# EAGLE schematic 8BIT_ADD_SUB (EAGLE 6.5.0), part 1 of 2

## Sheet 1 of 25
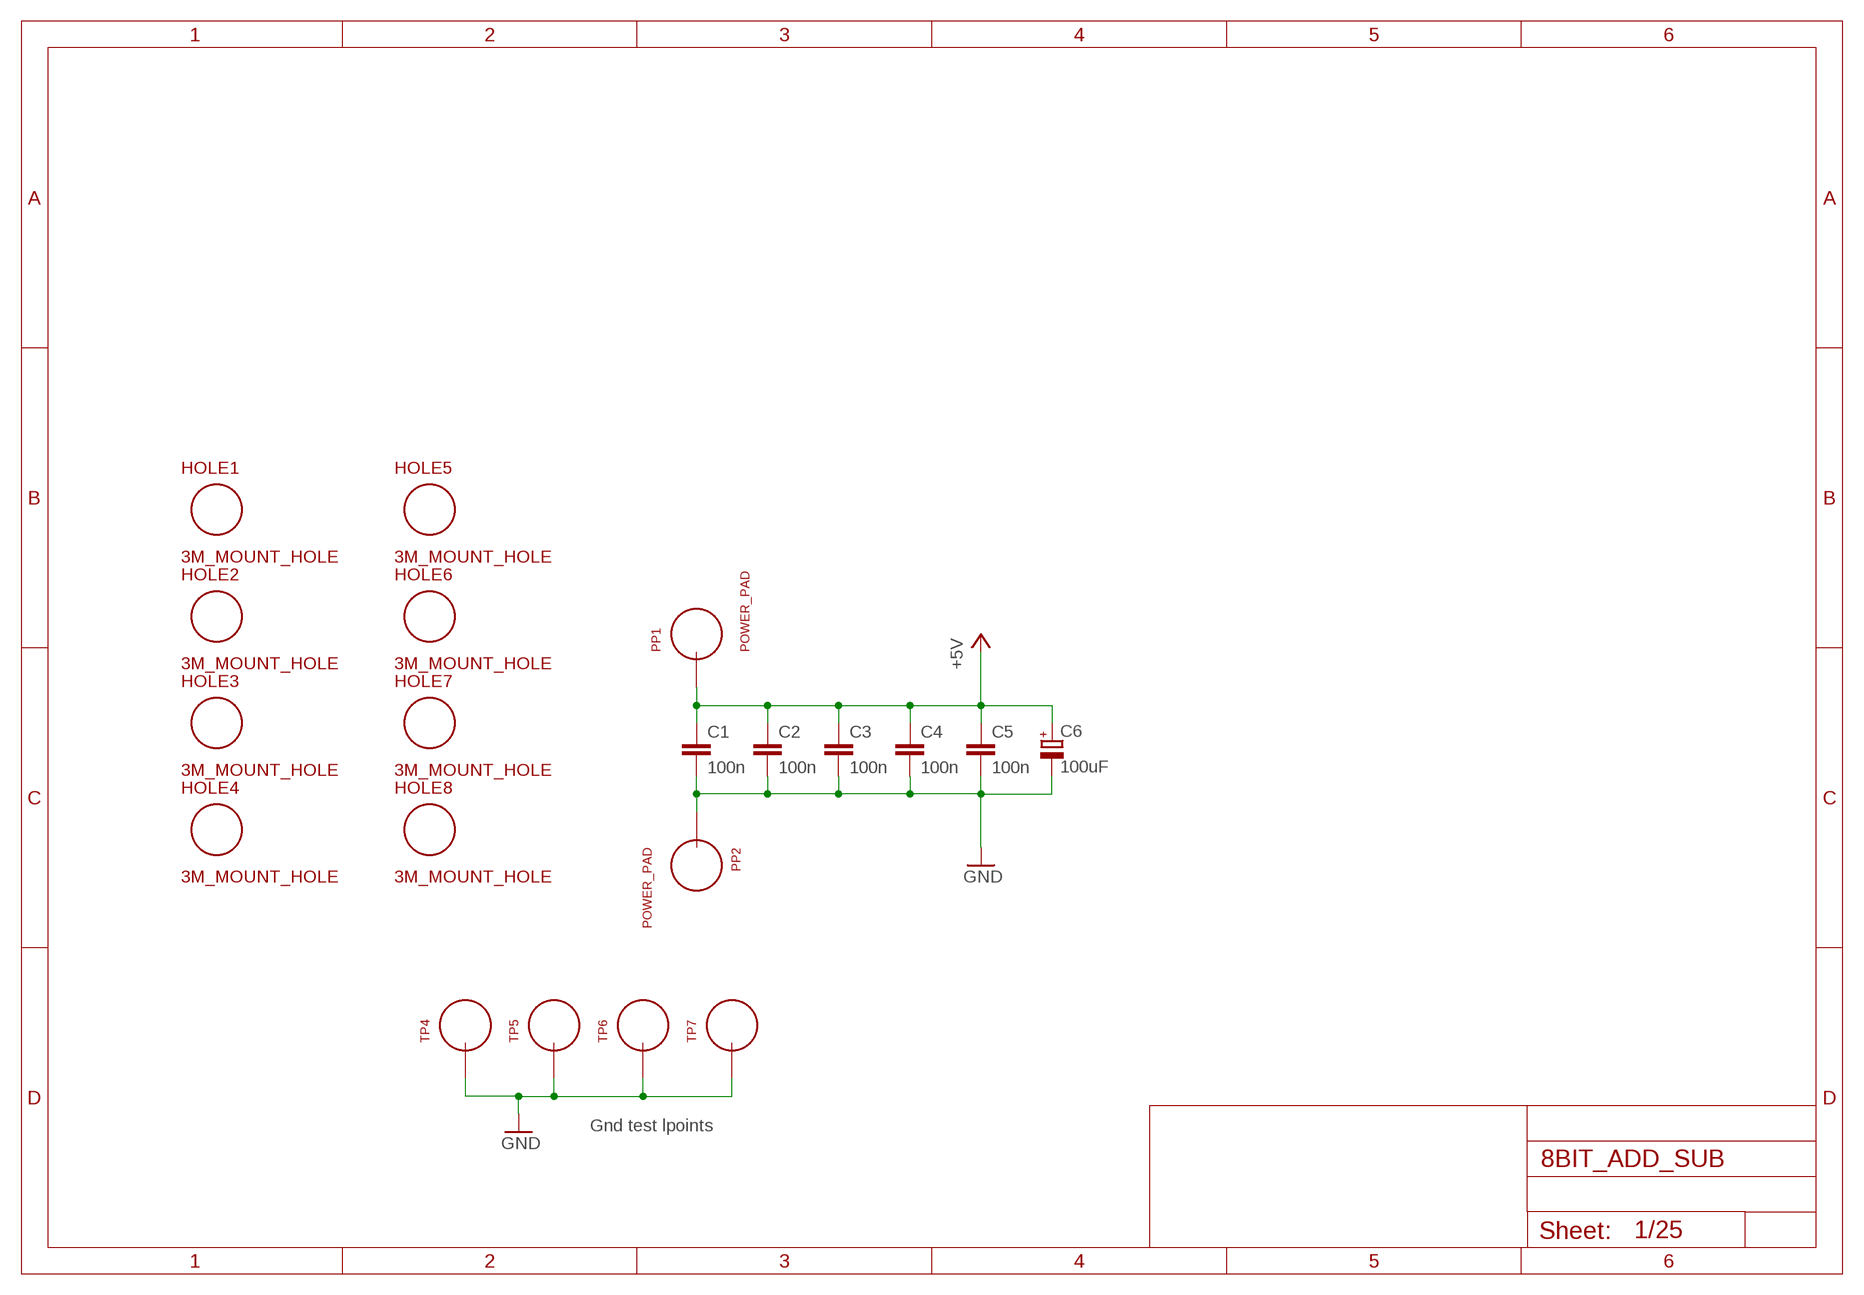
[diagram p0: schematic, sheet 1]

### Parts
C1  100n  C_P2INCH  [CAP_P2INCH]
C2  100n  C_P2INCH  [CAP_P2INCH]
C3  100n  C_P2INCH  [CAP_P2INCH]
C4  100n  C_P2INCH  [CAP_P2INCH]
C5  100n  C_P2INCH  [CAP_P2INCH]
C6  100uF  POLARISED_CAP_2P5  [POLARISED_CAP_2P5]
HOLE1  3M_MOUNT_HOLE  [3M_HOLE]
HOLE2  3M_MOUNT_HOLE  [3M_HOLE]
HOLE3  3M_MOUNT_HOLE  [3M_HOLE]
HOLE4  3M_MOUNT_HOLE  [3M_HOLE]
HOLE5  3M_MOUNT_HOLE  [3M_HOLE]
HOLE6  3M_MOUNT_HOLE  [3M_HOLE]
HOLE7  3M_MOUNT_HOLE  [3M_HOLE]
HOLE8  3M_MOUNT_HOLE  [3M_HOLE]
PP1  POWER_PAD  [POWER_PAD]
PP2  POWER_PAD  [POWER_PAD]
TP4  TEST_LOOP  [TEST_LOOP]
TP5  TEST_LOOP  [TEST_LOOP]
TP6  TEST_LOOP  [TEST_LOOP]
TP7  TEST_LOOP  [TEST_LOOP]

### Nets
+5V: C1.1 C2.1 C3.1 C4.1 C5.1 C6.A PP1.1 ; also sheet 3,4,5,6,7,8,9,10,11,12,13,14,15,16,17,18,19,20,21,22,23,24
GND: C1.2 C2.2 C3.2 C4.2 C5.2 C6.K PP2.1 TP4.P$1 TP5.P$1 TP6.P$1 TP7.P$1 ; also sheet 2,3,4,5,6,7,8,9,10,11,12,13,14,15,16,17,18,19,20,21,22,23,24,25

### Notes on the sheet
- Gnd test lpoints

## Sheet 2 of 25
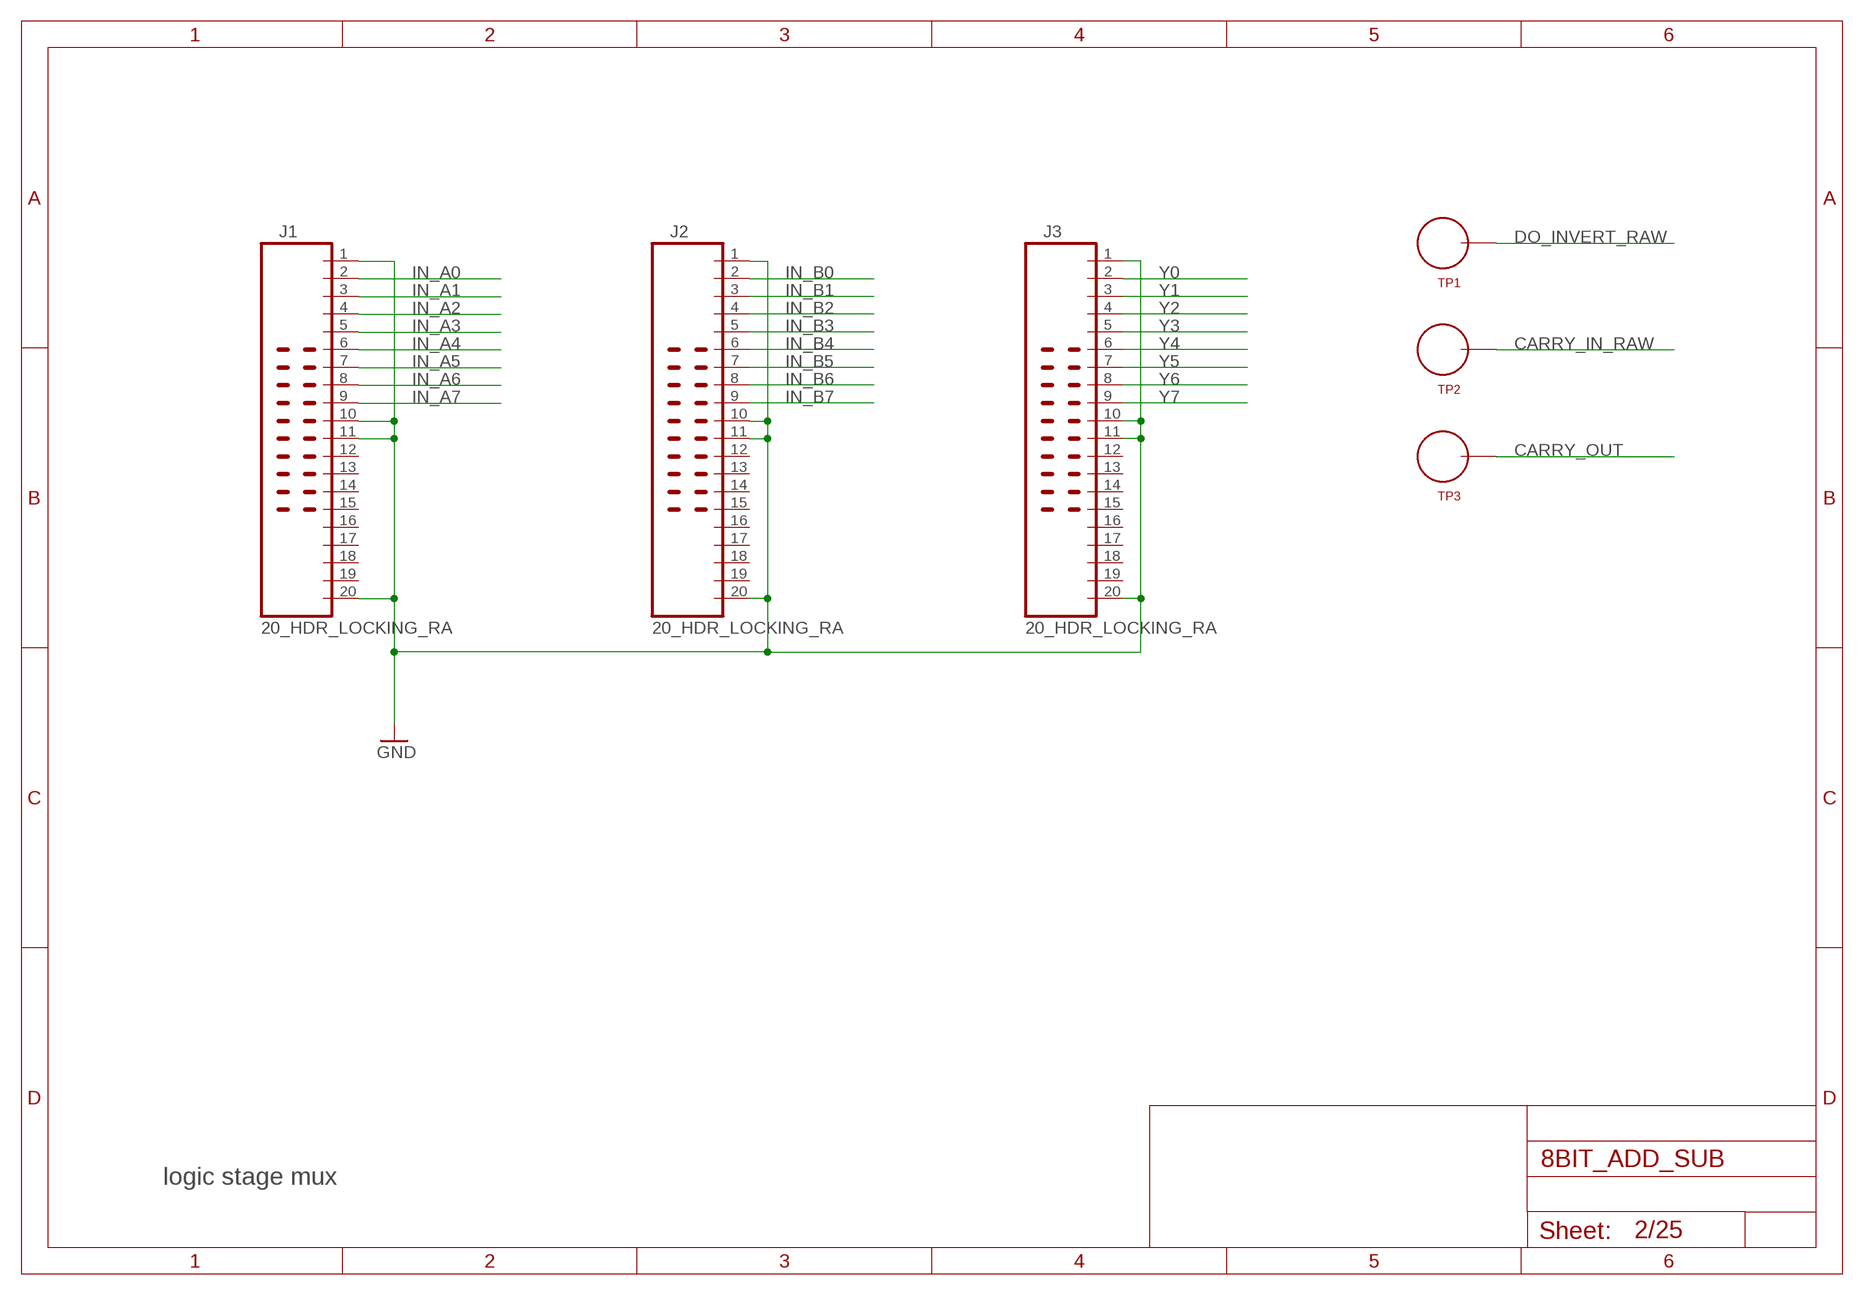
[diagram p1: schematic, sheet 2]

### Parts
J1  20_HDR_LOCKING_RA  [20_HDR_LOCKING_RA]
J2  20_HDR_LOCKING_RA  [20_HDR_LOCKING_RA]
J3  20_HDR_LOCKING_RA  [20_HDR_LOCKING_RA]
TP1  TEST_LOOP  [TEST_LOOP]
TP2  TEST_LOOP  [TEST_LOOP]
TP3  TEST_LOOP  [TEST_LOOP]

### Nets
CARRY_IN_RAW: TP2.P$1 ; also sheet 24
CARRY_OUT: TP3.P$1 ; also sheet 23,24
DO_INVERT_RAW: TP1.P$1 ; also sheet 24
GND: J1.1 J1.10 J1.11 J1.20 J2.1 J2.10 J2.11 J2.20 J3.1 J3.10 J3.11 J3.20 ; also sheet 1,3,4,5,6,7,8,9,10,11,12,13,14,15,16,17,18,19,20,21,22,23,24,25
IN_A0: J1.2 ; also sheet 3,8,9,25
IN_A1: J1.3 ; also sheet 3,10,11,25
IN_A2: J1.4 ; also sheet 3,12,13,25
IN_A3: J1.5 ; also sheet 3,14,15,25
IN_A4: J1.6 ; also sheet 3,16,17,25
IN_A5: J1.7 ; also sheet 3,18,19,25
IN_A6: J1.8 ; also sheet 3,20,21,25
IN_A7: J1.9 ; also sheet 3,22,23,25
IN_B0: J2.2 ; also sheet 3,4,25
IN_B1: J2.3 ; also sheet 3,4,25
IN_B2: J2.4 ; also sheet 3,5,25
IN_B3: J2.5 ; also sheet 3,5,25
IN_B4: J2.6 ; also sheet 3,6,25
IN_B5: J2.7 ; also sheet 3,6,25
IN_B6: J2.8 ; also sheet 3,7,25
IN_B7: J2.9 ; also sheet 3,7,25
Y0: J3.2 ; also sheet 8,25
Y1: J3.3 ; also sheet 10,25
Y2: J3.4 ; also sheet 12,25
Y3: J3.5 ; also sheet 14,25
Y4: J3.6 ; also sheet 16,25
Y5: J3.7 ; also sheet 18,25
Y6: J3.8 ; also sheet 20,25
Y7: J3.9 ; also sheet 22,25
Unconnected: J1.12 J1.13 J1.14 J1.15 J1.16 J1.17 J1.18 J1.19 J2.12 J2.13 J2.14 J2.15 J2.16 J2.17 J2.18 J2.19 J3.12 J3.13 J3.14 J3.15 J3.16 J3.17 J3.18 J3.19

### Notes on the sheet
- logic stage mux

## Sheet 3 of 25
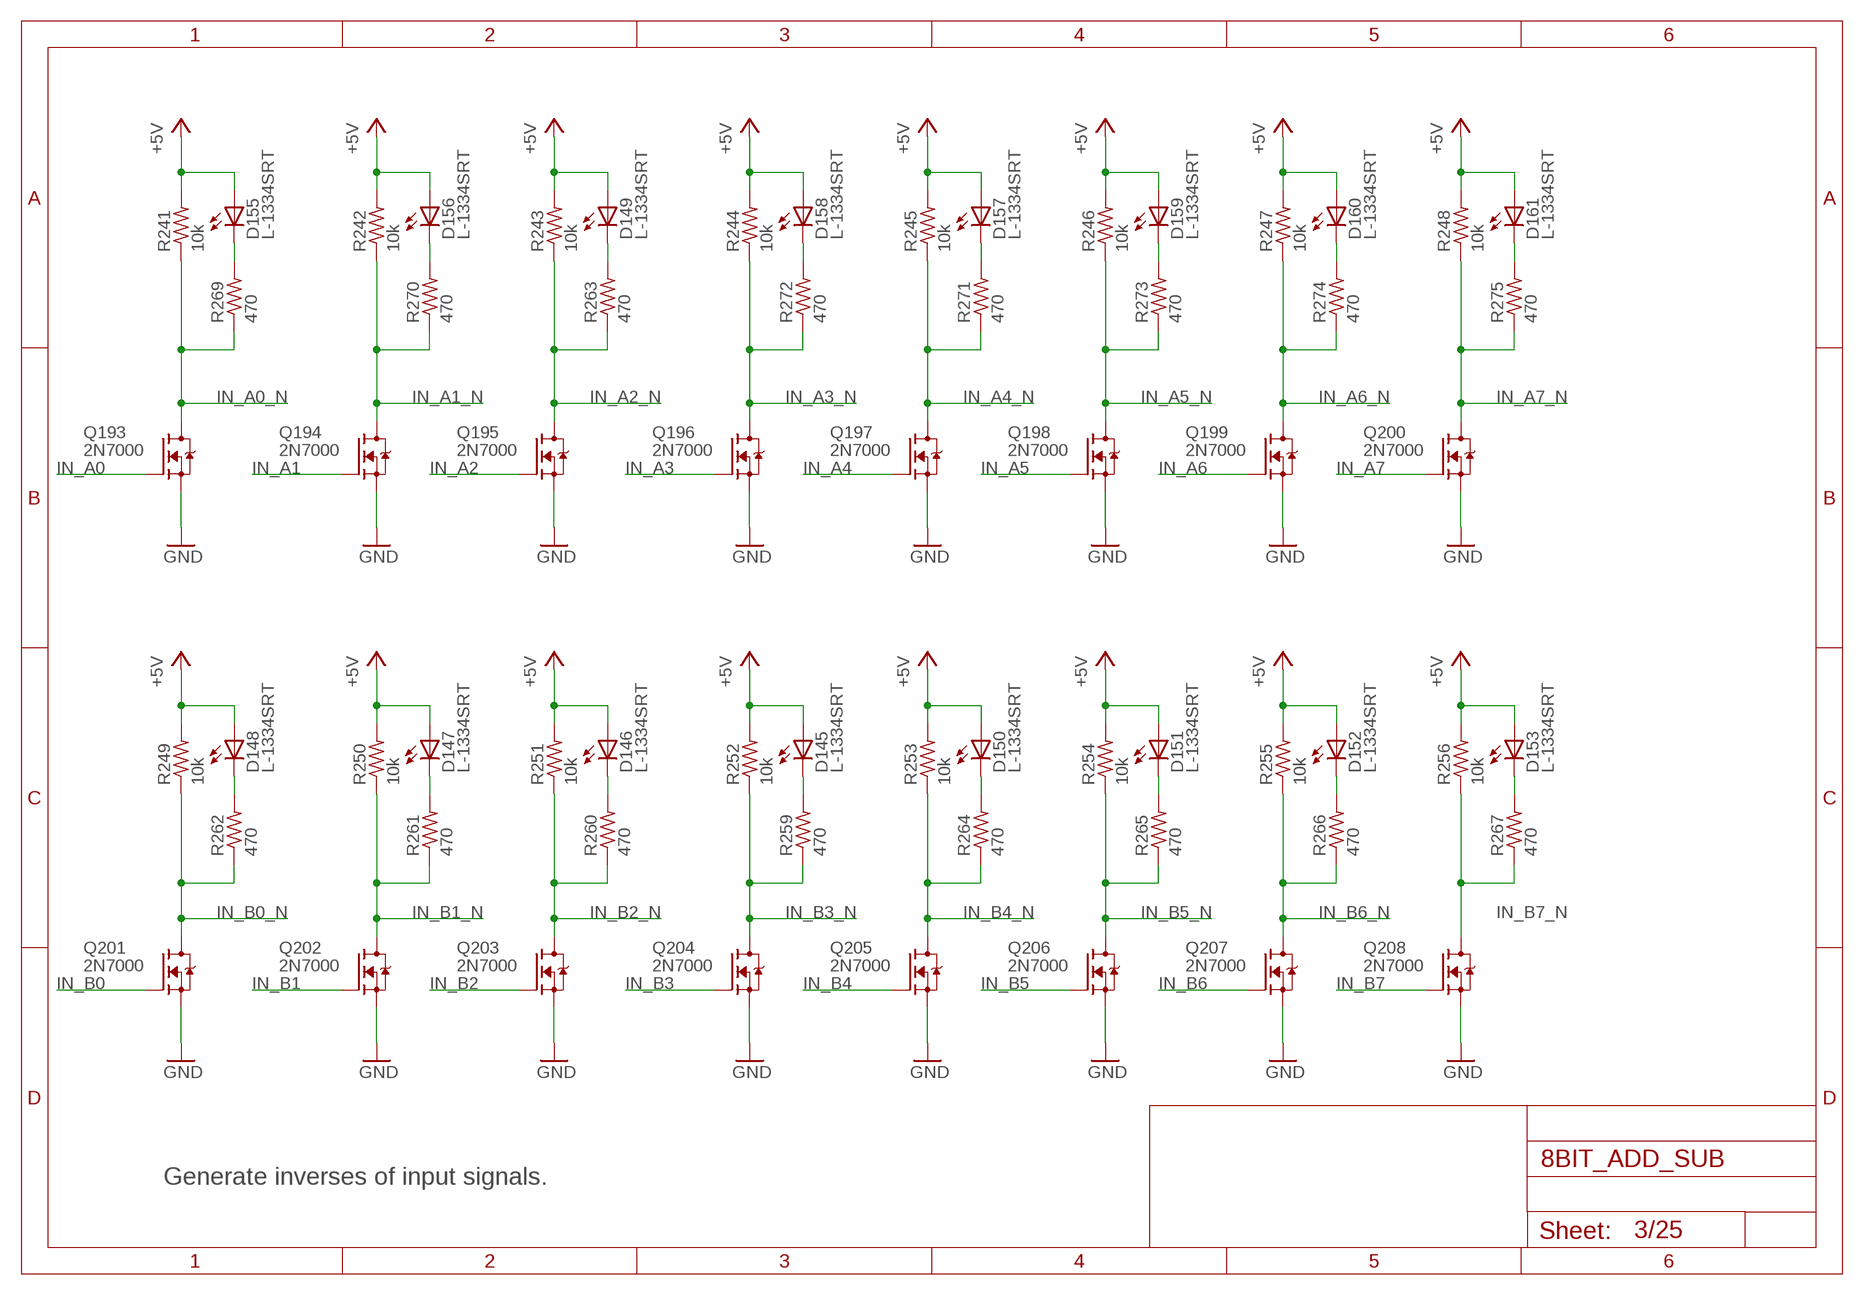
[diagram p2: schematic, sheet 3]

### Parts
D145  L-1334SRT  [LED3MM]
D146  L-1334SRT  [LED3MM]
D147  L-1334SRT  [LED3MM]
D148  L-1334SRT  [LED3MM]
D149  L-1334SRT  [LED3MM]
D150  L-1334SRT  [LED3MM]
D151  L-1334SRT  [LED3MM]
D152  L-1334SRT  [LED3MM]
D153  L-1334SRT  [LED3MM]
D155  L-1334SRT  [LED3MM]
D156  L-1334SRT  [LED3MM]
D157  L-1334SRT  [LED3MM]
D158  L-1334SRT  [LED3MM]
D159  L-1334SRT  [LED3MM]
D160  L-1334SRT  [LED3MM]
D161  L-1334SRT  [LED3MM]
Q193  2N7000  [TO92-DGS]
Q194  2N7000  [TO92-DGS]
Q195  2N7000  [TO92-DGS]
Q196  2N7000  [TO92-DGS]
Q197  2N7000  [TO92-DGS]
Q198  2N7000  [TO92-DGS]
Q199  2N7000  [TO92-DGS]
Q200  2N7000  [TO92-DGS]
Q201  2N7000  [TO92-DGS]
Q202  2N7000  [TO92-DGS]
Q203  2N7000  [TO92-DGS]
Q204  2N7000  [TO92-DGS]
Q205  2N7000  [TO92-DGS]
Q206  2N7000  [TO92-DGS]
Q207  2N7000  [TO92-DGS]
Q208  2N7000  [TO92-DGS]
R241  10k  R_P2INCH  [R_P2INCH]
R242  10k  R_P2INCH  [R_P2INCH]
R243  10k  R_P2INCH  [R_P2INCH]
R244  10k  R_P2INCH  [R_P2INCH]
R245  10k  R_P2INCH  [R_P2INCH]
R246  10k  R_P2INCH  [R_P2INCH]
R247  10k  R_P2INCH  [R_P2INCH]
R248  10k  R_P2INCH  [R_P2INCH]
R249  10k  R_P2INCH  [R_P2INCH]
R250  10k  R_P2INCH  [R_P2INCH]
R251  10k  R_P2INCH  [R_P2INCH]
R252  10k  R_P2INCH  [R_P2INCH]
R253  10k  R_P2INCH  [R_P2INCH]
R254  10k  R_P2INCH  [R_P2INCH]
R255  10k  R_P2INCH  [R_P2INCH]
R256  10k  R_P2INCH  [R_P2INCH]
R259  470  R_P2INCH  [R_P2INCH]
R260  470  R_P2INCH  [R_P2INCH]
R261  470  R_P2INCH  [R_P2INCH]
R262  470  R_P2INCH  [R_P2INCH]
R263  470  R_P2INCH  [R_P2INCH]
R264  470  R_P2INCH  [R_P2INCH]
R265  470  R_P2INCH  [R_P2INCH]
R266  470  R_P2INCH  [R_P2INCH]
R267  470  R_P2INCH  [R_P2INCH]
R269  470  R_P2INCH  [R_P2INCH]
R270  470  R_P2INCH  [R_P2INCH]
R271  470  R_P2INCH  [R_P2INCH]
R272  470  R_P2INCH  [R_P2INCH]
R273  470  R_P2INCH  [R_P2INCH]
R274  470  R_P2INCH  [R_P2INCH]
R275  470  R_P2INCH  [R_P2INCH]

### Nets
+5V: D145.A D146.A D147.A D148.A D149.A D150.A D151.A D152.A D153.A D155.A D156.A D157.A D158.A D159.A D160.A D161.A R241.2 R242.2 R243.2 R244.2 R245.2 R246.2 R247.2 R248.2 R249.2 R250.2 R251.2 R252.2 R253.2 R254.2 R255.2 R256.2 ; also sheet 1,4,5,6,7,8,9,10,11,12,13,14,15,16,17,18,19,20,21,22,23,24
GND: Q193.S Q194.S Q195.S Q196.S Q197.S Q198.S Q199.S Q200.S Q201.S Q202.S Q203.S Q204.S Q205.S Q206.S Q207.S Q208.S ; also sheet 1,2,4,5,6,7,8,9,10,11,12,13,14,15,16,17,18,19,20,21,22,23,24,25
IN_A0: Q193.G ; also sheet 2,8,9,25
IN_A0_N: Q193.D R241.1 R269.1 ; also sheet 8,9
IN_A1: Q194.G ; also sheet 2,10,11,25
IN_A1_N: Q194.D R242.1 R270.1 ; also sheet 10,11
IN_A2: Q195.G ; also sheet 2,12,13,25
IN_A2_N: Q195.D R243.1 R263.1 ; also sheet 12,13
IN_A3: Q196.G ; also sheet 2,14,15,25
IN_A3_N: Q196.D R244.1 R272.1 ; also sheet 14,15
IN_A4: Q197.G ; also sheet 2,16,17,25
IN_A4_N: Q197.D R245.1 R271.1 ; also sheet 16,17
IN_A5: Q198.G ; also sheet 2,18,19,25
IN_A5_N: Q198.D R246.1 R273.1 ; also sheet 18,19
IN_A6: Q199.G ; also sheet 2,20,21,25
IN_A6_N: Q199.D R247.1 R274.1 ; also sheet 20,21
IN_A7: Q200.G ; also sheet 2,22,23,25
IN_A7_N: Q200.D R248.1 R275.1 ; also sheet 22,23
IN_B0: Q201.G ; also sheet 2,4,25
IN_B0_N: Q201.D R249.1 R262.1 ; also sheet 4
IN_B1: Q202.G ; also sheet 2,4,25
IN_B1_N: Q202.D R250.1 R261.1 ; also sheet 4
IN_B2: Q203.G ; also sheet 2,5,25
IN_B2_N: Q203.D R251.1 R260.1 ; also sheet 5
IN_B3: Q204.G ; also sheet 2,5,25
IN_B3_N: Q204.D R252.1 R259.1 ; also sheet 5
IN_B4: Q205.G ; also sheet 2,6,25
IN_B4_N: Q205.D R253.1 R264.1 ; also sheet 6
IN_B5: Q206.G ; also sheet 2,6,25
IN_B5_N: Q206.D R254.1 R265.1 ; also sheet 6
IN_B6: Q207.G ; also sheet 2,7,25
IN_B6_N: Q207.D R255.1 R266.1 ; also sheet 7
IN_B7: Q208.G ; also sheet 2,7,25
IN_B7_N: Q208.D R256.1 R267.1 ; also sheet 7
N$240: D145.K(C) R259.2
N$241: D146.K(C) R260.2
N$242: D147.K(C) R261.2
N$243: D148.K(C) R262.2
N$244: D149.K(C) R263.2
N$245: D150.K(C) R264.2
N$246: D151.K(C) R265.2
N$247: D152.K(C) R266.2
N$248: D153.K(C) R267.2
N$250: D155.K(C) R269.2
N$251: D156.K(C) R270.2
N$252: D157.K(C) R271.2
N$253: D158.K(C) R272.2
N$254: D159.K(C) R273.2
N$255: D160.K(C) R274.2
N$256: D161.K(C) R275.2

### Notes on the sheet
- Generate inverses of input signals.

## Sheet 4 of 25
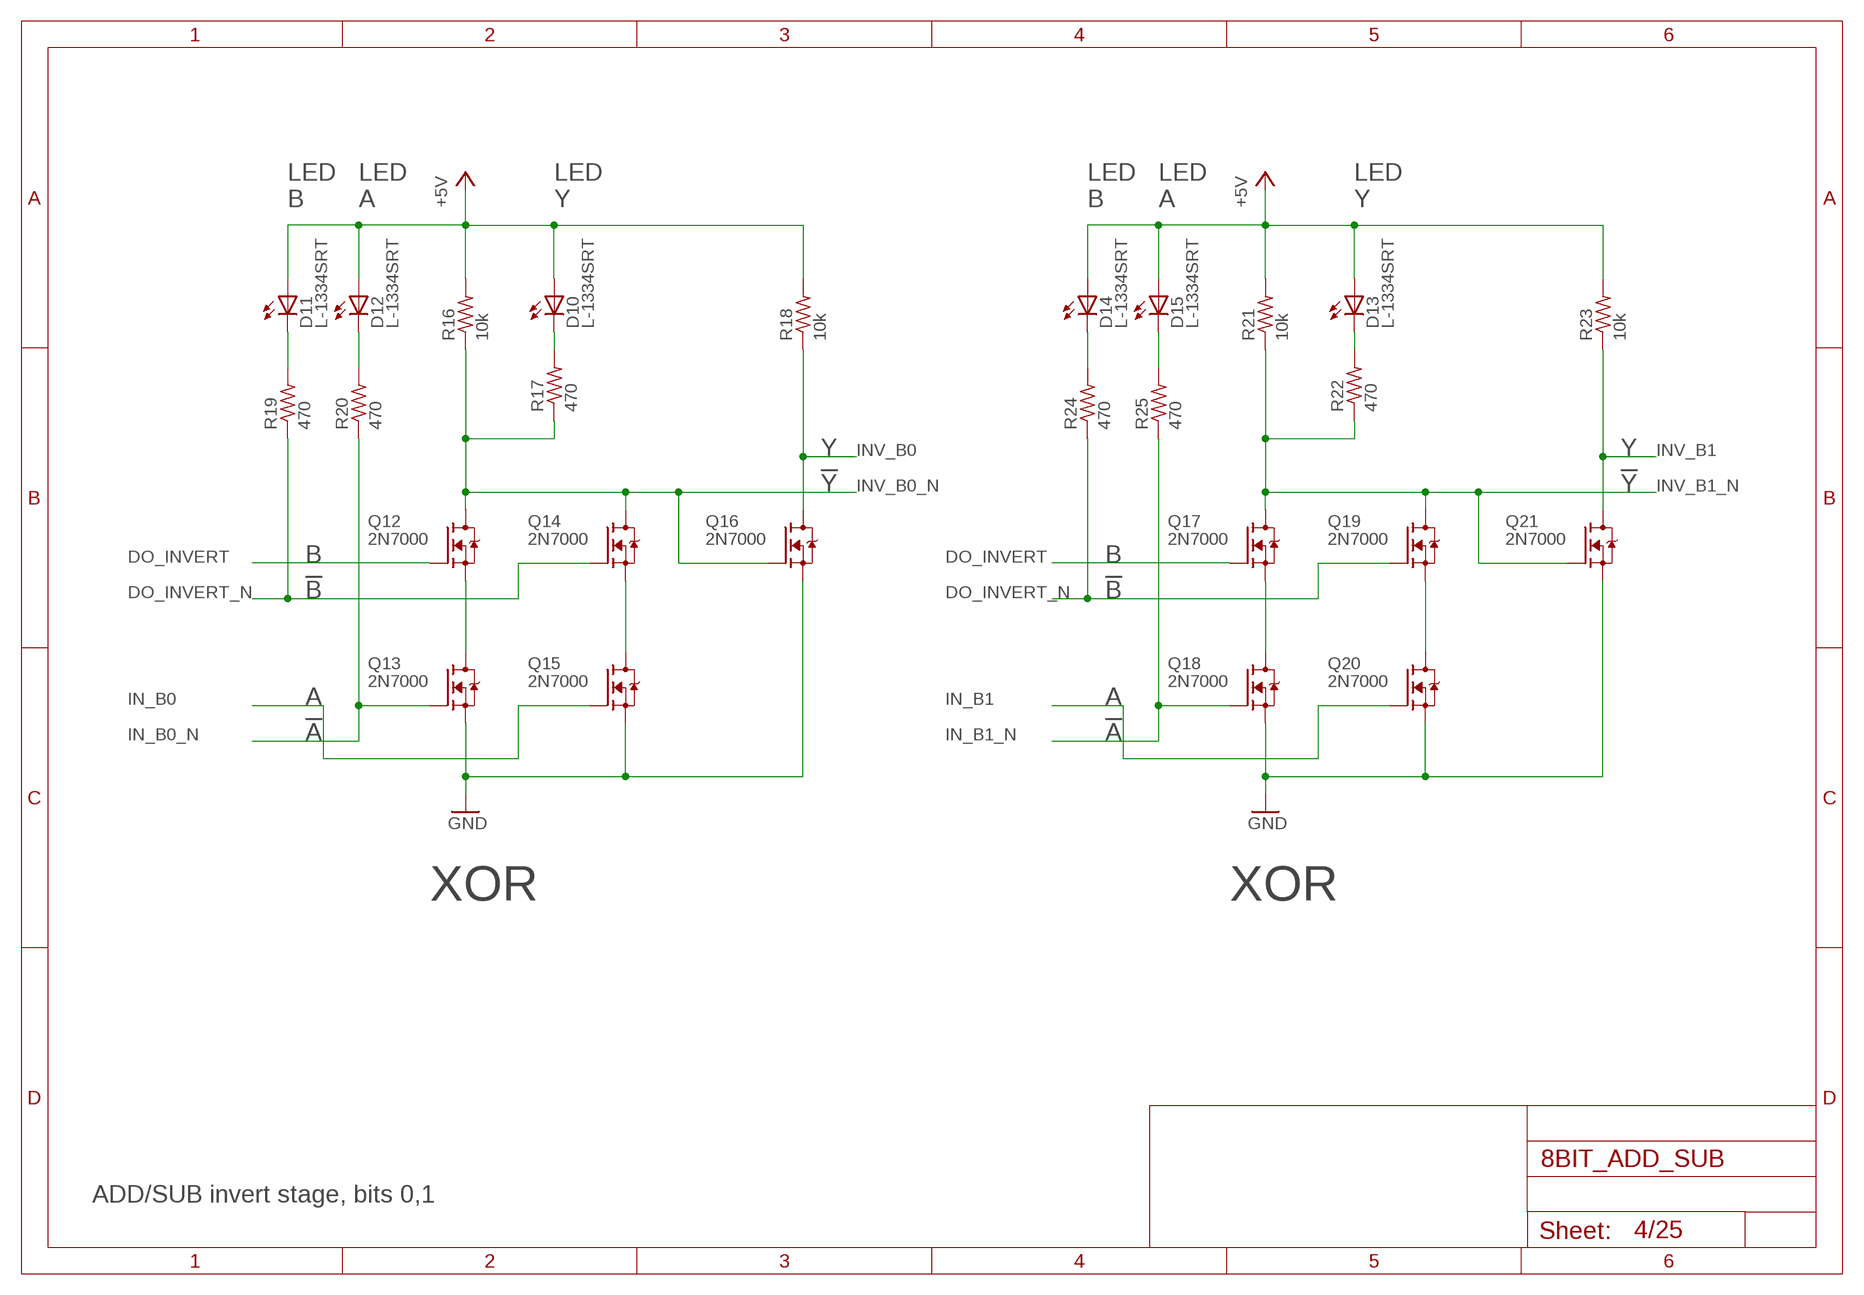
[diagram p3: schematic, sheet 4]

### Parts
D10  L-1334SRT  [LED3MM]
D11  L-1334SRT  [LED3MM]
D12  L-1334SRT  [LED3MM]
D13  L-1334SRT  [LED3MM]
D14  L-1334SRT  [LED3MM]
D15  L-1334SRT  [LED3MM]
Q12  2N7000  [TO92-DGS]
Q13  2N7000  [TO92-DGS]
Q14  2N7000  [TO92-DGS]
Q15  2N7000  [TO92-DGS]
Q16  2N7000  [TO92-DGS]
Q17  2N7000  [TO92-DGS]
Q18  2N7000  [TO92-DGS]
Q19  2N7000  [TO92-DGS]
Q20  2N7000  [TO92-DGS]
Q21  2N7000  [TO92-DGS]
R16  10k  R_P2INCH  [R_P2INCH]
R17  470  R_P2INCH  [R_P2INCH]
R18  10k  R_P2INCH  [R_P2INCH]
R19  470  R_P2INCH  [R_P2INCH]
R20  470  R_P2INCH  [R_P2INCH]
R21  10k  R_P2INCH  [R_P2INCH]
R22  470  R_P2INCH  [R_P2INCH]
R23  10k  R_P2INCH  [R_P2INCH]
R24  470  R_P2INCH  [R_P2INCH]
R25  470  R_P2INCH  [R_P2INCH]

### Nets
+5V: D10.A D11.A D12.A D13.A D14.A D15.A R16.2 R18.2 R21.2 R23.2 ; also sheet 1,3,5,6,7,8,9,10,11,12,13,14,15,16,17,18,19,20,21,22,23,24
DO_INVERT: Q12.G Q17.G ; also sheet 5,6,7,24
DO_INVERT_N: Q14.G Q19.G R19.1 R24.1 ; also sheet 5,6,7,24
GND: Q13.S Q15.S Q16.S Q18.S Q20.S Q21.S ; also sheet 1,2,3,5,6,7,8,9,10,11,12,13,14,15,16,17,18,19,20,21,22,23,24,25
IN_B0: Q15.G ; also sheet 2,3,25
IN_B0_N: Q13.G R20.1 ; also sheet 3
IN_B1: Q20.G ; also sheet 2,3,25
IN_B1_N: Q18.G R25.1 ; also sheet 3
INV_B0: Q16.D R18.1 ; also sheet 8,9
INV_B0_N: Q12.D Q14.D Q16.G R16.1 R17.1 ; also sheet 8,9
INV_B1: Q21.D R23.1 ; also sheet 10,11
INV_B1_N: Q17.D Q19.D Q21.G R21.1 R22.1 ; also sheet 10,11
N$16: Q12.S Q13.D
N$32: Q14.S Q15.D
N$36: D10.K(C) R17.2
N$39: D12.K(C) R20.2
N$40: D11.K(C) R19.2
N$42: Q17.S Q18.D
N$43: Q19.S Q20.D
N$47: D13.K(C) R22.2
N$50: D15.K(C) R25.2
N$51: D14.K(C) R24.2

### Notes on the sheet
- LED
  B
- LED
  A
- LED
  Y
- LED
  B
- LED
  A
- LED
  Y
- Y | Y
- !Y | !Y
- B | B
- !B | !B
- A | A
- !A | !A
- XOR | XOR
- ADD/SUB invert stage, bits 0,1

## Sheet 5 of 25
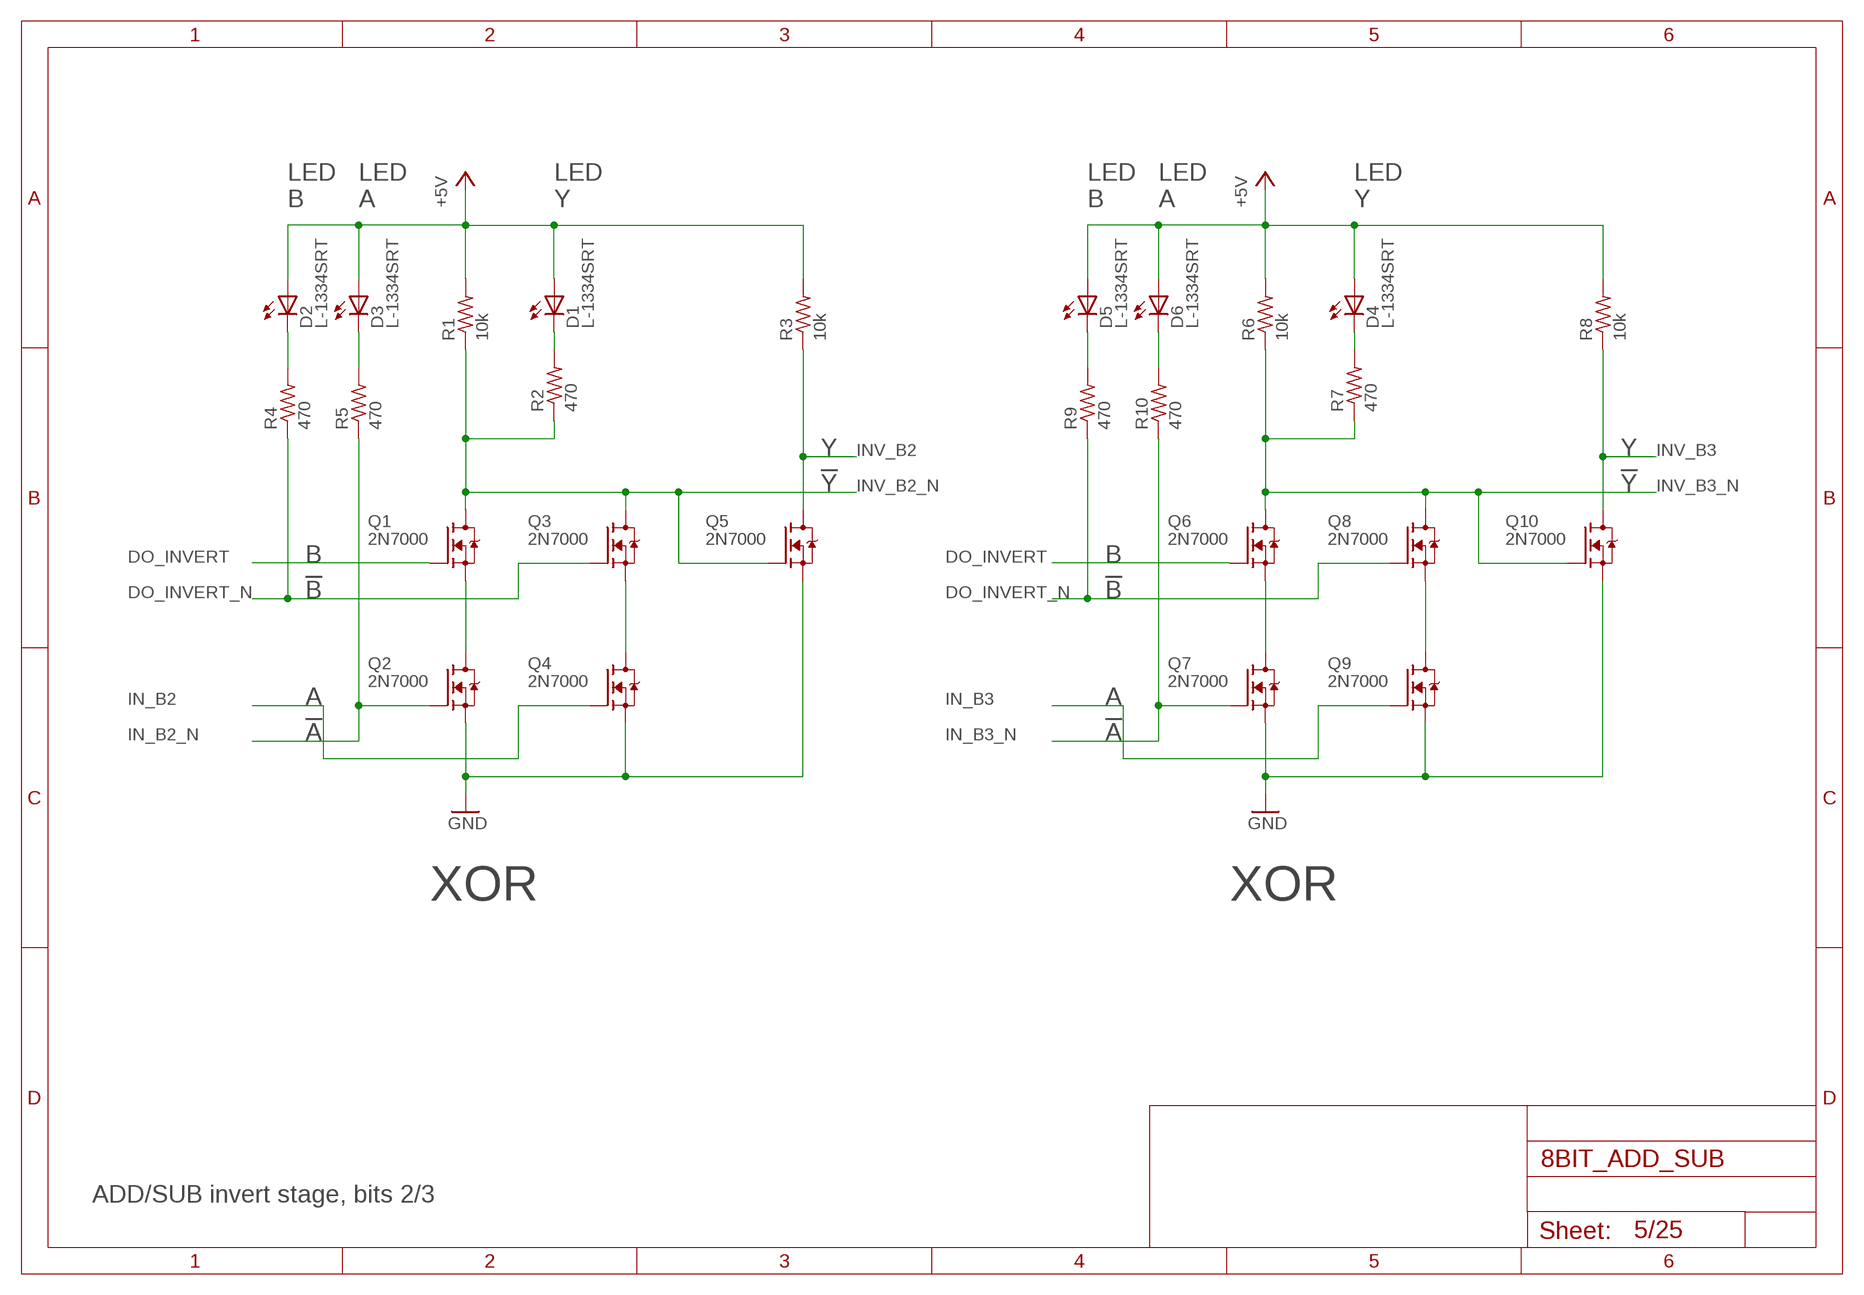
[diagram p4: schematic, sheet 5]

### Parts
D1  L-1334SRT  [LED3MM]
D2  L-1334SRT  [LED3MM]
D3  L-1334SRT  [LED3MM]
D4  L-1334SRT  [LED3MM]
D5  L-1334SRT  [LED3MM]
D6  L-1334SRT  [LED3MM]
Q1  2N7000  [TO92-DGS]
Q2  2N7000  [TO92-DGS]
Q3  2N7000  [TO92-DGS]
Q4  2N7000  [TO92-DGS]
Q5  2N7000  [TO92-DGS]
Q6  2N7000  [TO92-DGS]
Q7  2N7000  [TO92-DGS]
Q8  2N7000  [TO92-DGS]
Q9  2N7000  [TO92-DGS]
Q10  2N7000  [TO92-DGS]
R1  10k  R_P2INCH  [R_P2INCH]
R2  470  R_P2INCH  [R_P2INCH]
R3  10k  R_P2INCH  [R_P2INCH]
R4  470  R_P2INCH  [R_P2INCH]
R5  470  R_P2INCH  [R_P2INCH]
R6  10k  R_P2INCH  [R_P2INCH]
R7  470  R_P2INCH  [R_P2INCH]
R8  10k  R_P2INCH  [R_P2INCH]
R9  470  R_P2INCH  [R_P2INCH]
R10  470  R_P2INCH  [R_P2INCH]

### Nets
+5V: D1.A D2.A D3.A D4.A D5.A D6.A R1.2 R3.2 R6.2 R8.2 ; also sheet 1,3,4,6,7,8,9,10,11,12,13,14,15,16,17,18,19,20,21,22,23,24
DO_INVERT: Q1.G Q6.G ; also sheet 4,6,7,24
DO_INVERT_N: Q3.G Q8.G R4.1 R9.1 ; also sheet 4,6,7,24
GND: Q2.S Q4.S Q5.S Q7.S Q9.S Q10.S ; also sheet 1,2,3,4,6,7,8,9,10,11,12,13,14,15,16,17,18,19,20,21,22,23,24,25
IN_B2: Q4.G ; also sheet 2,3,25
IN_B2_N: Q2.G R5.1 ; also sheet 3
IN_B3: Q9.G ; also sheet 2,3,25
IN_B3_N: Q7.G R10.1 ; also sheet 3
INV_B2: Q5.D R3.1 ; also sheet 12,13
INV_B2_N: Q1.D Q3.D Q5.G R1.1 R2.1 ; also sheet 12,13
INV_B3: Q10.D R8.1 ; also sheet 14,15
INV_B3_N: Q6.D Q8.D Q10.G R6.1 R7.1 ; also sheet 14,15
N$1: Q1.S Q2.D
N$2: Q3.S Q4.D
N$3: D1.K(C) R2.2
N$4: D3.K(C) R5.2
N$5: D2.K(C) R4.2
N$6: Q6.S Q7.D
N$7: Q8.S Q9.D
N$8: D4.K(C) R7.2
N$9: D6.K(C) R10.2
N$10: D5.K(C) R9.2

### Notes on the sheet
- LED
  B
- LED
  A
- LED
  Y
- LED
  B
- LED
  A
- LED
  Y
- Y | Y
- !Y | !Y
- B | B
- !B | !B
- A | A
- !A | !A
- XOR | XOR
- ADD/SUB invert stage, bits 2/3

## Sheet 6 of 25
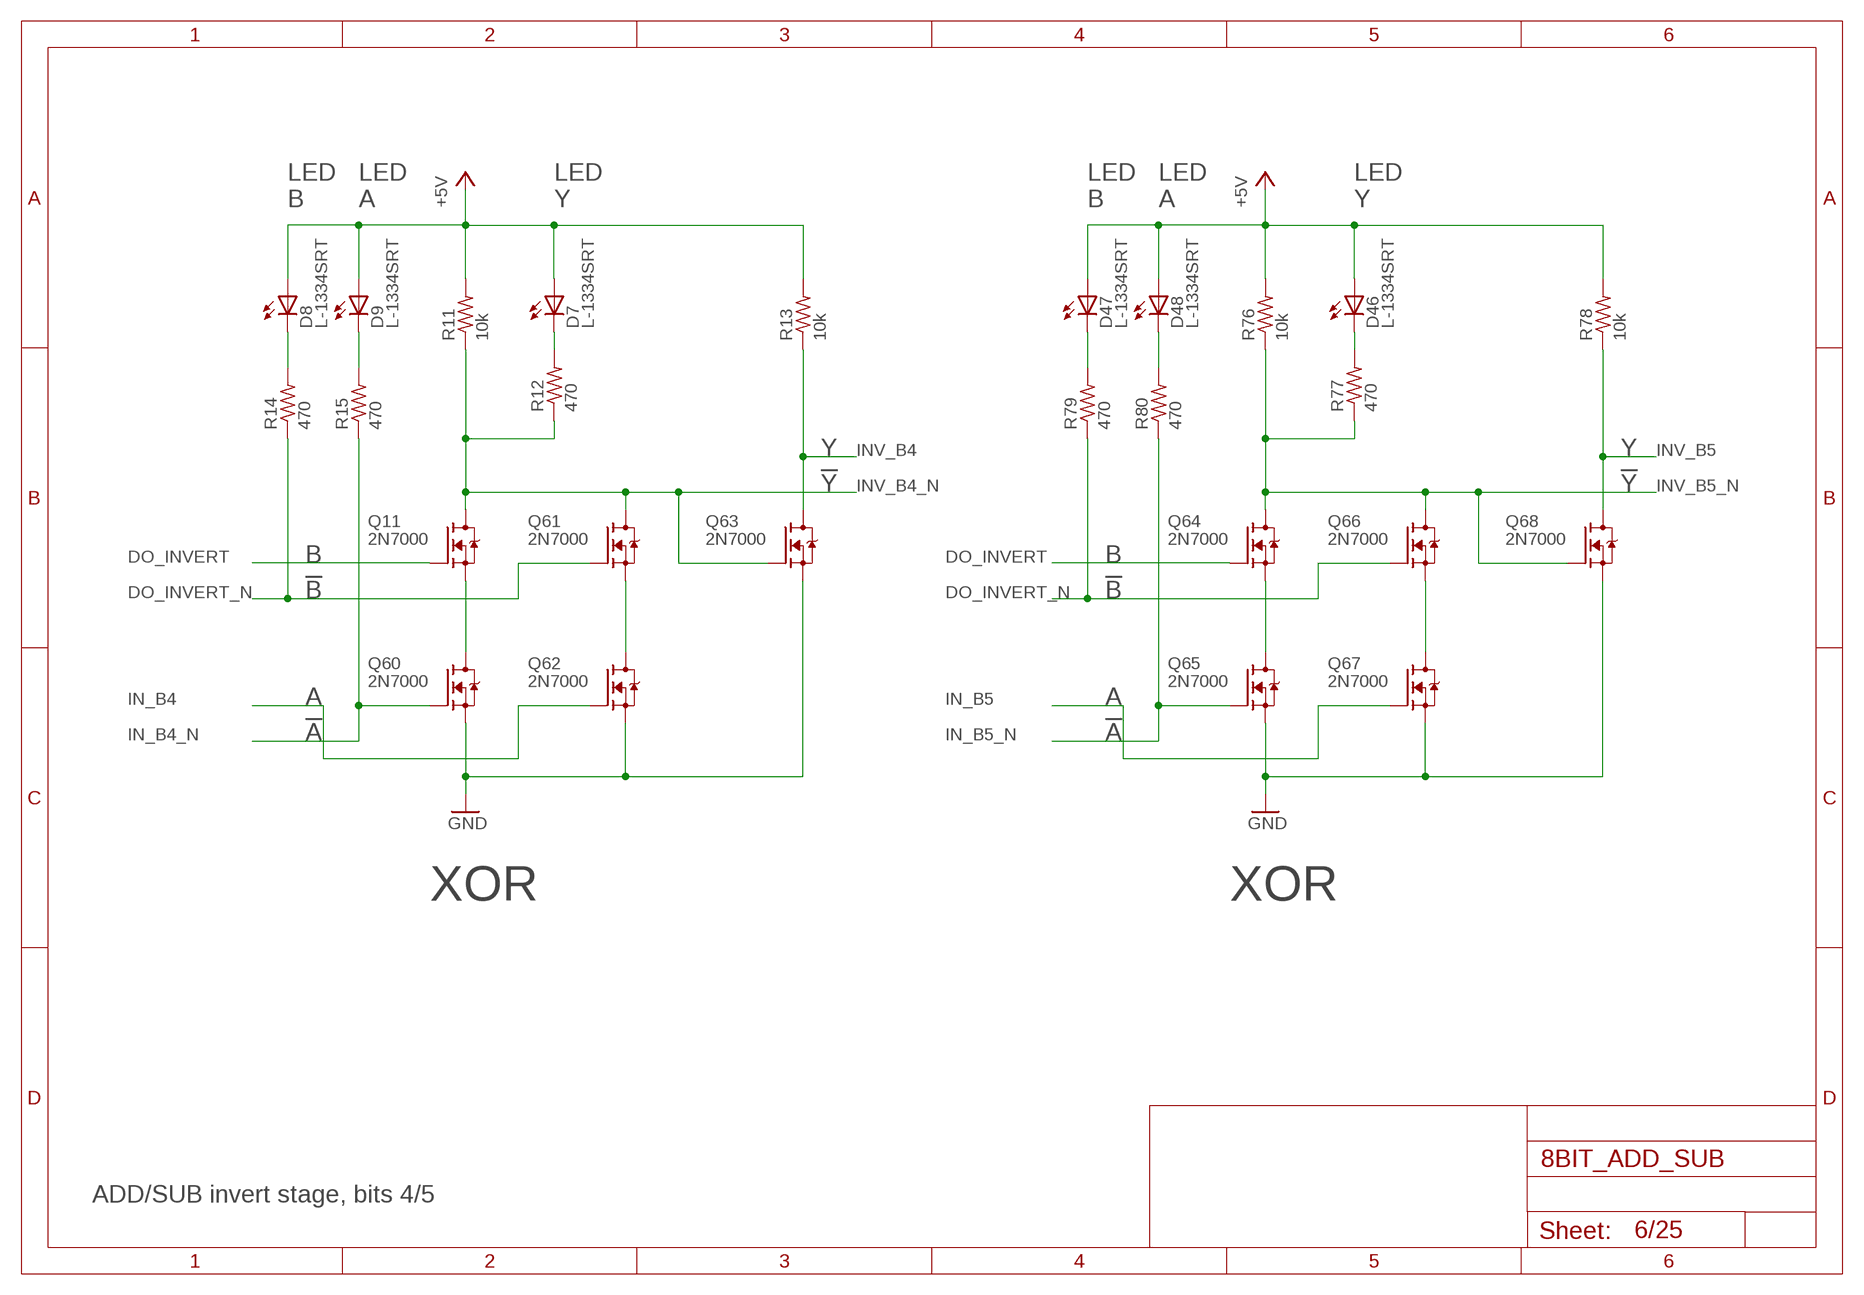
[diagram p5: schematic, sheet 6]

### Parts
D7  L-1334SRT  [LED3MM]
D8  L-1334SRT  [LED3MM]
D9  L-1334SRT  [LED3MM]
D46  L-1334SRT  [LED3MM]
D47  L-1334SRT  [LED3MM]
D48  L-1334SRT  [LED3MM]
Q11  2N7000  [TO92-DGS]
Q60  2N7000  [TO92-DGS]
Q61  2N7000  [TO92-DGS]
Q62  2N7000  [TO92-DGS]
Q63  2N7000  [TO92-DGS]
Q64  2N7000  [TO92-DGS]
Q65  2N7000  [TO92-DGS]
Q66  2N7000  [TO92-DGS]
Q67  2N7000  [TO92-DGS]
Q68  2N7000  [TO92-DGS]
R11  10k  R_P2INCH  [R_P2INCH]
R12  470  R_P2INCH  [R_P2INCH]
R13  10k  R_P2INCH  [R_P2INCH]
R14  470  R_P2INCH  [R_P2INCH]
R15  470  R_P2INCH  [R_P2INCH]
R76  10k  R_P2INCH  [R_P2INCH]
R77  470  R_P2INCH  [R_P2INCH]
R78  10k  R_P2INCH  [R_P2INCH]
R79  470  R_P2INCH  [R_P2INCH]
R80  470  R_P2INCH  [R_P2INCH]

### Nets
+5V: D7.A D8.A D9.A D46.A D47.A D48.A R11.2 R13.2 R76.2 R78.2 ; also sheet 1,3,4,5,7,8,9,10,11,12,13,14,15,16,17,18,19,20,21,22,23,24
DO_INVERT: Q11.G Q64.G ; also sheet 4,5,7,24
DO_INVERT_N: Q61.G Q66.G R14.1 R79.1 ; also sheet 4,5,7,24
GND: Q60.S Q62.S Q63.S Q65.S Q67.S Q68.S ; also sheet 1,2,3,4,5,7,8,9,10,11,12,13,14,15,16,17,18,19,20,21,22,23,24,25
IN_B4: Q62.G ; also sheet 2,3,25
IN_B4_N: Q60.G R15.1 ; also sheet 3
IN_B5: Q67.G ; also sheet 2,3,25
IN_B5_N: Q65.G R80.1 ; also sheet 3
INV_B4: Q63.D R13.1 ; also sheet 16,17
INV_B4_N: Q11.D Q61.D Q63.G R11.1 R12.1 ; also sheet 16,17
INV_B5: Q68.D R78.1 ; also sheet 18,19
INV_B5_N: Q64.D Q66.D Q68.G R76.1 R77.1 ; also sheet 18,19
N$11: Q11.S Q60.D
N$12: Q61.S Q62.D
N$13: D7.K(C) R12.2
N$14: D9.K(C) R15.2
N$15: D8.K(C) R14.2
N$17: Q64.S Q65.D
N$18: Q66.S Q67.D
N$19: D46.K(C) R77.2
N$20: D48.K(C) R80.2
N$21: D47.K(C) R79.2

### Notes on the sheet
- LED
  B
- LED
  A
- LED
  Y
- LED
  B
- LED
  A
- LED
  Y
- Y | Y
- !Y | !Y
- B | B
- !B | !B
- A | A
- !A | !A
- XOR | XOR
- ADD/SUB invert stage, bits 4/5

## Sheet 7 of 25
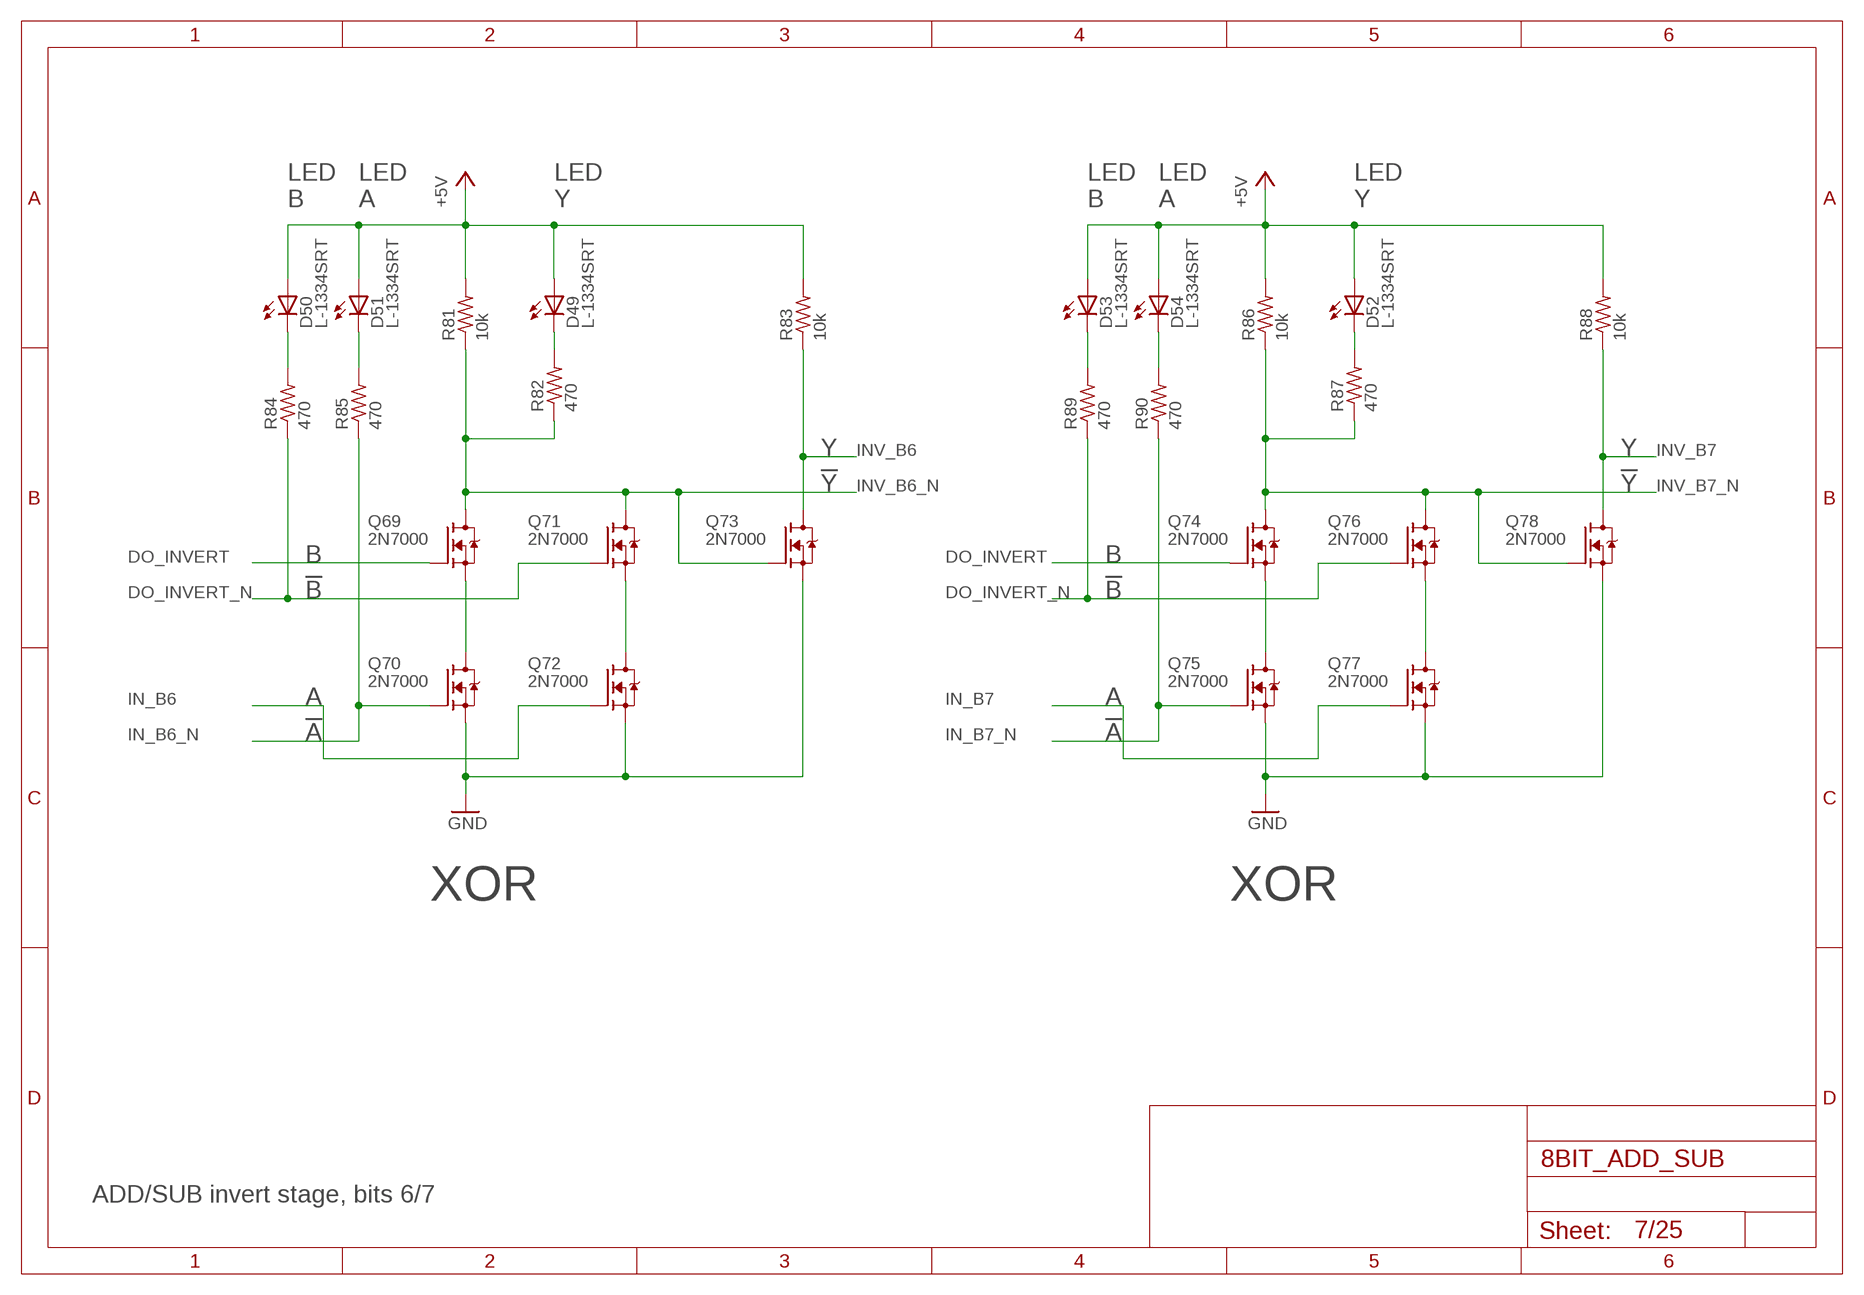
[diagram p6: schematic, sheet 7]

### Parts
D49  L-1334SRT  [LED3MM]
D50  L-1334SRT  [LED3MM]
D51  L-1334SRT  [LED3MM]
D52  L-1334SRT  [LED3MM]
D53  L-1334SRT  [LED3MM]
D54  L-1334SRT  [LED3MM]
Q69  2N7000  [TO92-DGS]
Q70  2N7000  [TO92-DGS]
Q71  2N7000  [TO92-DGS]
Q72  2N7000  [TO92-DGS]
Q73  2N7000  [TO92-DGS]
Q74  2N7000  [TO92-DGS]
Q75  2N7000  [TO92-DGS]
Q76  2N7000  [TO92-DGS]
Q77  2N7000  [TO92-DGS]
Q78  2N7000  [TO92-DGS]
R81  10k  R_P2INCH  [R_P2INCH]
R82  470  R_P2INCH  [R_P2INCH]
R83  10k  R_P2INCH  [R_P2INCH]
R84  470  R_P2INCH  [R_P2INCH]
R85  470  R_P2INCH  [R_P2INCH]
R86  10k  R_P2INCH  [R_P2INCH]
R87  470  R_P2INCH  [R_P2INCH]
R88  10k  R_P2INCH  [R_P2INCH]
R89  470  R_P2INCH  [R_P2INCH]
R90  470  R_P2INCH  [R_P2INCH]

### Nets
+5V: D49.A D50.A D51.A D52.A D53.A D54.A R81.2 R83.2 R86.2 R88.2 ; also sheet 1,3,4,5,6,8,9,10,11,12,13,14,15,16,17,18,19,20,21,22,23,24
DO_INVERT: Q69.G Q74.G ; also sheet 4,5,6,24
DO_INVERT_N: Q71.G Q76.G R84.1 R89.1 ; also sheet 4,5,6,24
GND: Q70.S Q72.S Q73.S Q75.S Q77.S Q78.S ; also sheet 1,2,3,4,5,6,8,9,10,11,12,13,14,15,16,17,18,19,20,21,22,23,24,25
IN_B6: Q72.G ; also sheet 2,3,25
IN_B6_N: Q70.G R85.1 ; also sheet 3
IN_B7: Q77.G ; also sheet 2,3,25
IN_B7_N: Q75.G R90.1 ; also sheet 3
INV_B6: Q73.D R83.1 ; also sheet 20,21
INV_B6_N: Q69.D Q71.D Q73.G R81.1 R82.1 ; also sheet 20,21
INV_B7: Q78.D R88.1 ; also sheet 22,23
INV_B7_N: Q74.D Q76.D Q78.G R86.1 R87.1 ; also sheet 22,23
N$22: Q69.S Q70.D
N$23: Q71.S Q72.D
N$24: D49.K(C) R82.2
N$25: D51.K(C) R85.2
N$26: D50.K(C) R84.2
N$27: Q74.S Q75.D
N$28: Q76.S Q77.D
N$29: D52.K(C) R87.2
N$30: D54.K(C) R90.2
N$31: D53.K(C) R89.2

### Notes on the sheet
- LED
  B
- LED
  A
- LED
  Y
- LED
  B
- LED
  A
- LED
  Y
- Y | Y
- !Y | !Y
- B | B
- !B | !B
- A | A
- !A | !A
- XOR | XOR
- ADD/SUB invert stage, bits 6/7

## Sheet 8 of 25
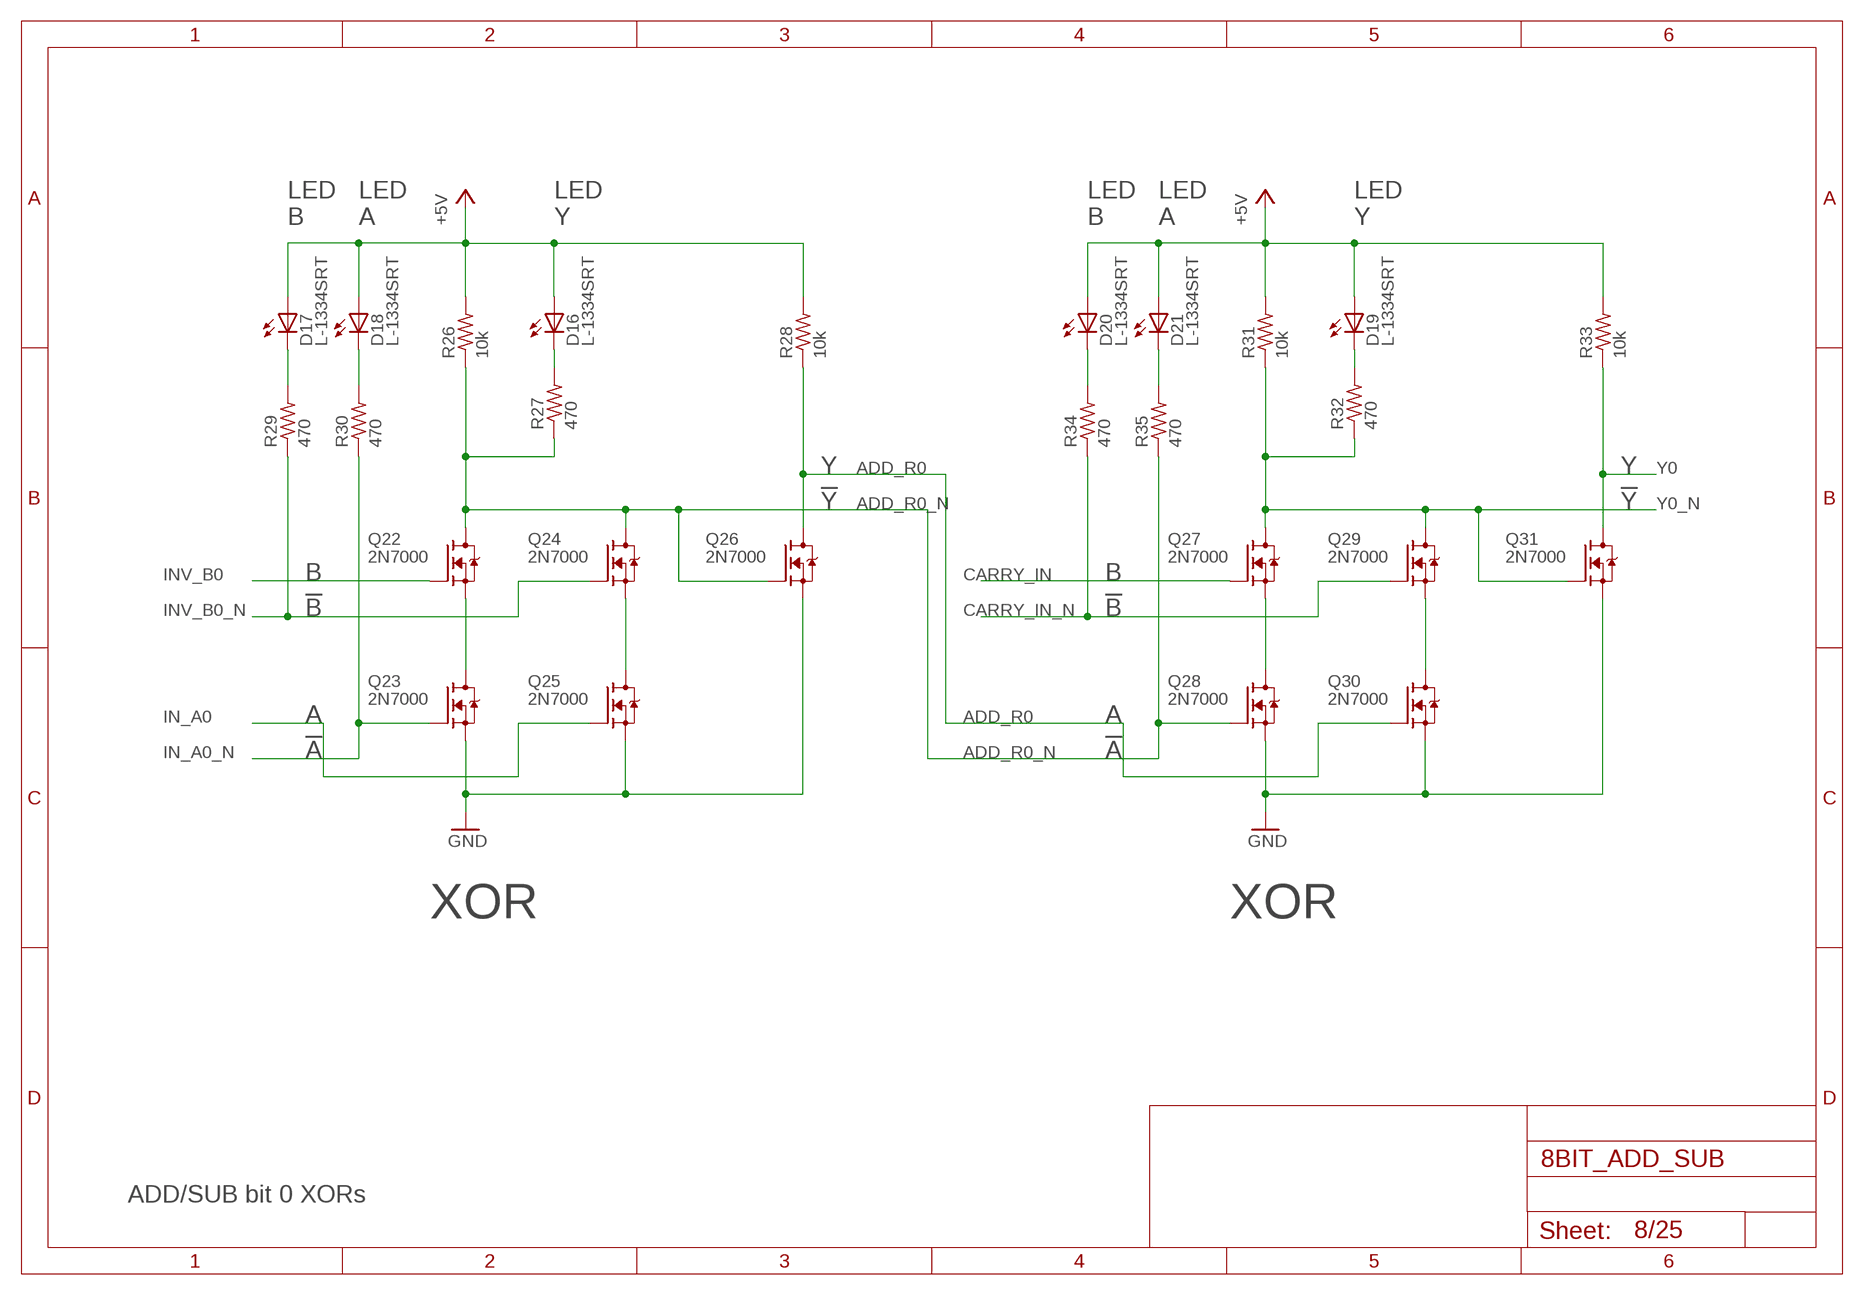
[diagram p7: schematic, sheet 8]

### Parts
D16  L-1334SRT  [LED3MM]
D17  L-1334SRT  [LED3MM]
D18  L-1334SRT  [LED3MM]
D19  L-1334SRT  [LED3MM]
D20  L-1334SRT  [LED3MM]
D21  L-1334SRT  [LED3MM]
Q22  2N7000  [TO92-DGS]
Q23  2N7000  [TO92-DGS]
Q24  2N7000  [TO92-DGS]
Q25  2N7000  [TO92-DGS]
Q26  2N7000  [TO92-DGS]
Q27  2N7000  [TO92-DGS]
Q28  2N7000  [TO92-DGS]
Q29  2N7000  [TO92-DGS]
Q30  2N7000  [TO92-DGS]
Q31  2N7000  [TO92-DGS]
R26  10k  R_P2INCH  [R_P2INCH]
R27  470  R_P2INCH  [R_P2INCH]
R28  10k  R_P2INCH  [R_P2INCH]
R29  470  R_P2INCH  [R_P2INCH]
R30  470  R_P2INCH  [R_P2INCH]
R31  10k  R_P2INCH  [R_P2INCH]
R32  470  R_P2INCH  [R_P2INCH]
R33  10k  R_P2INCH  [R_P2INCH]
R34  470  R_P2INCH  [R_P2INCH]
R35  470  R_P2INCH  [R_P2INCH]

### Nets
+5V: D16.A D17.A D18.A D19.A D20.A D21.A R26.2 R28.2 R31.2 R33.2 ; also sheet 1,3,4,5,6,7,9,10,11,12,13,14,15,16,17,18,19,20,21,22,23,24
ADD_R0: Q26.D Q30.G R28.1 ; also sheet 9
ADD_R0_N: Q22.D Q24.D Q26.G Q28.G R26.1 R27.1 R35.1 ; also sheet 9
CARRY_IN: Q27.G ; also sheet 9,24
CARRY_IN_N: Q29.G R34.1 ; also sheet 9,24
GND: Q23.S Q25.S Q26.S Q28.S Q30.S Q31.S ; also sheet 1,2,3,4,5,6,7,9,10,11,12,13,14,15,16,17,18,19,20,21,22,23,24,25
IN_A0: Q25.G ; also sheet 2,3,9,25
IN_A0_N: Q23.G R30.1 ; also sheet 3,9
INV_B0: Q22.G ; also sheet 4,9
INV_B0_N: Q24.G R29.1 ; also sheet 4,9
N$53: Q22.S Q23.D
N$54: Q24.S Q25.D
N$58: D16.K(C) R27.2
N$61: D18.K(C) R30.2
N$62: D17.K(C) R29.2
N$64: Q27.S Q28.D
N$65: Q29.S Q30.D
N$69: D19.K(C) R32.2
N$72: D21.K(C) R35.2
N$73: D20.K(C) R34.2
Y0: Q31.D R33.1 ; also sheet 2,25
Y0_N: Q27.D Q29.D Q31.G R31.1 R32.1 ; also sheet 24

### Notes on the sheet
- LED
  B
- LED
  A
- LED
  Y
- LED
  B
- LED
  A
- LED
  Y
- Y | Y
- !Y | !Y
- B | B
- !B | !B
- A | A
- !A | !A
- XOR | XOR
- ADD/SUB bit 0 XORs

## Sheet 9 of 25
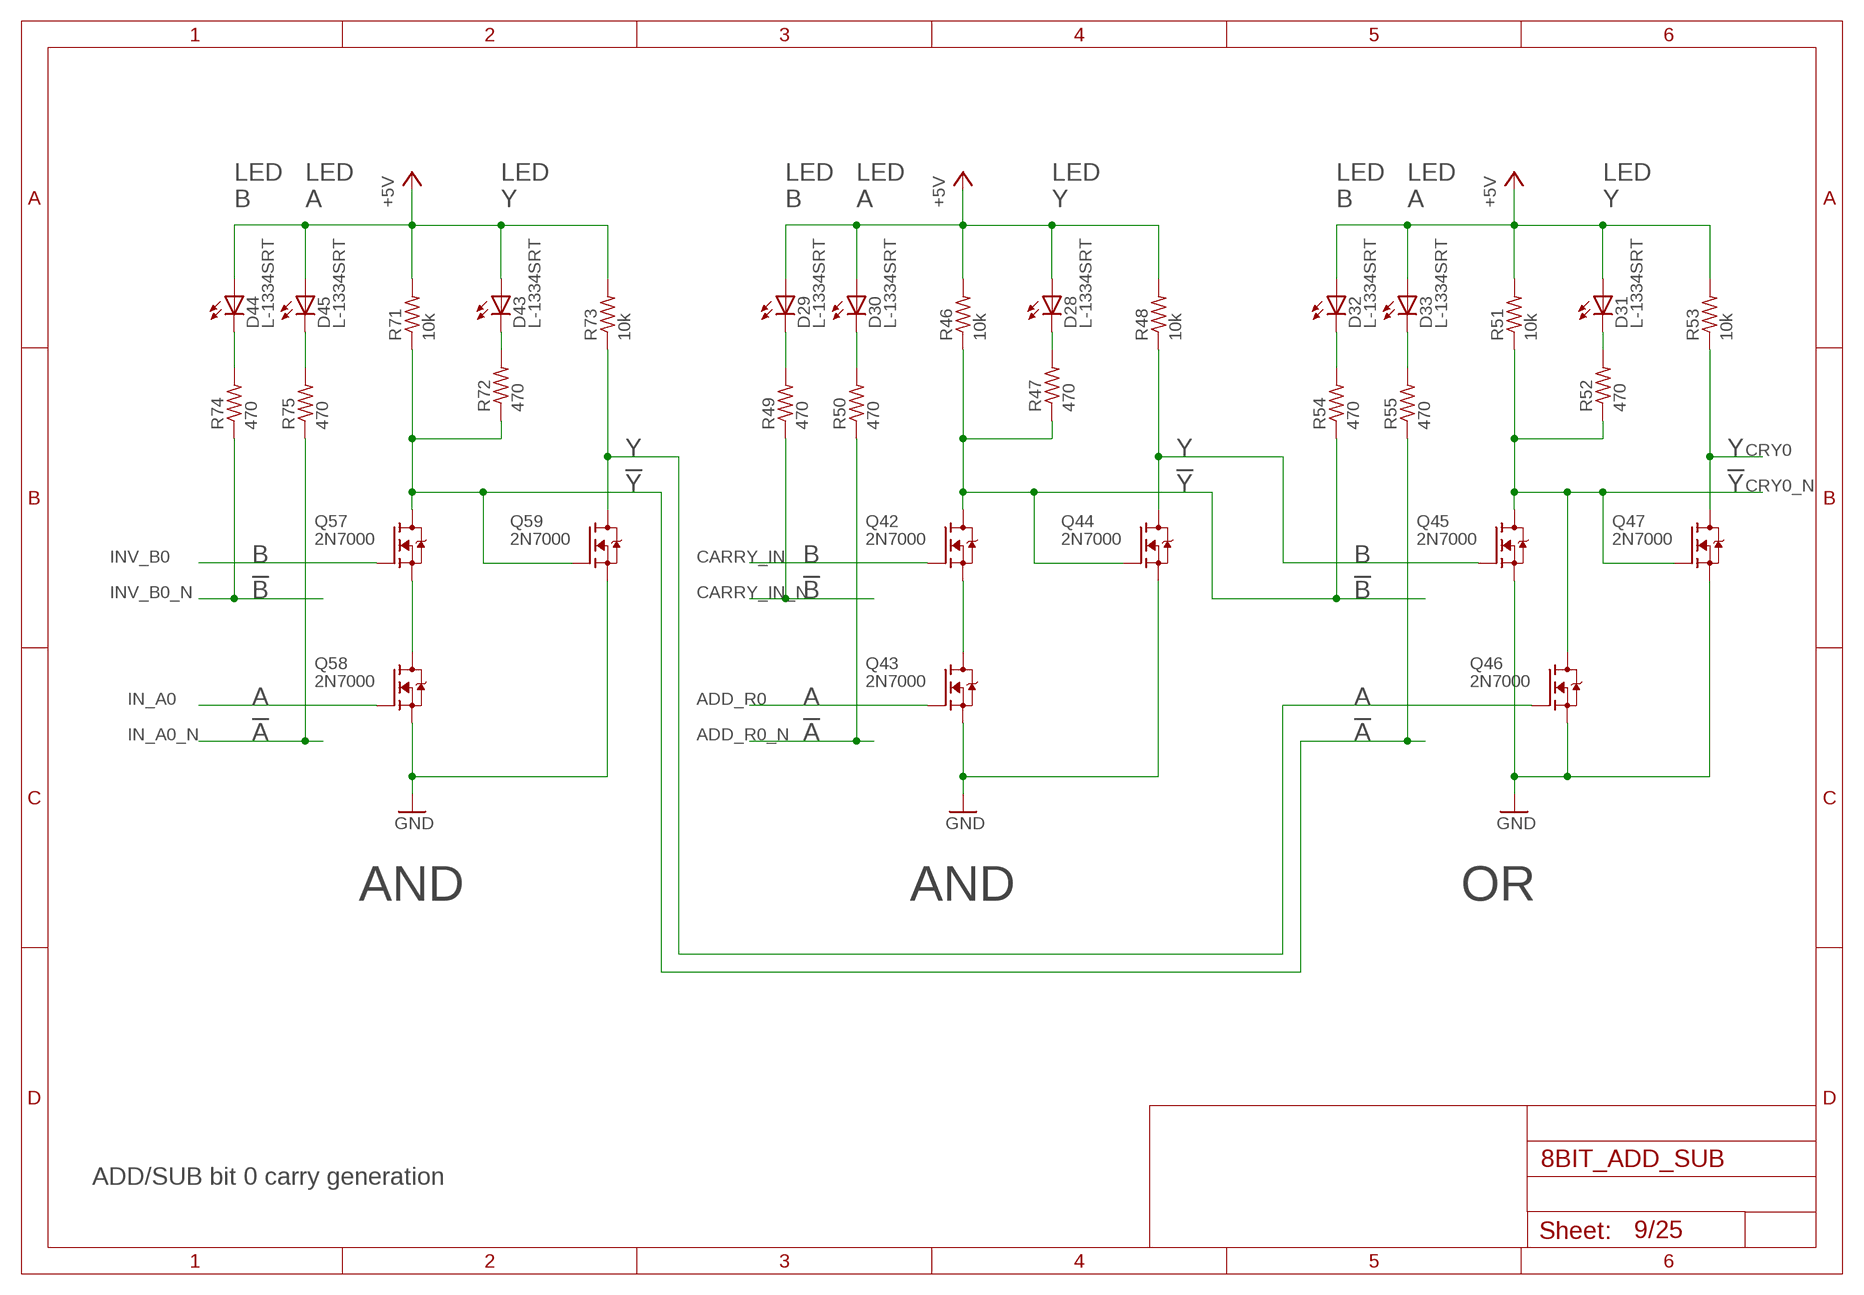
[diagram p8: schematic, sheet 9]

### Parts
D28  L-1334SRT  [LED3MM]
D29  L-1334SRT  [LED3MM]
D30  L-1334SRT  [LED3MM]
D31  L-1334SRT  [LED3MM]
D32  L-1334SRT  [LED3MM]
D33  L-1334SRT  [LED3MM]
D43  L-1334SRT  [LED3MM]
D44  L-1334SRT  [LED3MM]
D45  L-1334SRT  [LED3MM]
Q42  2N7000  [TO92-DGS]
Q43  2N7000  [TO92-DGS]
Q44  2N7000  [TO92-DGS]
Q45  2N7000  [TO92-DGS]
Q46  2N7000  [TO92-DGS]
Q47  2N7000  [TO92-DGS]
Q57  2N7000  [TO92-DGS]
Q58  2N7000  [TO92-DGS]
Q59  2N7000  [TO92-DGS]
R46  10k  R_P2INCH  [R_P2INCH]
R47  470  R_P2INCH  [R_P2INCH]
R48  10k  R_P2INCH  [R_P2INCH]
R49  470  R_P2INCH  [R_P2INCH]
R50  470  R_P2INCH  [R_P2INCH]
R51  10k  R_P2INCH  [R_P2INCH]
R52  470  R_P2INCH  [R_P2INCH]
R53  10k  R_P2INCH  [R_P2INCH]
R54  470  R_P2INCH  [R_P2INCH]
R55  470  R_P2INCH  [R_P2INCH]
R71  10k  R_P2INCH  [R_P2INCH]
R72  470  R_P2INCH  [R_P2INCH]
R73  10k  R_P2INCH  [R_P2INCH]
R74  470  R_P2INCH  [R_P2INCH]
R75  470  R_P2INCH  [R_P2INCH]

### Nets
+5V: D28.A D29.A D30.A D31.A D32.A D33.A D43.A D44.A D45.A R46.2 R48.2 R51.2 R53.2 R71.2 R73.2 ; also sheet 1,3,4,5,6,7,8,10,11,12,13,14,15,16,17,18,19,20,21,22,23,24
ADD_R0: Q43.G ; also sheet 8
ADD_R0_N: R50.1 ; also sheet 8
CARRY_IN: Q42.G ; also sheet 8,24
CARRY_IN_N: R49.1 ; also sheet 8,24
CGEN_S0: Q44.D Q45.G R48.1
CRY0: Q47.D R53.1 ; also sheet 10,11
CRY0_N: Q45.D Q46.D Q47.G R51.1 R52.1 ; also sheet 10,11
GND: Q43.S Q44.S Q45.S Q46.S Q47.S Q58.S Q59.S ; also sheet 1,2,3,4,5,6,7,8,10,11,12,13,14,15,16,17,18,19,20,21,22,23,24,25
IN_A0: Q58.G ; also sheet 2,3,8,25
IN_A0_N: R75.1 ; also sheet 3,8
INV_B0: Q57.G ; also sheet 4,8
INV_B0_N: R74.1 ; also sheet 4,8
N$97: Q42.S Q43.D
N$100: D28.K(C) R47.2
N$102: Q42.D Q44.G R46.1 R47.1 R54.1
N$105: D30.K(C) R50.2
N$106: D29.K(C) R49.2
N$109: D31.K(C) R52.2
N$114: D33.K(C) R55.2
N$115: D32.K(C) R54.2
N$145: Q57.S Q58.D
N$148: D43.K(C) R72.2
N$149: Q46.G Q59.D R73.1
N$150: Q57.D Q59.G R55.1 R71.1 R72.1
N$153: D45.K(C) R75.2
N$154: D44.K(C) R74.2

### Notes on the sheet
- LED
  B
- LED
  A
- LED
  Y
- LED
  B
- LED
  A
- LED
  Y
- LED
  B
- LED
  A
- LED
  Y
- Y | Y | Y
- !Y | !Y | !Y
- B | B | B
- !B | !B | !B
- A | A | A
- !A | !A | !A
- AND | AND | OR
- ADD/SUB bit 0 carry generation

## Sheet 10 of 25
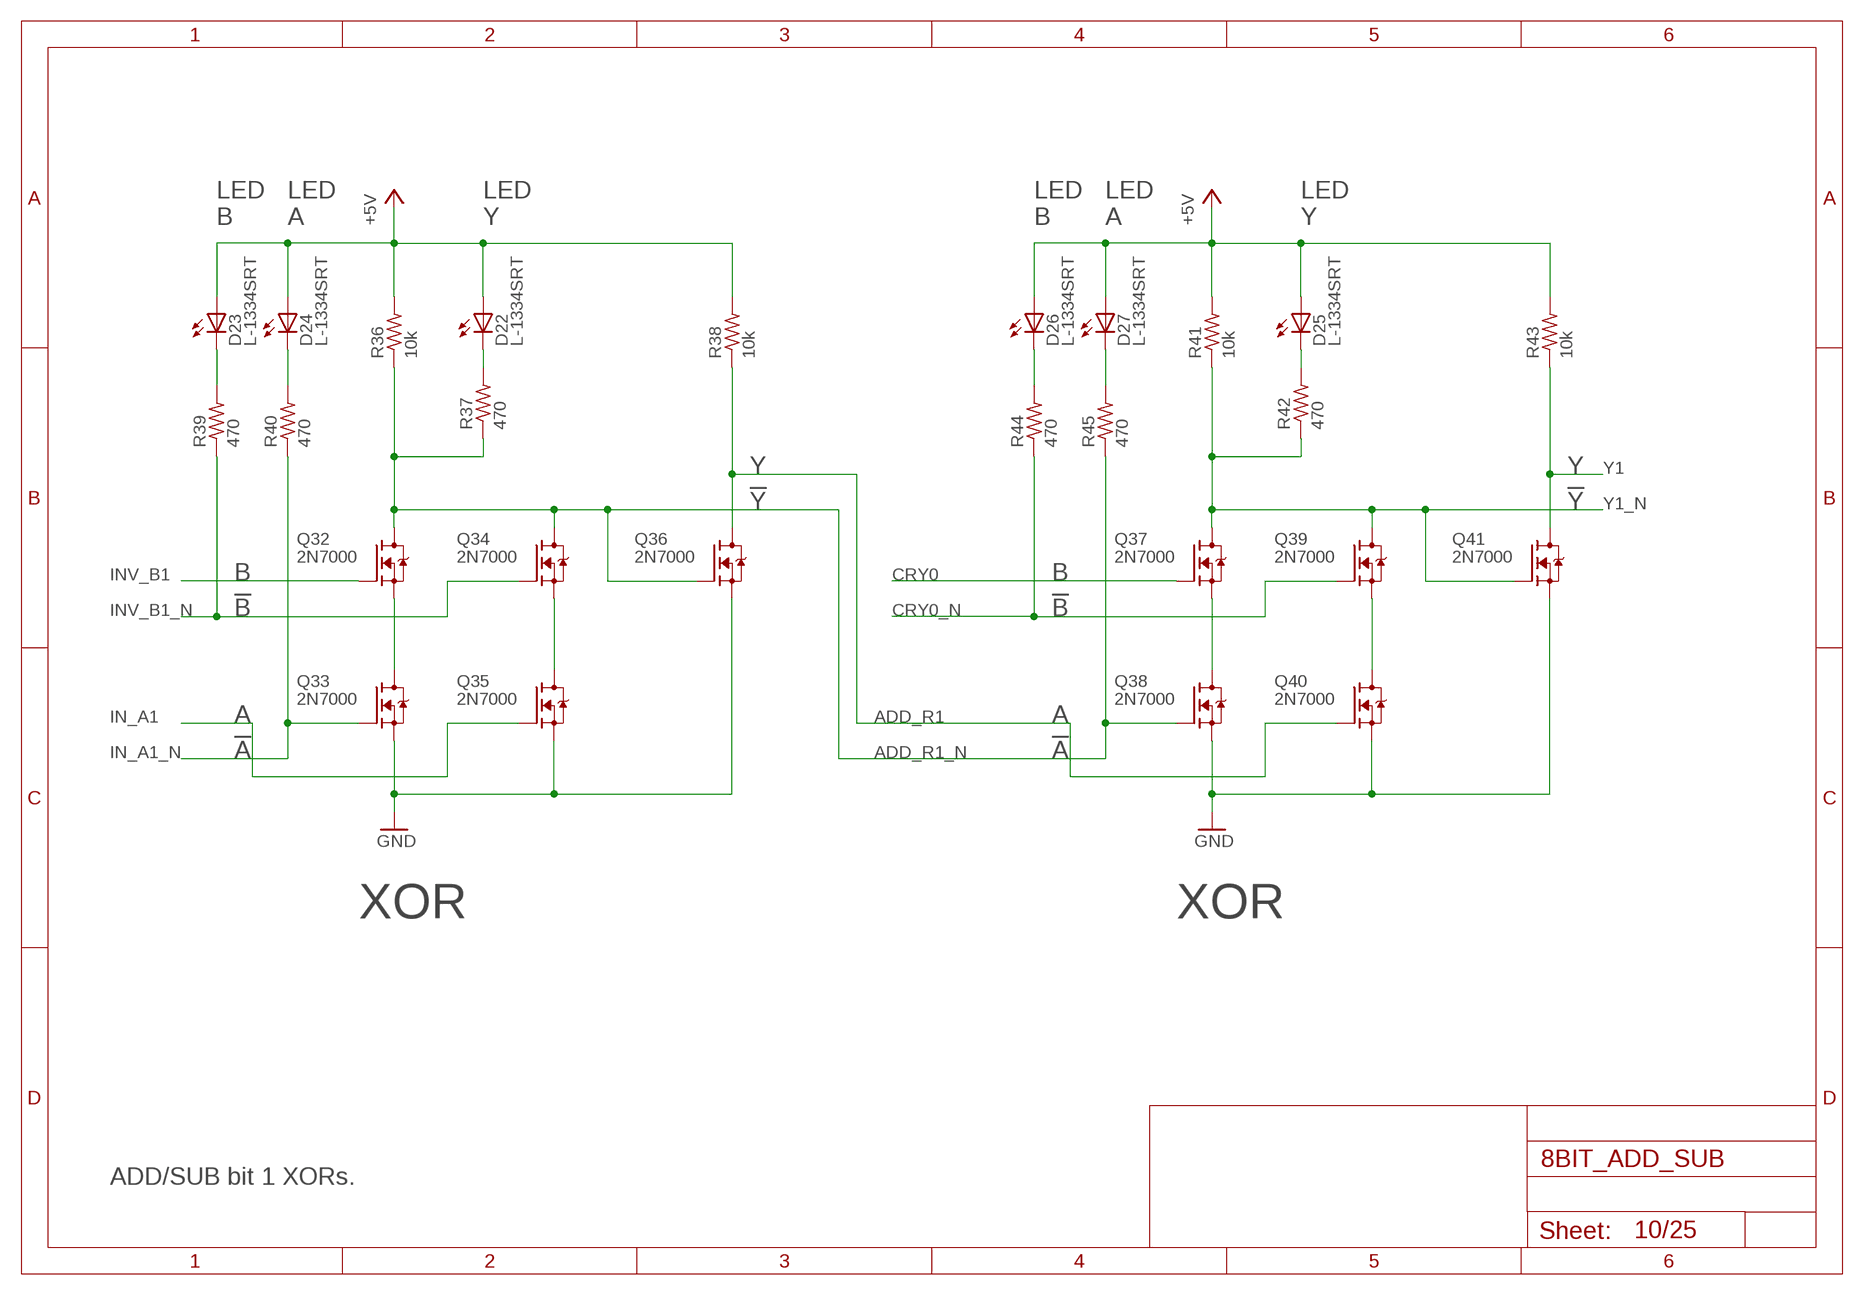
[diagram p9: schematic, sheet 10]

### Parts
D22  L-1334SRT  [LED3MM]
D23  L-1334SRT  [LED3MM]
D24  L-1334SRT  [LED3MM]
D25  L-1334SRT  [LED3MM]
D26  L-1334SRT  [LED3MM]
D27  L-1334SRT  [LED3MM]
Q32  2N7000  [TO92-DGS]
Q33  2N7000  [TO92-DGS]
Q34  2N7000  [TO92-DGS]
Q35  2N7000  [TO92-DGS]
Q36  2N7000  [TO92-DGS]
Q37  2N7000  [TO92-DGS]
Q38  2N7000  [TO92-DGS]
Q39  2N7000  [TO92-DGS]
Q40  2N7000  [TO92-DGS]
Q41  2N7000  [TO92-DGS]
R36  10k  R_P2INCH  [R_P2INCH]
R37  470  R_P2INCH  [R_P2INCH]
R38  10k  R_P2INCH  [R_P2INCH]
R39  470  R_P2INCH  [R_P2INCH]
R40  470  R_P2INCH  [R_P2INCH]
R41  10k  R_P2INCH  [R_P2INCH]
R42  470  R_P2INCH  [R_P2INCH]
R43  10k  R_P2INCH  [R_P2INCH]
R44  470  R_P2INCH  [R_P2INCH]
R45  470  R_P2INCH  [R_P2INCH]

### Nets
+5V: D22.A D23.A D24.A D25.A D26.A D27.A R36.2 R38.2 R41.2 R43.2 ; also sheet 1,3,4,5,6,7,8,9,11,12,13,14,15,16,17,18,19,20,21,22,23,24
ADD_R1: Q36.D Q40.G R38.1 ; also sheet 11
ADD_R1_N: Q32.D Q34.D Q36.G Q38.G R36.1 R37.1 R45.1 ; also sheet 11
CRY0: Q37.G ; also sheet 9,11
CRY0_N: Q39.G R44.1 ; also sheet 9,11
GND: Q33.S Q35.S Q36.S Q38.S Q40.S Q41.S ; also sheet 1,2,3,4,5,6,7,8,9,11,12,13,14,15,16,17,18,19,20,21,22,23,24,25
IN_A1: Q35.G ; also sheet 2,3,11,25
IN_A1_N: Q33.G R40.1 ; also sheet 3,11
INV_B1: Q32.G ; also sheet 4,11
INV_B1_N: Q34.G R39.1 ; also sheet 4,11
N$75: Q32.S Q33.D
N$76: Q34.S Q35.D
N$80: D22.K(C) R37.2
N$83: D24.K(C) R40.2
N$84: D23.K(C) R39.2
N$86: Q37.S Q38.D
N$87: Q39.S Q40.D
N$91: D25.K(C) R42.2
N$94: D27.K(C) R45.2
N$95: D26.K(C) R44.2
Y1: Q41.D R43.1 ; also sheet 2,25
Y1_N: Q37.D Q39.D Q41.G R41.1 R42.1 ; also sheet 24

### Notes on the sheet
- LED
  B
- LED
  A
- LED
  Y
- LED
  B
- LED
  A
- LED
  Y
- Y | Y
- !Y | !Y
- B | B
- !B | !B
- A | A
- !A | !A
- XOR | XOR
- ADD/SUB bit 1 XORs.

## Sheet 11 of 25
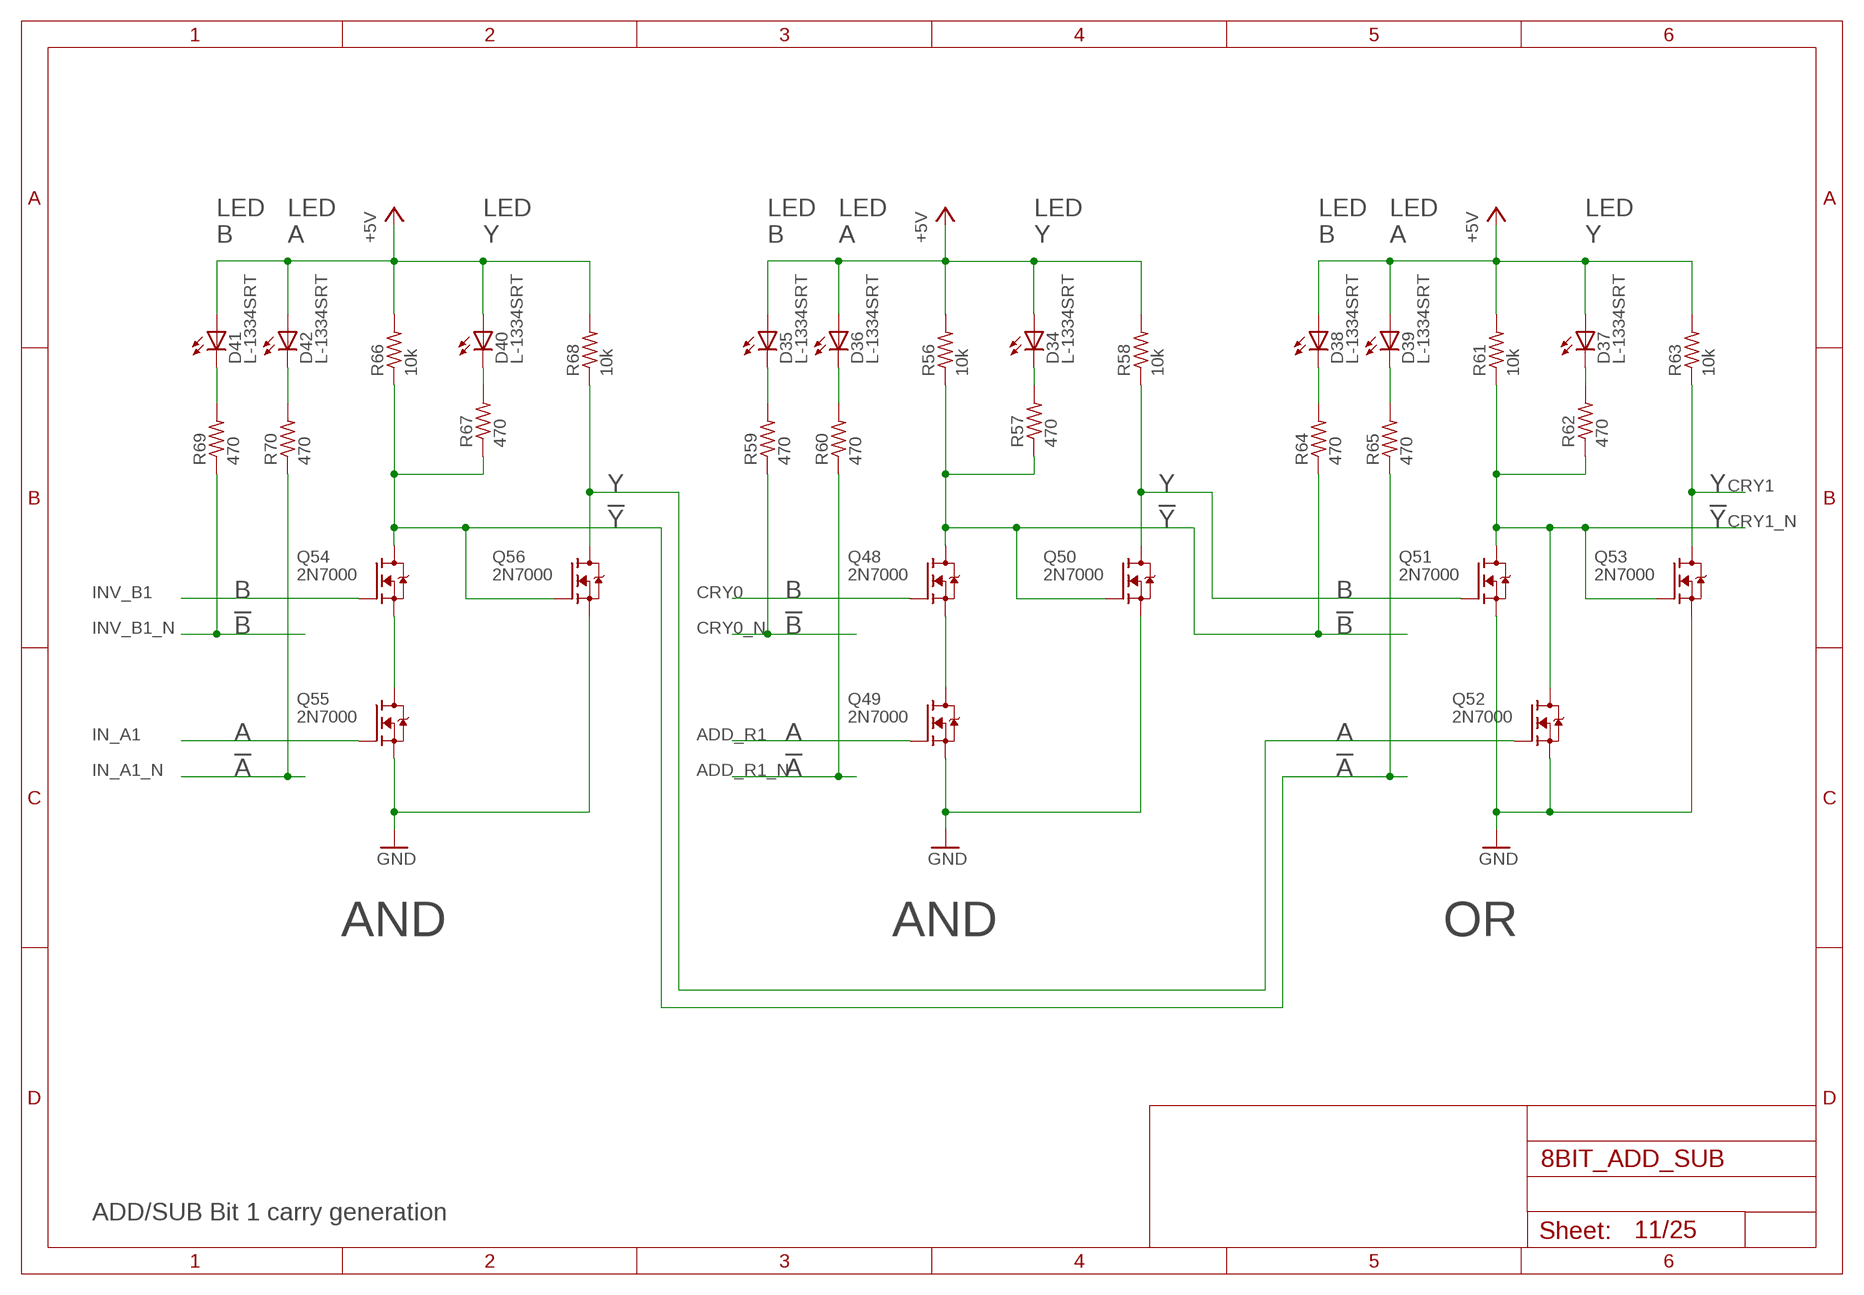
[diagram p10: schematic, sheet 11]

### Parts
D34  L-1334SRT  [LED3MM]
D35  L-1334SRT  [LED3MM]
D36  L-1334SRT  [LED3MM]
D37  L-1334SRT  [LED3MM]
D38  L-1334SRT  [LED3MM]
D39  L-1334SRT  [LED3MM]
D40  L-1334SRT  [LED3MM]
D41  L-1334SRT  [LED3MM]
D42  L-1334SRT  [LED3MM]
Q48  2N7000  [TO92-DGS]
Q49  2N7000  [TO92-DGS]
Q50  2N7000  [TO92-DGS]
Q51  2N7000  [TO92-DGS]
Q52  2N7000  [TO92-DGS]
Q53  2N7000  [TO92-DGS]
Q54  2N7000  [TO92-DGS]
Q55  2N7000  [TO92-DGS]
Q56  2N7000  [TO92-DGS]
R56  10k  R_P2INCH  [R_P2INCH]
R57  470  R_P2INCH  [R_P2INCH]
R58  10k  R_P2INCH  [R_P2INCH]
R59  470  R_P2INCH  [R_P2INCH]
R60  470  R_P2INCH  [R_P2INCH]
R61  10k  R_P2INCH  [R_P2INCH]
R62  470  R_P2INCH  [R_P2INCH]
R63  10k  R_P2INCH  [R_P2INCH]
R64  470  R_P2INCH  [R_P2INCH]
R65  470  R_P2INCH  [R_P2INCH]
R66  10k  R_P2INCH  [R_P2INCH]
R67  470  R_P2INCH  [R_P2INCH]
R68  10k  R_P2INCH  [R_P2INCH]
R69  470  R_P2INCH  [R_P2INCH]
R70  470  R_P2INCH  [R_P2INCH]

### Nets
+5V: D34.A D35.A D36.A D37.A D38.A D39.A D40.A D41.A D42.A R56.2 R58.2 R61.2 R63.2 R66.2 R68.2 ; also sheet 1,3,4,5,6,7,8,9,10,12,13,14,15,16,17,18,19,20,21,22,23,24
ADD_R1: Q49.G ; also sheet 10
ADD_R1_N: R60.1 ; also sheet 10
CRY0: Q48.G ; also sheet 9,10
CRY0_N: R59.1 ; also sheet 9,10
CRY1: Q53.D R63.1 ; also sheet 12,13
CRY1_N: Q51.D Q52.D Q53.G R61.1 R62.1 ; also sheet 12,13
GND: Q49.S Q50.S Q51.S Q52.S Q53.S Q55.S Q56.S ; also sheet 1,2,3,4,5,6,7,8,9,10,12,13,14,15,16,17,18,19,20,21,22,23,24,25
IN_A1: Q55.G ; also sheet 2,3,10,25
IN_A1_N: R70.1 ; also sheet 3,10
INV_B1: Q54.G ; also sheet 4,10
INV_B1_N: R69.1 ; also sheet 4,10
N$116: Q48.S Q49.D
N$119: D34.K(C) R57.2
N$120: Q50.D Q51.G R58.1
N$121: Q48.D Q50.G R56.1 R57.1 R64.1
N$124: D36.K(C) R60.2
N$125: D35.K(C) R59.2
N$128: D37.K(C) R62.2
N$133: D39.K(C) R65.2
N$134: D38.K(C) R64.2
N$135: Q54.S Q55.D
N$138: D40.K(C) R67.2
N$139: Q52.G Q56.D R68.1
N$140: Q54.D Q56.G R65.1 R66.1 R67.1
N$143: D42.K(C) R70.2
N$144: D41.K(C) R69.2

### Notes on the sheet
- LED
  B
- LED
  A
- LED
  Y
- LED
  B
- LED
  A
- LED
  Y
- LED
  B
- LED
  A
- LED
  Y
- Y | Y | Y
- !Y | !Y | !Y
- B | B | B
- !B | !B | !B
- A | A | A
- !A | !A | !A
- AND | AND | OR
- ADD/SUB Bit 1 carry generation

## Sheet 12 of 25
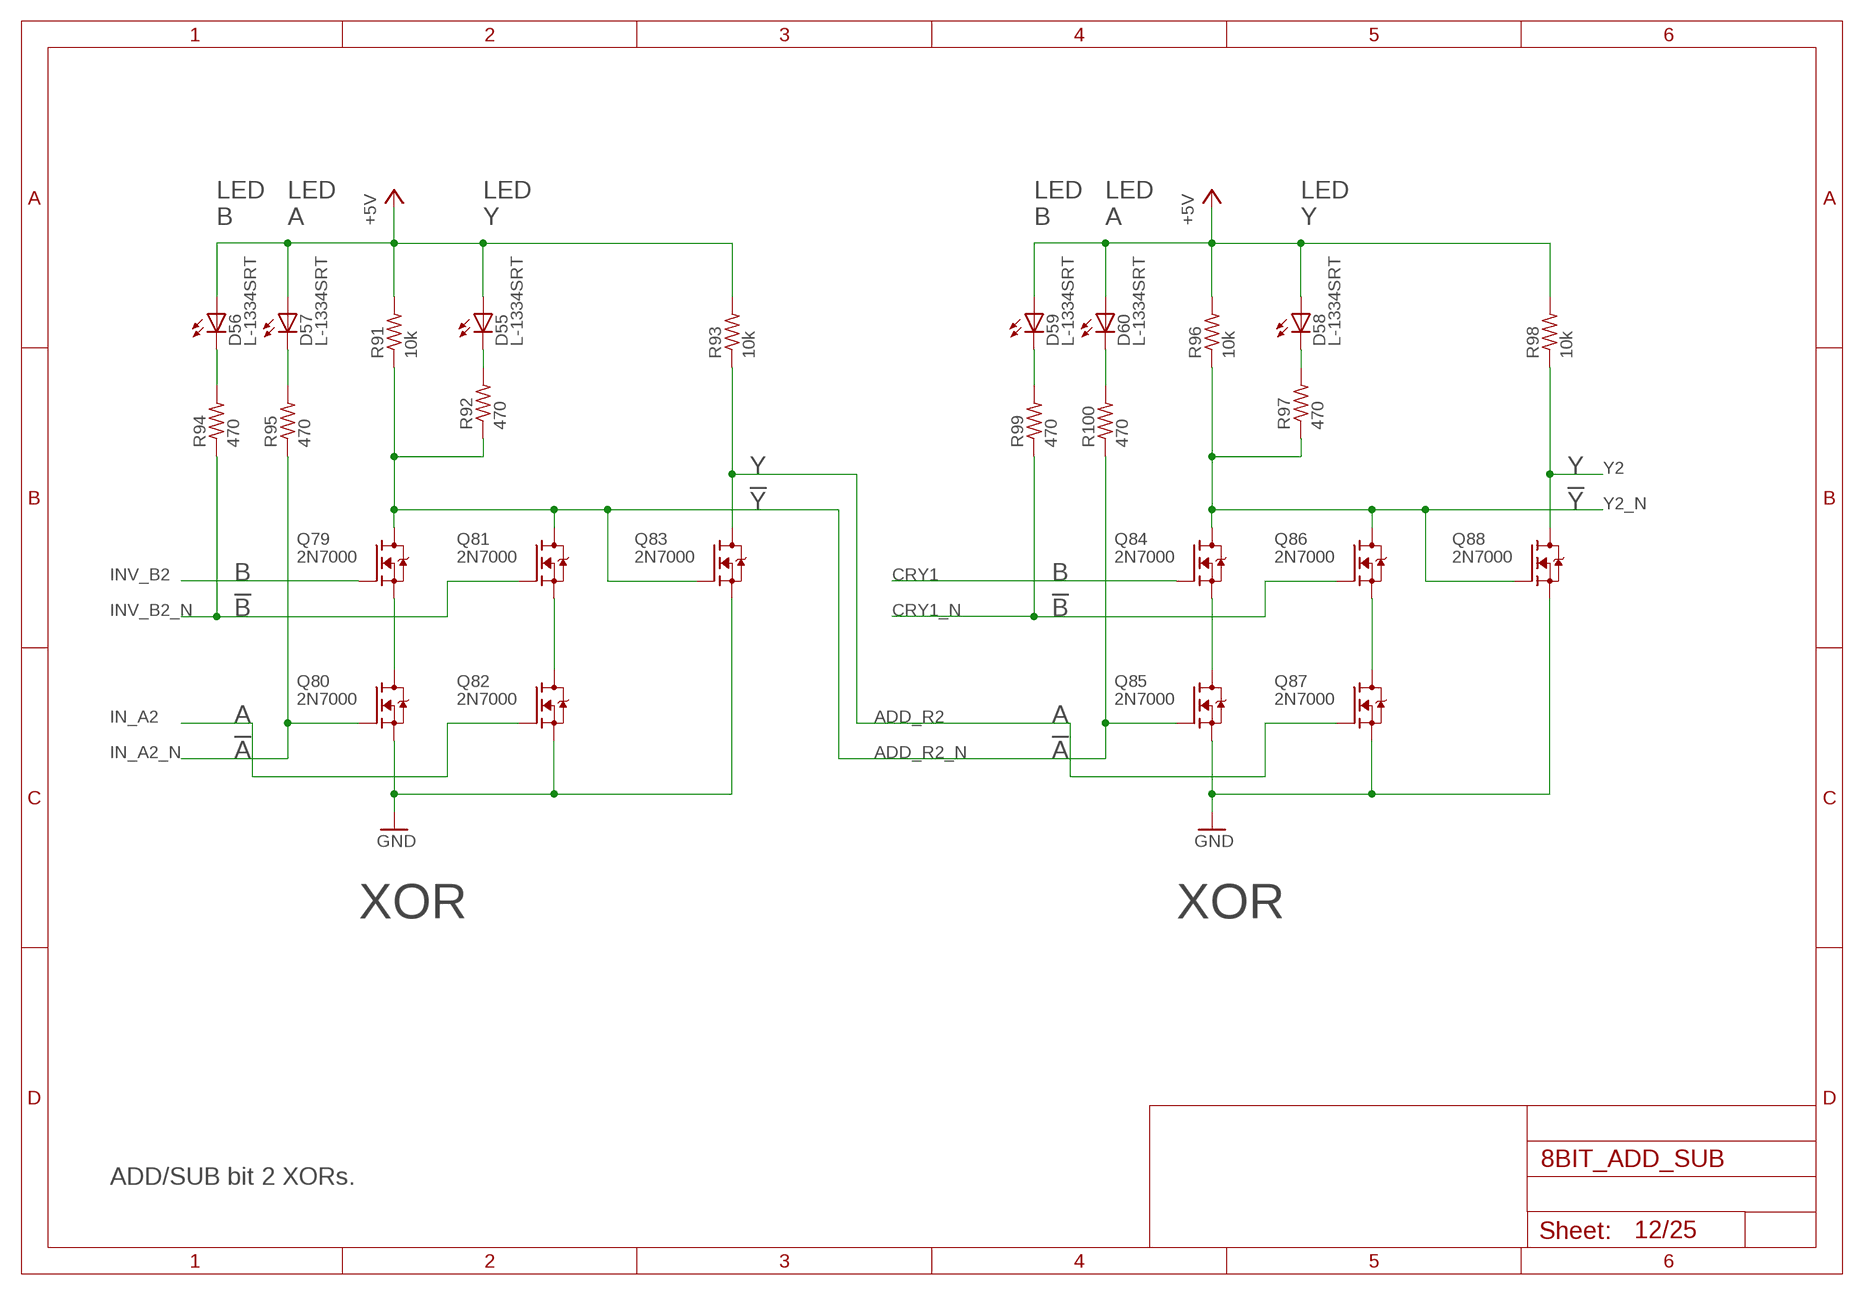
[diagram p11: schematic, sheet 12]

### Parts
D55  L-1334SRT  [LED3MM]
D56  L-1334SRT  [LED3MM]
D57  L-1334SRT  [LED3MM]
D58  L-1334SRT  [LED3MM]
D59  L-1334SRT  [LED3MM]
D60  L-1334SRT  [LED3MM]
Q79  2N7000  [TO92-DGS]
Q80  2N7000  [TO92-DGS]
Q81  2N7000  [TO92-DGS]
Q82  2N7000  [TO92-DGS]
Q83  2N7000  [TO92-DGS]
Q84  2N7000  [TO92-DGS]
Q85  2N7000  [TO92-DGS]
Q86  2N7000  [TO92-DGS]
Q87  2N7000  [TO92-DGS]
Q88  2N7000  [TO92-DGS]
R91  10k  R_P2INCH  [R_P2INCH]
R92  470  R_P2INCH  [R_P2INCH]
R93  10k  R_P2INCH  [R_P2INCH]
R94  470  R_P2INCH  [R_P2INCH]
R95  470  R_P2INCH  [R_P2INCH]
R96  10k  R_P2INCH  [R_P2INCH]
R97  470  R_P2INCH  [R_P2INCH]
R98  10k  R_P2INCH  [R_P2INCH]
R99  470  R_P2INCH  [R_P2INCH]
R100  470  R_P2INCH  [R_P2INCH]

### Nets
+5V: D55.A D56.A D57.A D58.A D59.A D60.A R91.2 R93.2 R96.2 R98.2 ; also sheet 1,3,4,5,6,7,8,9,10,11,13,14,15,16,17,18,19,20,21,22,23,24
ADD_R2: Q83.D Q87.G R93.1 ; also sheet 13
ADD_R2_N: Q79.D Q81.D Q83.G Q85.G R91.1 R92.1 R100.1 ; also sheet 13
CRY1: Q84.G ; also sheet 11,13
CRY1_N: Q86.G R99.1 ; also sheet 11,13
GND: Q80.S Q82.S Q83.S Q85.S Q87.S Q88.S ; also sheet 1,2,3,4,5,6,7,8,9,10,11,13,14,15,16,17,18,19,20,21,22,23,24,25
IN_A2: Q82.G ; also sheet 2,3,13,25
IN_A2_N: Q80.G R95.1 ; also sheet 3,13
INV_B2: Q79.G ; also sheet 5,13
INV_B2_N: Q81.G R94.1 ; also sheet 5,13
N$33: Q79.S Q80.D
N$34: Q81.S Q82.D
N$35: D55.K(C) R92.2
N$37: D57.K(C) R95.2
N$38: D56.K(C) R94.2
N$41: Q84.S Q85.D
N$44: Q86.S Q87.D
N$45: D58.K(C) R97.2
N$46: D60.K(C) R100.2
N$48: D59.K(C) R99.2
Y2: Q88.D R98.1 ; also sheet 2,25
Y2_N: Q84.D Q86.D Q88.G R96.1 R97.1 ; also sheet 24

### Notes on the sheet
- LED
  B
- LED
  A
- LED
  Y
- LED
  B
- LED
  A
- LED
  Y
- Y | Y
- !Y | !Y
- B | B
- !B | !B
- A | A
- !A | !A
- XOR | XOR
- ADD/SUB bit 2 XORs.

## Sheet 13 of 25
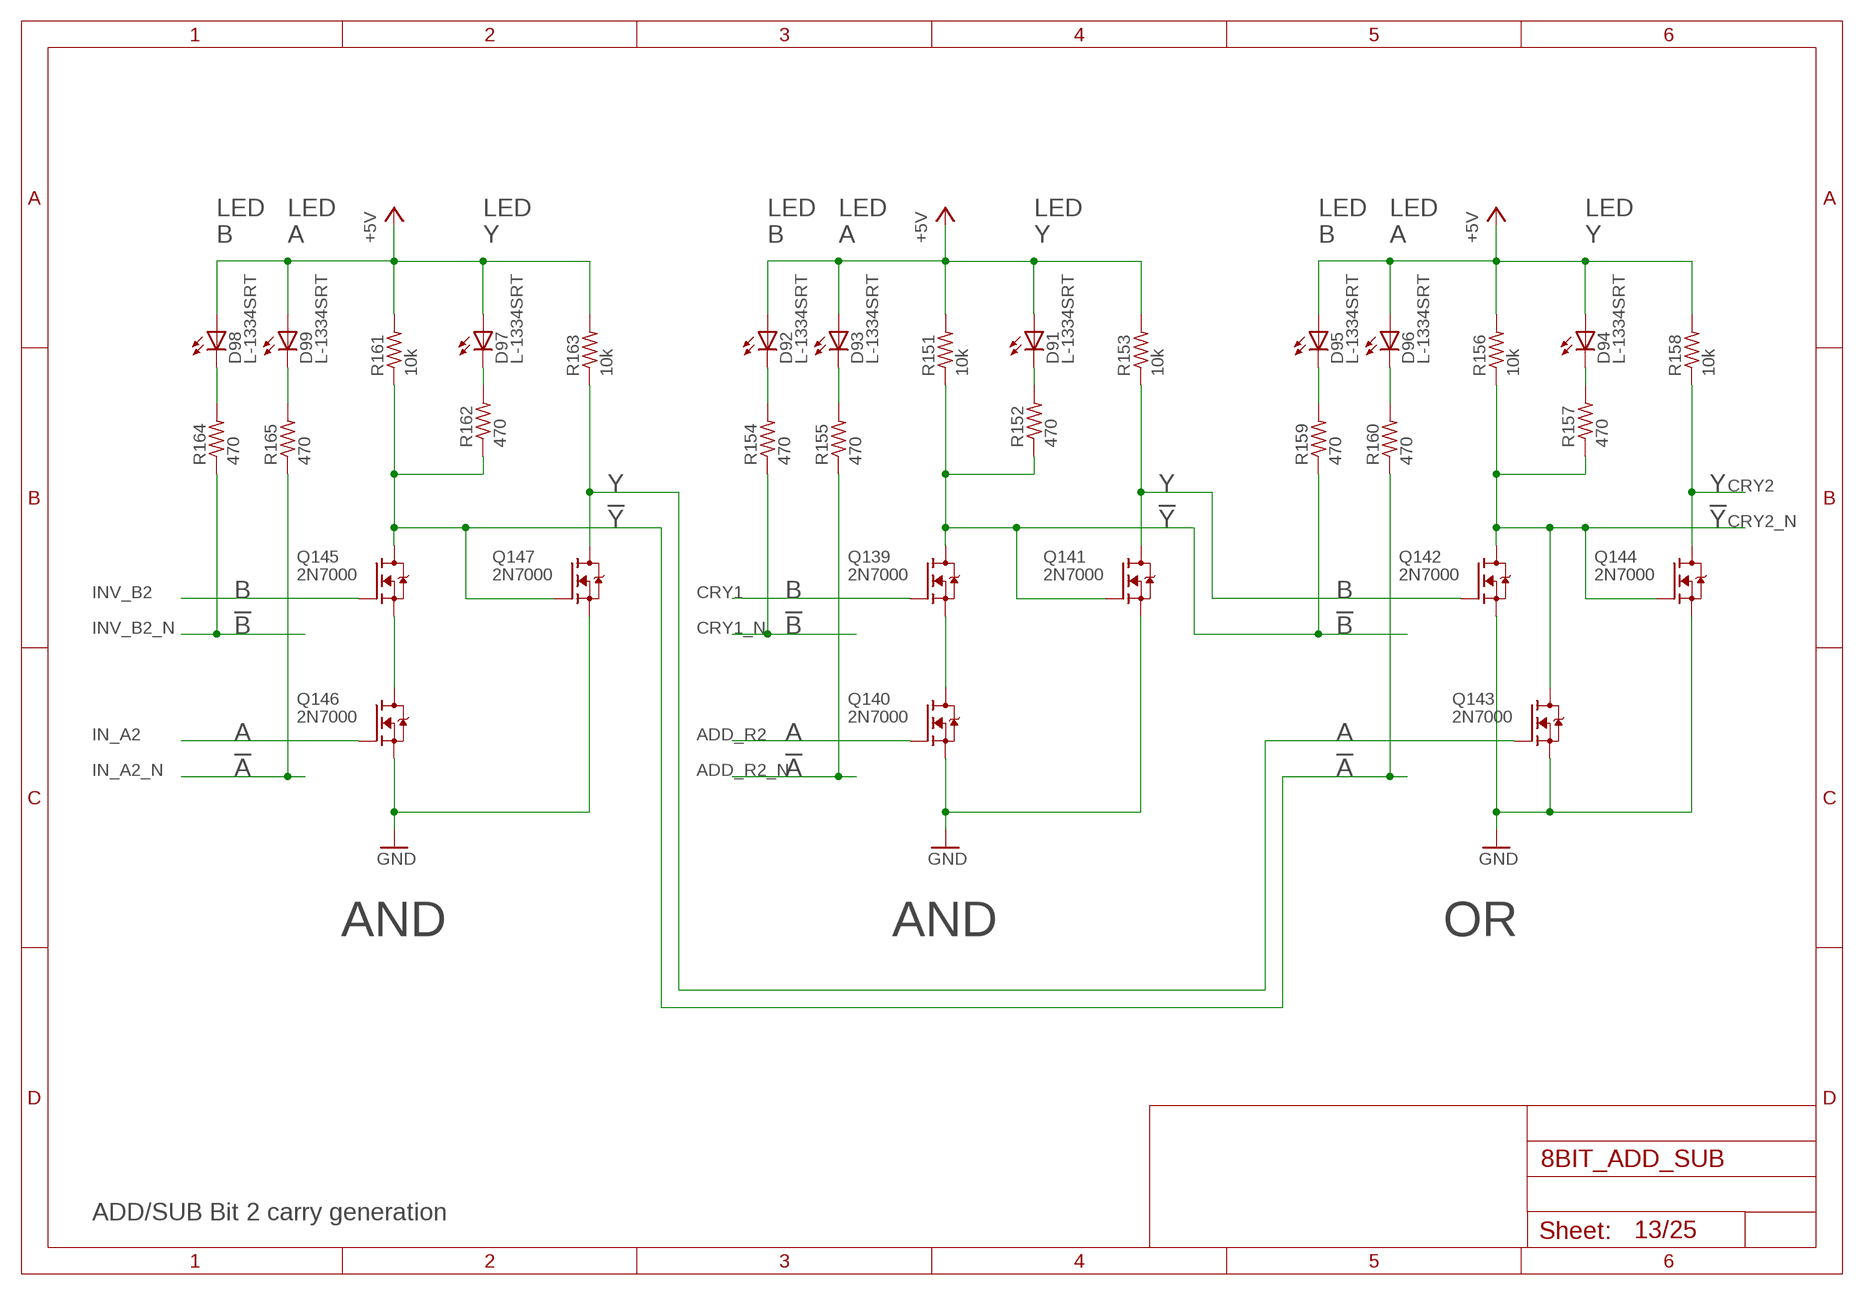
[diagram p12: schematic, sheet 13]

### Parts
D91  L-1334SRT  [LED3MM]
D92  L-1334SRT  [LED3MM]
D93  L-1334SRT  [LED3MM]
D94  L-1334SRT  [LED3MM]
D95  L-1334SRT  [LED3MM]
D96  L-1334SRT  [LED3MM]
D97  L-1334SRT  [LED3MM]
D98  L-1334SRT  [LED3MM]
D99  L-1334SRT  [LED3MM]
Q139  2N7000  [TO92-DGS]
Q140  2N7000  [TO92-DGS]
Q141  2N7000  [TO92-DGS]
Q142  2N7000  [TO92-DGS]
Q143  2N7000  [TO92-DGS]
Q144  2N7000  [TO92-DGS]
Q145  2N7000  [TO92-DGS]
Q146  2N7000  [TO92-DGS]
Q147  2N7000  [TO92-DGS]
R151  10k  R_P2INCH  [R_P2INCH]
R152  470  R_P2INCH  [R_P2INCH]
R153  10k  R_P2INCH  [R_P2INCH]
R154  470  R_P2INCH  [R_P2INCH]
R155  470  R_P2INCH  [R_P2INCH]
R156  10k  R_P2INCH  [R_P2INCH]
R157  470  R_P2INCH  [R_P2INCH]
R158  10k  R_P2INCH  [R_P2INCH]
R159  470  R_P2INCH  [R_P2INCH]
R160  470  R_P2INCH  [R_P2INCH]
R161  10k  R_P2INCH  [R_P2INCH]
R162  470  R_P2INCH  [R_P2INCH]
R163  10k  R_P2INCH  [R_P2INCH]
R164  470  R_P2INCH  [R_P2INCH]
R165  470  R_P2INCH  [R_P2INCH]

### Nets
+5V: D91.A D92.A D93.A D94.A D95.A D96.A D97.A D98.A D99.A R151.2 R153.2 R156.2 R158.2 R161.2 R163.2 ; also sheet 1,3,4,5,6,7,8,9,10,11,12,14,15,16,17,18,19,20,21,22,23,24
ADD_R2: Q140.G ; also sheet 12
ADD_R2_N: R155.1 ; also sheet 12
CRY1: Q139.G ; also sheet 11,12
CRY1_N: R154.1 ; also sheet 11,12
CRY2: Q144.D R158.1 ; also sheet 14,15
CRY2_N: Q142.D Q143.D Q144.G R156.1 R157.1 ; also sheet 14,15
GND: Q140.S Q141.S Q142.S Q143.S Q144.S Q146.S Q147.S ; also sheet 1,2,3,4,5,6,7,8,9,10,11,12,14,15,16,17,18,19,20,21,22,23,24,25
IN_A2: Q146.G ; also sheet 2,3,12,25
IN_A2_N: R165.1 ; also sheet 3,12
INV_B2: Q145.G ; also sheet 5,12
INV_B2_N: R164.1 ; also sheet 5,12
N$142: Q139.S Q140.D
N$146: D91.K(C) R152.2
N$147: Q141.D Q142.G R153.1
N$151: Q139.D Q141.G R151.1 R152.1 R159.1
N$152: D93.K(C) R155.2
N$155: D92.K(C) R154.2
N$156: D94.K(C) R157.2
N$157: D96.K(C) R160.2
N$158: D95.K(C) R159.2
N$159: Q145.S Q146.D
N$160: D97.K(C) R162.2
N$161: Q143.G Q147.D R163.1
N$162: Q145.D Q147.G R160.1 R161.1 R162.1
N$163: D99.K(C) R165.2
N$164: D98.K(C) R164.2

### Notes on the sheet
- LED
  B
- LED
  A
- LED
  Y
- LED
  B
- LED
  A
- LED
  Y
- LED
  B
- LED
  A
- LED
  Y
- Y | Y | Y
- !Y | !Y | !Y
- B | B | B
- !B | !B | !B
- A | A | A
- !A | !A | !A
- AND | AND | OR
- ADD/SUB Bit 2 carry generation

## Sheet 14 of 25
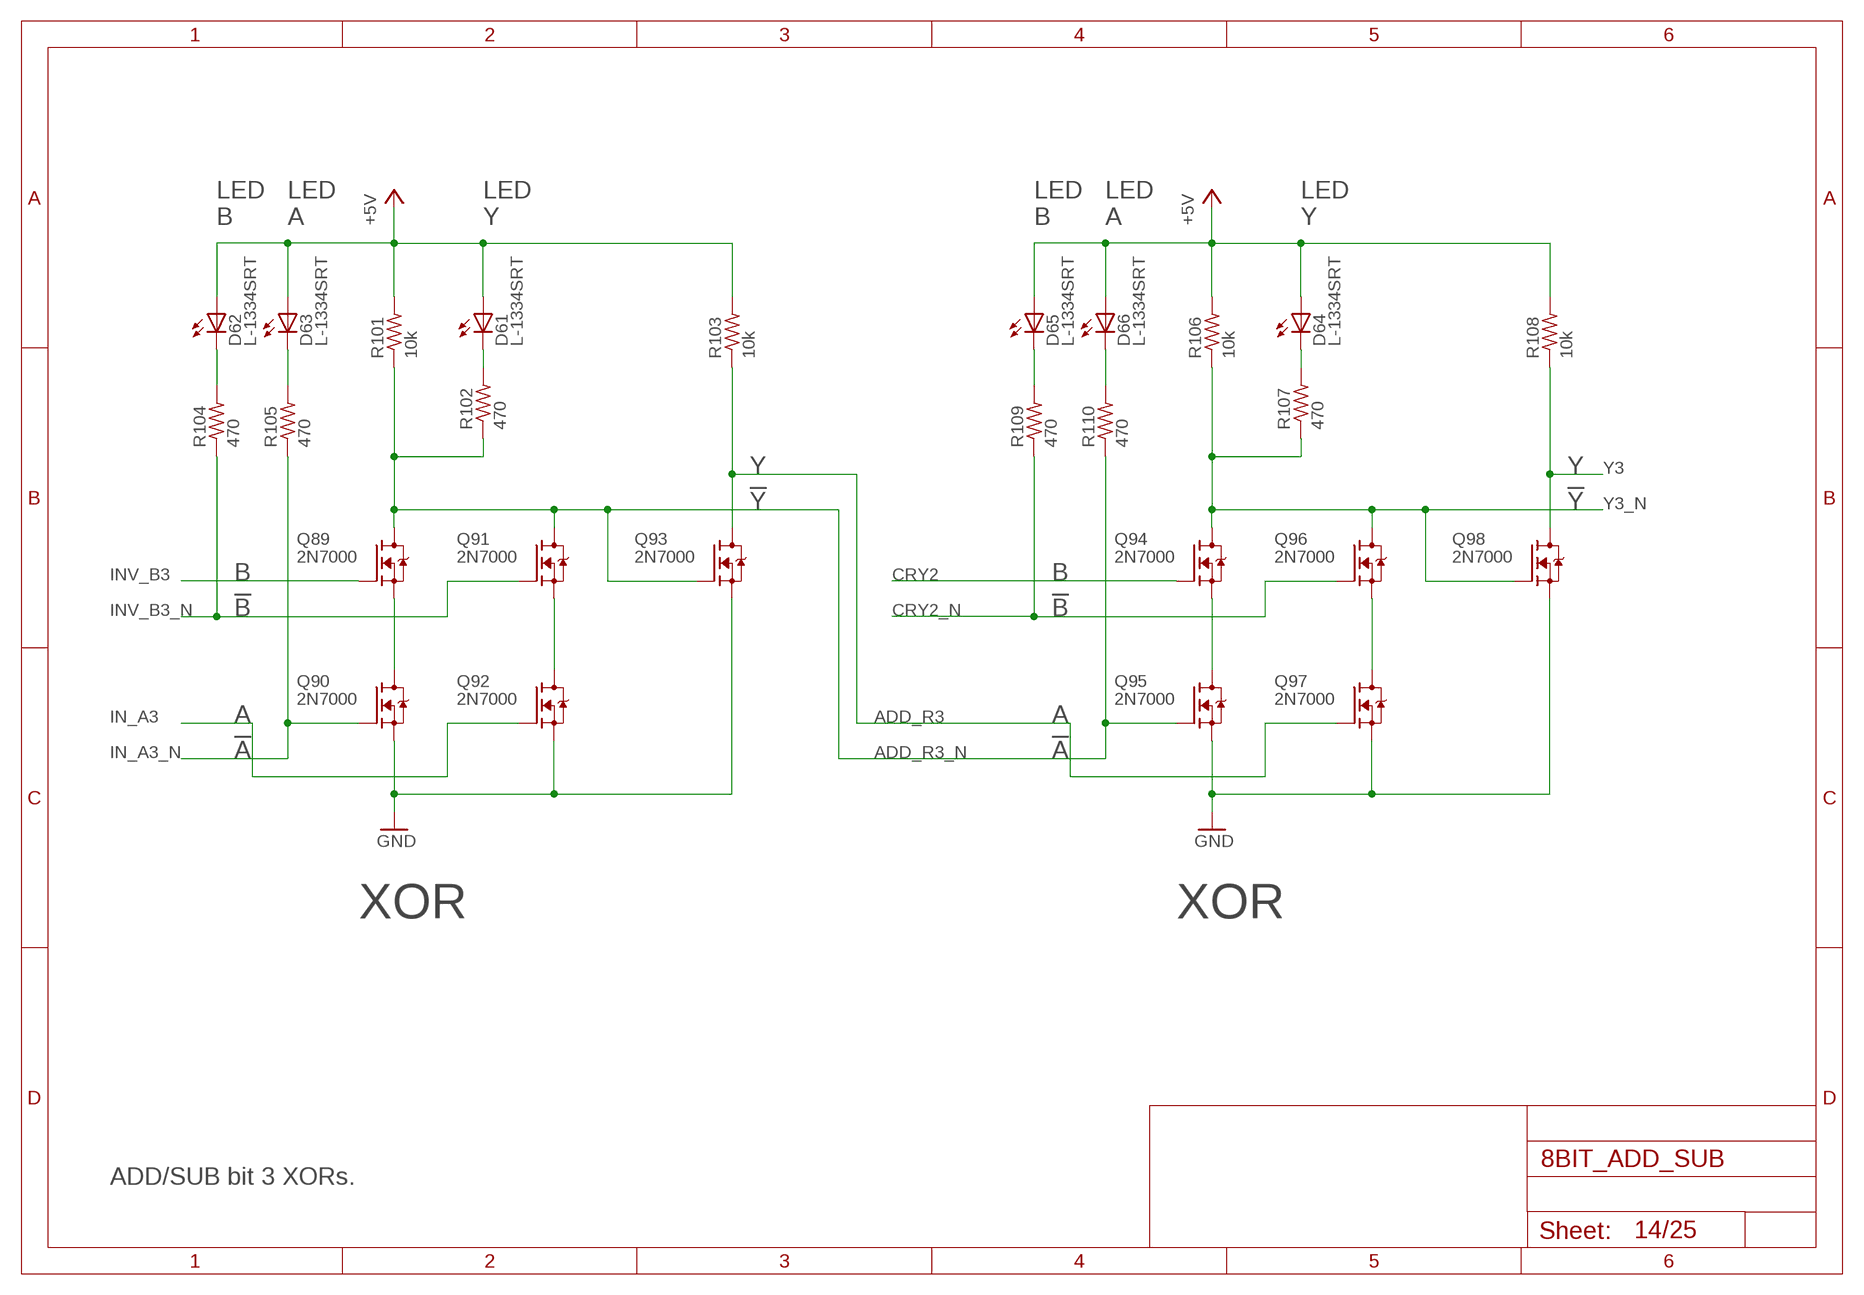
[diagram p13: schematic, sheet 14]

### Parts
D61  L-1334SRT  [LED3MM]
D62  L-1334SRT  [LED3MM]
D63  L-1334SRT  [LED3MM]
D64  L-1334SRT  [LED3MM]
D65  L-1334SRT  [LED3MM]
D66  L-1334SRT  [LED3MM]
Q89  2N7000  [TO92-DGS]
Q90  2N7000  [TO92-DGS]
Q91  2N7000  [TO92-DGS]
Q92  2N7000  [TO92-DGS]
Q93  2N7000  [TO92-DGS]
Q94  2N7000  [TO92-DGS]
Q95  2N7000  [TO92-DGS]
Q96  2N7000  [TO92-DGS]
Q97  2N7000  [TO92-DGS]
Q98  2N7000  [TO92-DGS]
R101  10k  R_P2INCH  [R_P2INCH]
R102  470  R_P2INCH  [R_P2INCH]
R103  10k  R_P2INCH  [R_P2INCH]
R104  470  R_P2INCH  [R_P2INCH]
R105  470  R_P2INCH  [R_P2INCH]
R106  10k  R_P2INCH  [R_P2INCH]
R107  470  R_P2INCH  [R_P2INCH]
R108  10k  R_P2INCH  [R_P2INCH]
R109  470  R_P2INCH  [R_P2INCH]
R110  470  R_P2INCH  [R_P2INCH]

### Nets
+5V: D61.A D62.A D63.A D64.A D65.A D66.A R101.2 R103.2 R106.2 R108.2 ; also sheet 1,3,4,5,6,7,8,9,10,11,12,13,15,16,17,18,19,20,21,22,23,24
ADD_R3: Q93.D Q97.G R103.1 ; also sheet 15
ADD_R3_N: Q89.D Q91.D Q93.G Q95.G R101.1 R102.1 R110.1 ; also sheet 15
CRY2: Q94.G ; also sheet 13,15
CRY2_N: Q96.G R109.1 ; also sheet 13,15
GND: Q90.S Q92.S Q93.S Q95.S Q97.S Q98.S ; also sheet 1,2,3,4,5,6,7,8,9,10,11,12,13,15,16,17,18,19,20,21,22,23,24,25
IN_A3: Q92.G ; also sheet 2,3,15,25
IN_A3_N: Q90.G R105.1 ; also sheet 3,15
INV_B3: Q89.G ; also sheet 5,15
INV_B3_N: Q91.G R104.1 ; also sheet 5,15
N$49: Q89.S Q90.D
N$52: Q91.S Q92.D
N$55: D61.K(C) R102.2
N$56: D63.K(C) R105.2
N$57: D62.K(C) R104.2
N$59: Q94.S Q95.D
N$60: Q96.S Q97.D
N$63: D64.K(C) R107.2
N$66: D66.K(C) R110.2
N$67: D65.K(C) R109.2
Y3: Q98.D R108.1 ; also sheet 2,25
Y3_N: Q94.D Q96.D Q98.G R106.1 R107.1 ; also sheet 24

### Notes on the sheet
- LED
  B
- LED
  A
- LED
  Y
- LED
  B
- LED
  A
- LED
  Y
- Y | Y
- !Y | !Y
- B | B
- !B | !B
- A | A
- !A | !A
- XOR | XOR
- ADD/SUB bit 3 XORs.

## Sheet 15 of 25
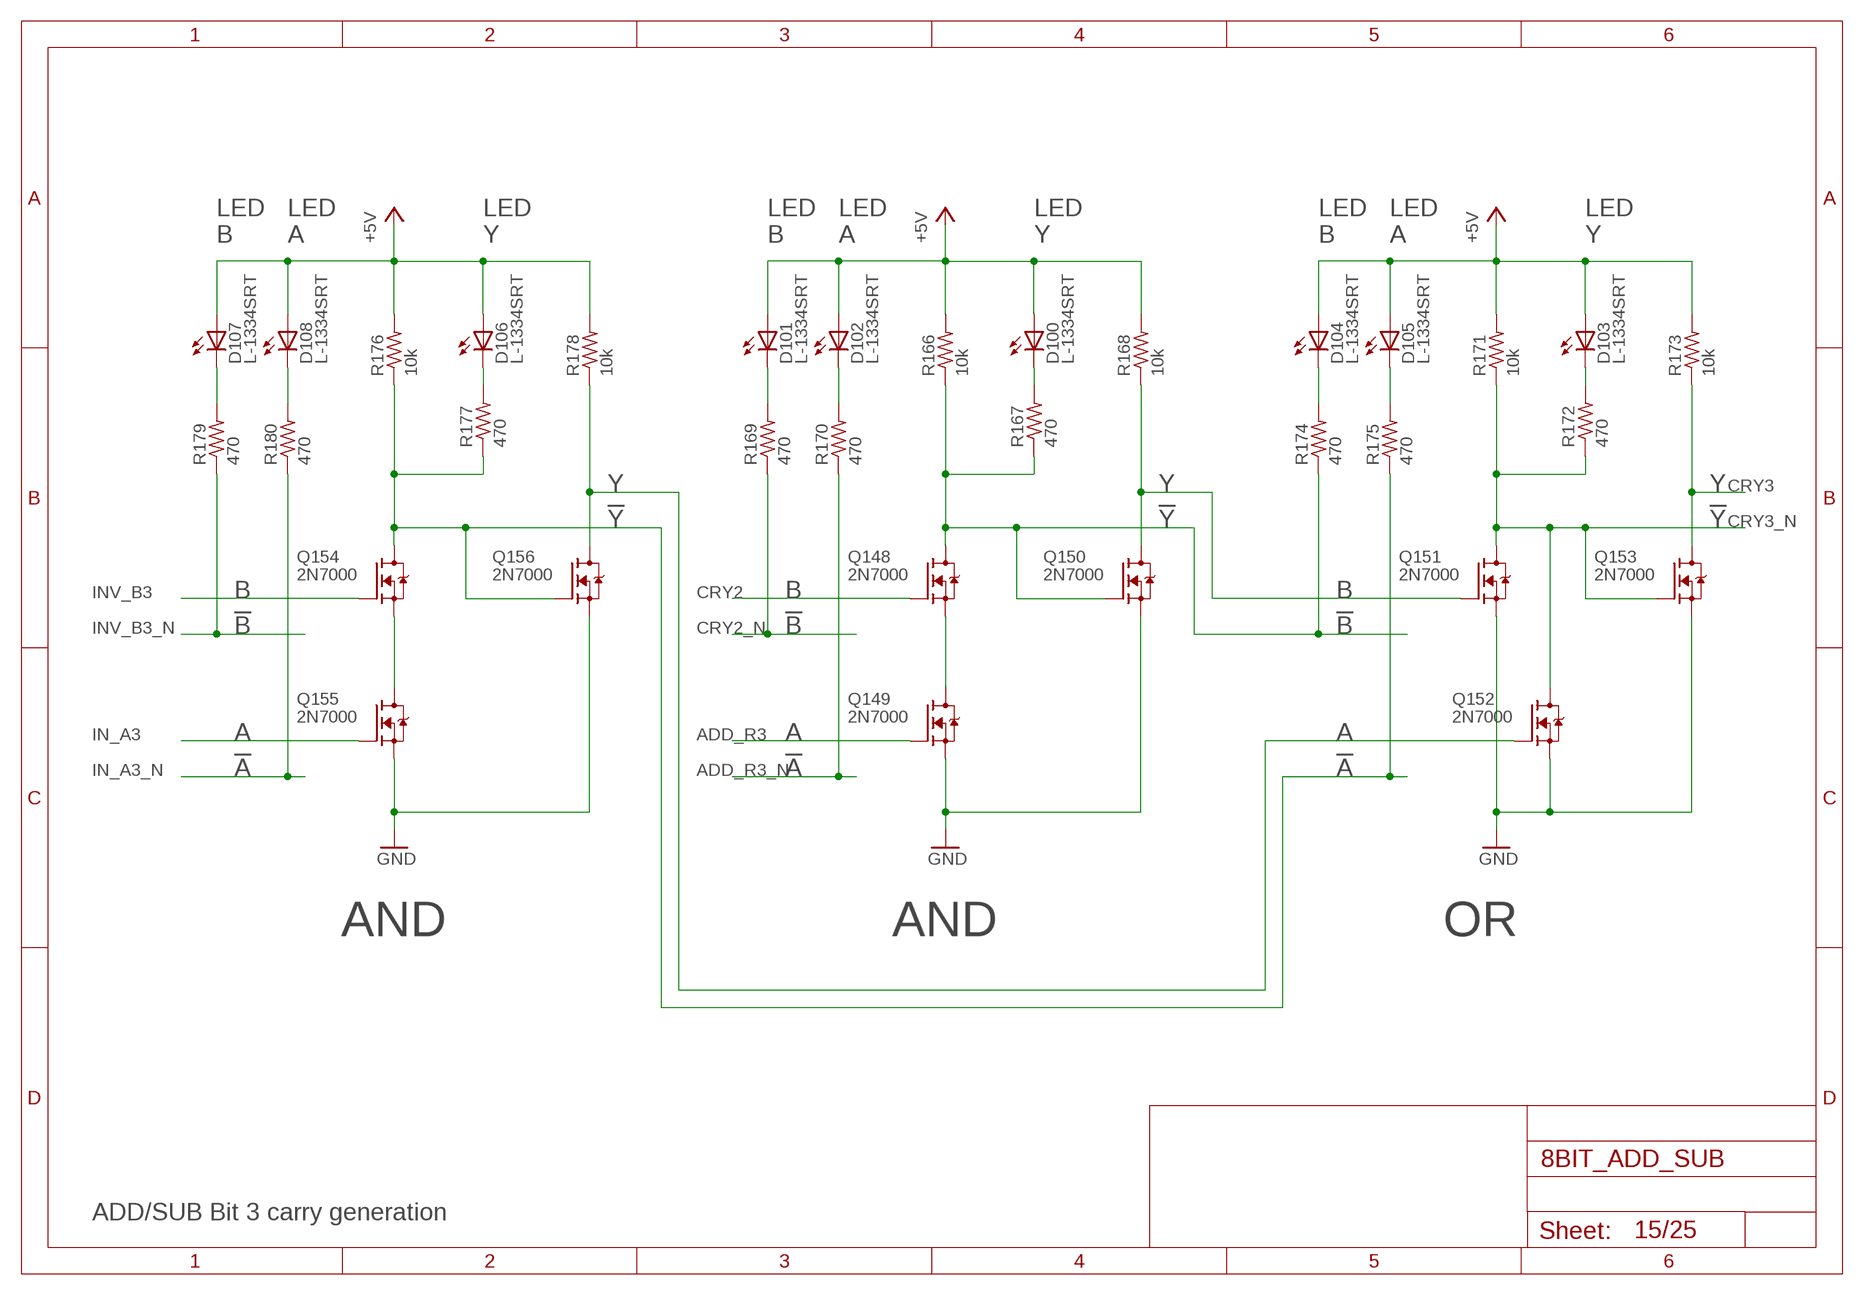
[diagram p14: schematic, sheet 15]

### Parts
D100  L-1334SRT  [LED3MM]
D101  L-1334SRT  [LED3MM]
D102  L-1334SRT  [LED3MM]
D103  L-1334SRT  [LED3MM]
D104  L-1334SRT  [LED3MM]
D105  L-1334SRT  [LED3MM]
D106  L-1334SRT  [LED3MM]
D107  L-1334SRT  [LED3MM]
D108  L-1334SRT  [LED3MM]
Q148  2N7000  [TO92-DGS]
Q149  2N7000  [TO92-DGS]
Q150  2N7000  [TO92-DGS]
Q151  2N7000  [TO92-DGS]
Q152  2N7000  [TO92-DGS]
Q153  2N7000  [TO92-DGS]
Q154  2N7000  [TO92-DGS]
Q155  2N7000  [TO92-DGS]
Q156  2N7000  [TO92-DGS]
R166  10k  R_P2INCH  [R_P2INCH]
R167  470  R_P2INCH  [R_P2INCH]
R168  10k  R_P2INCH  [R_P2INCH]
R169  470  R_P2INCH  [R_P2INCH]
R170  470  R_P2INCH  [R_P2INCH]
R171  10k  R_P2INCH  [R_P2INCH]
R172  470  R_P2INCH  [R_P2INCH]
R173  10k  R_P2INCH  [R_P2INCH]
R174  470  R_P2INCH  [R_P2INCH]
R175  470  R_P2INCH  [R_P2INCH]
R176  10k  R_P2INCH  [R_P2INCH]
R177  470  R_P2INCH  [R_P2INCH]
R178  10k  R_P2INCH  [R_P2INCH]
R179  470  R_P2INCH  [R_P2INCH]
R180  470  R_P2INCH  [R_P2INCH]

### Nets
+5V: D100.A D101.A D102.A D103.A D104.A D105.A D106.A D107.A D108.A R166.2 R168.2 R171.2 R173.2 R176.2 R178.2 ; also sheet 1,3,4,5,6,7,8,9,10,11,12,13,14,16,17,18,19,20,21,22,23,24
ADD_R3: Q149.G ; also sheet 14
ADD_R3_N: R170.1 ; also sheet 14
CRY2: Q148.G ; also sheet 13,14
CRY2_N: R169.1 ; also sheet 13,14
CRY3: Q153.D R173.1 ; also sheet 16,17
CRY3_N: Q151.D Q152.D Q153.G R171.1 R172.1 ; also sheet 16,17
GND: Q149.S Q150.S Q151.S Q152.S Q153.S Q155.S Q156.S ; also sheet 1,2,3,4,5,6,7,8,9,10,11,12,13,14,16,17,18,19,20,21,22,23,24,25
IN_A3: Q155.G ; also sheet 2,3,14,25
IN_A3_N: R180.1 ; also sheet 3,14
INV_B3: Q154.G ; also sheet 5,14
INV_B3_N: R179.1 ; also sheet 5,14
N$165: Q148.S Q149.D
N$166: D100.K(C) R167.2
N$167: Q150.D Q151.G R168.1
N$168: Q148.D Q150.G R166.1 R167.1 R174.1
N$169: D102.K(C) R170.2
N$170: D101.K(C) R169.2
N$171: D103.K(C) R172.2
N$172: D105.K(C) R175.2
N$173: D104.K(C) R174.2
N$174: Q154.S Q155.D
N$175: D106.K(C) R177.2
N$176: Q152.G Q156.D R178.1
N$177: Q154.D Q156.G R175.1 R176.1 R177.1
N$178: D108.K(C) R180.2
N$179: D107.K(C) R179.2

### Notes on the sheet
- LED
  B
- LED
  A
- LED
  Y
- LED
  B
- LED
  A
- LED
  Y
- LED
  B
- LED
  A
- LED
  Y
- Y | Y | Y
- !Y | !Y | !Y
- B | B | B
- !B | !B | !B
- A | A | A
- !A | !A | !A
- AND | AND | OR
- ADD/SUB Bit 3 carry generation

## Sheet 16 of 25
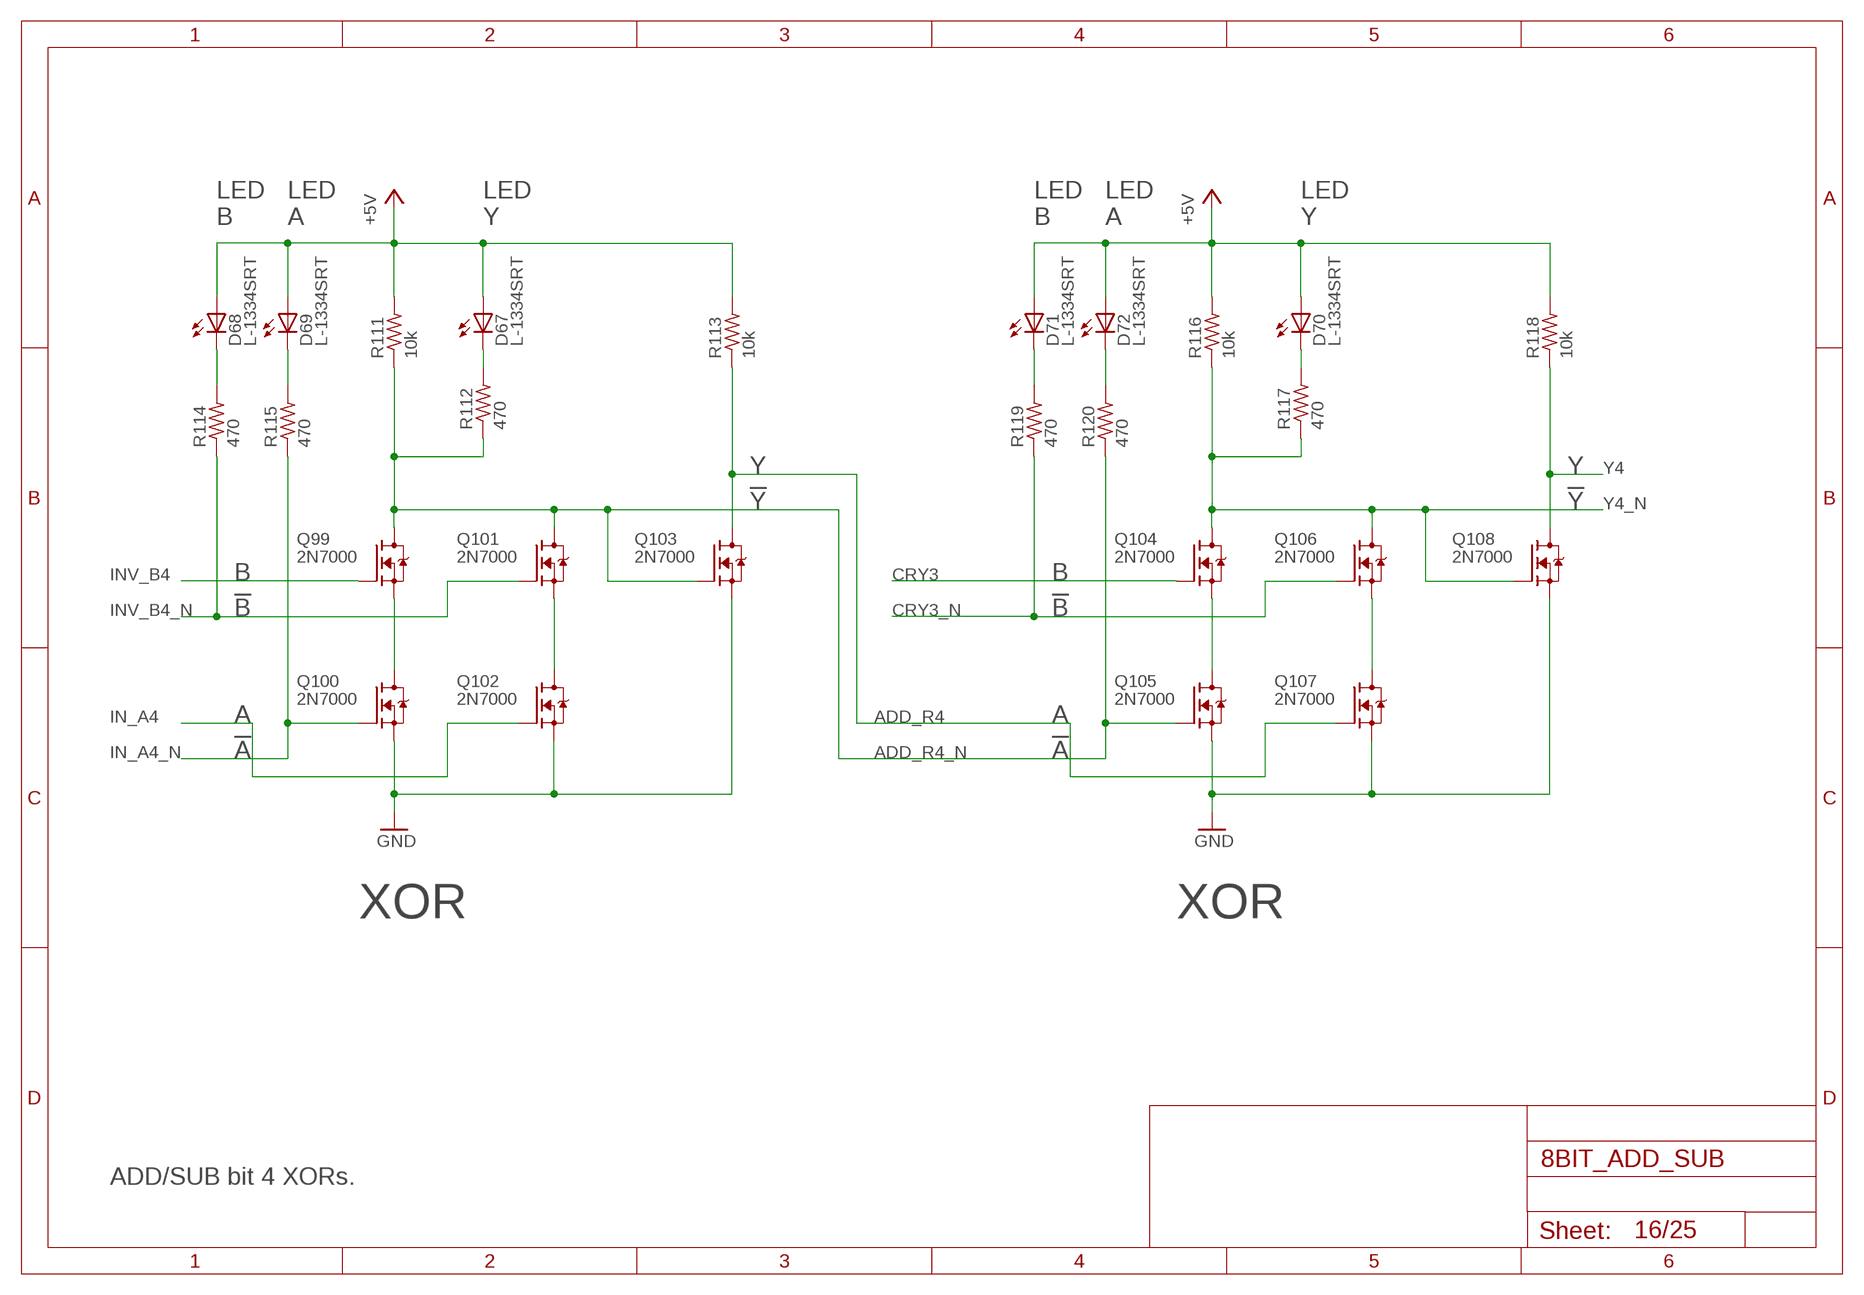
[diagram p15: schematic, sheet 16]

### Parts
D67  L-1334SRT  [LED3MM]
D68  L-1334SRT  [LED3MM]
D69  L-1334SRT  [LED3MM]
D70  L-1334SRT  [LED3MM]
D71  L-1334SRT  [LED3MM]
D72  L-1334SRT  [LED3MM]
Q99  2N7000  [TO92-DGS]
Q100  2N7000  [TO92-DGS]
Q101  2N7000  [TO92-DGS]
Q102  2N7000  [TO92-DGS]
Q103  2N7000  [TO92-DGS]
Q104  2N7000  [TO92-DGS]
Q105  2N7000  [TO92-DGS]
Q106  2N7000  [TO92-DGS]
Q107  2N7000  [TO92-DGS]
Q108  2N7000  [TO92-DGS]
R111  10k  R_P2INCH  [R_P2INCH]
R112  470  R_P2INCH  [R_P2INCH]
R113  10k  R_P2INCH  [R_P2INCH]
R114  470  R_P2INCH  [R_P2INCH]
R115  470  R_P2INCH  [R_P2INCH]
R116  10k  R_P2INCH  [R_P2INCH]
R117  470  R_P2INCH  [R_P2INCH]
R118  10k  R_P2INCH  [R_P2INCH]
R119  470  R_P2INCH  [R_P2INCH]
R120  470  R_P2INCH  [R_P2INCH]

### Nets
+5V: D67.A D68.A D69.A D70.A D71.A D72.A R111.2 R113.2 R116.2 R118.2 ; also sheet 1,3,4,5,6,7,8,9,10,11,12,13,14,15,17,18,19,20,21,22,23,24
ADD_R4: Q103.D Q107.G R113.1 ; also sheet 17
ADD_R4_N: Q99.D Q101.D Q103.G Q105.G R111.1 R112.1 R120.1 ; also sheet 17
CRY3: Q104.G ; also sheet 15,17
CRY3_N: Q106.G R119.1 ; also sheet 15,17
GND: Q100.S Q102.S Q103.S Q105.S Q107.S Q108.S ; also sheet 1,2,3,4,5,6,7,8,9,10,11,12,13,14,15,17,18,19,20,21,22,23,24,25
IN_A4: Q102.G ; also sheet 2,3,17,25
IN_A4_N: Q100.G R115.1 ; also sheet 3,17
INV_B4: Q99.G ; also sheet 6,17
INV_B4_N: Q101.G R114.1 ; also sheet 6,17
N$68: Q99.S Q100.D
N$70: Q101.S Q102.D
N$71: D67.K(C) R112.2
N$74: D69.K(C) R115.2
N$77: D68.K(C) R114.2
N$78: Q104.S Q105.D
N$79: Q106.S Q107.D
N$81: D70.K(C) R117.2
N$82: D72.K(C) R120.2
N$85: D71.K(C) R119.2
Y4: Q108.D R118.1 ; also sheet 2,25
Y4_N: Q104.D Q106.D Q108.G R116.1 R117.1 ; also sheet 24

### Notes on the sheet
- LED
  B
- LED
  A
- LED
  Y
- LED
  B
- LED
  A
- LED
  Y
- Y | Y
- !Y | !Y
- B | B
- !B | !B
- A | A
- !A | !A
- XOR | XOR
- ADD/SUB bit 4 XORs.

## Sheet 17 of 25
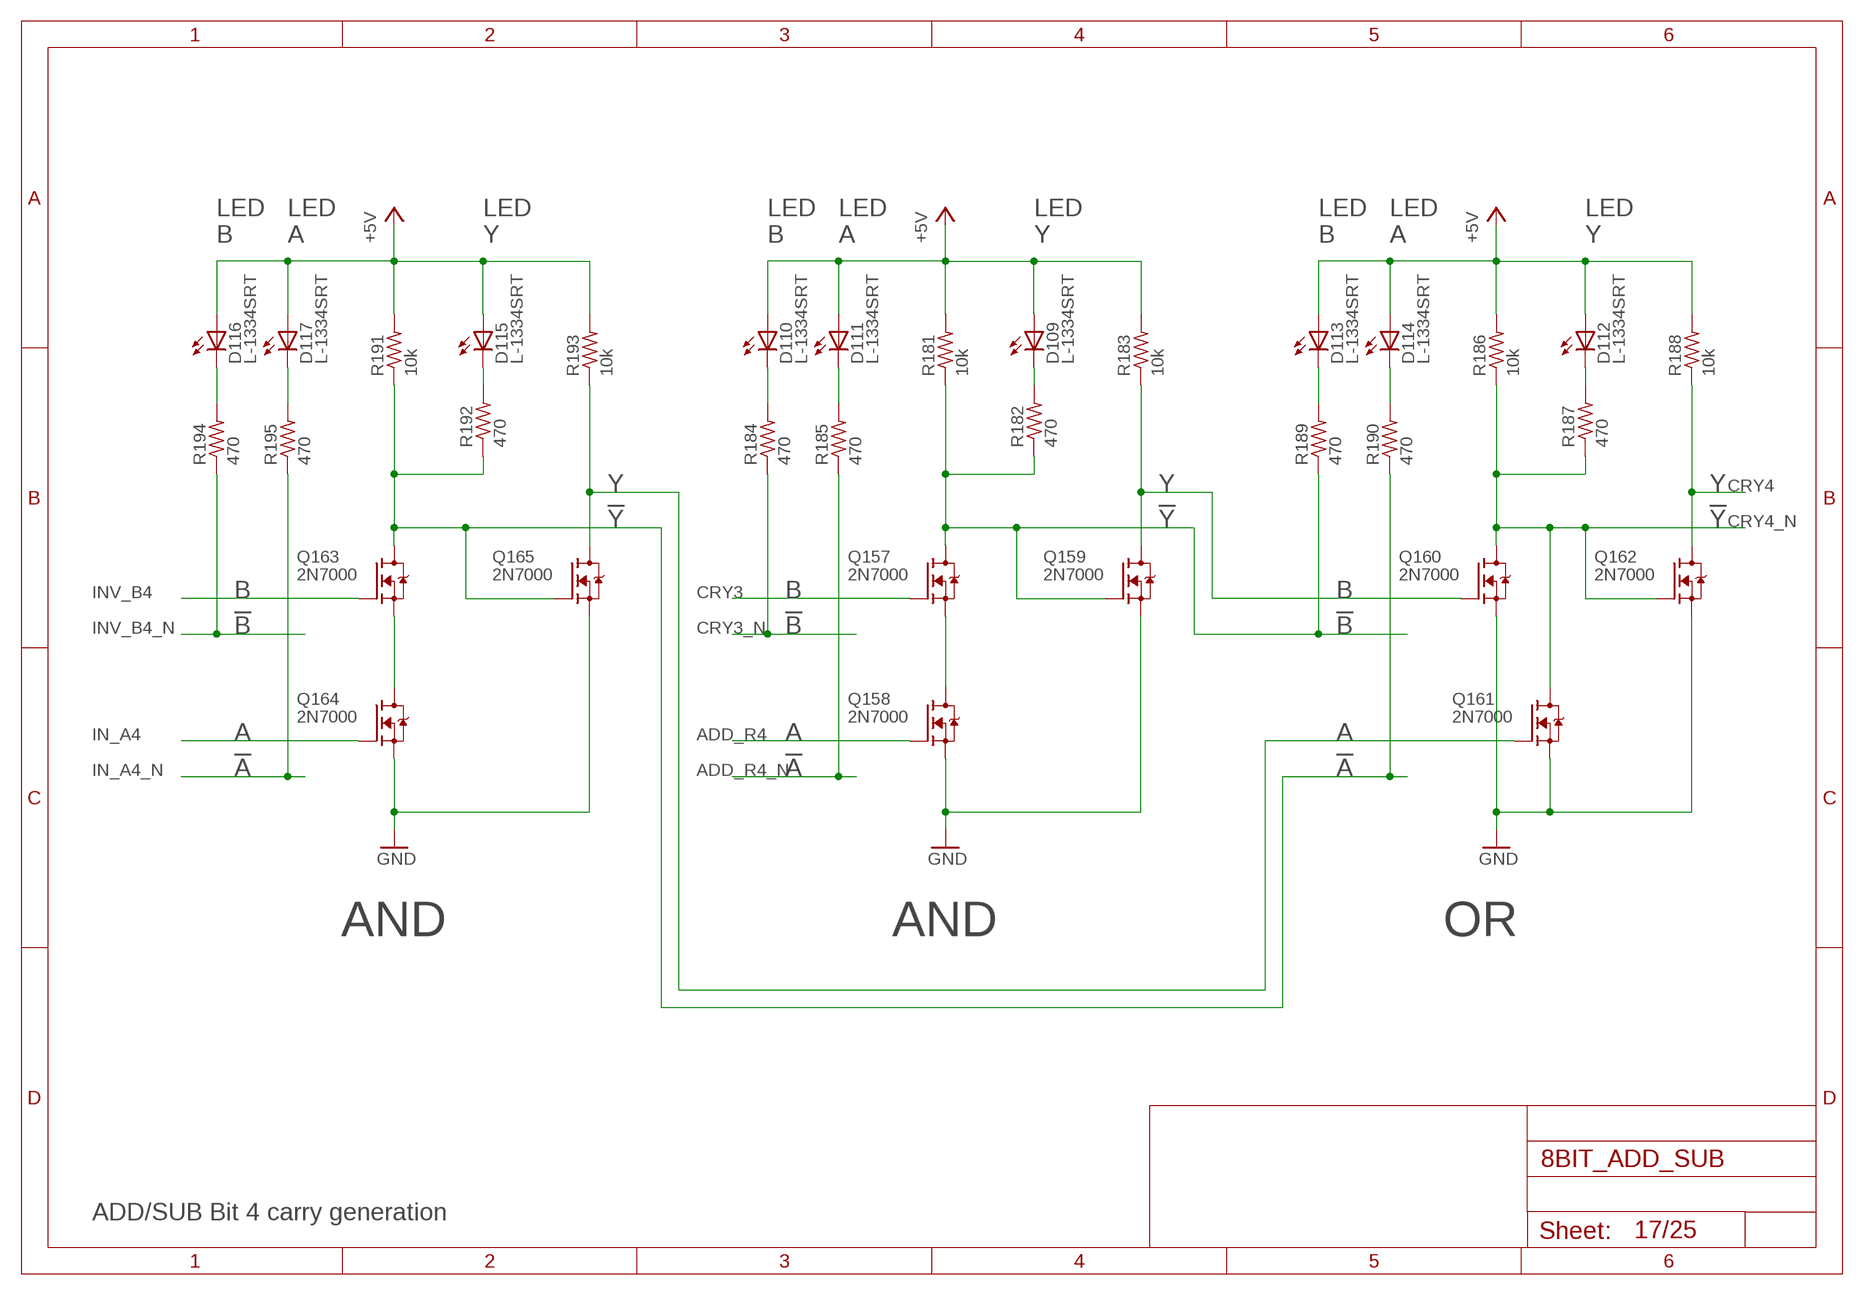
[diagram p16: schematic, sheet 17]

### Parts
D109  L-1334SRT  [LED3MM]
D110  L-1334SRT  [LED3MM]
D111  L-1334SRT  [LED3MM]
D112  L-1334SRT  [LED3MM]
D113  L-1334SRT  [LED3MM]
D114  L-1334SRT  [LED3MM]
D115  L-1334SRT  [LED3MM]
D116  L-1334SRT  [LED3MM]
D117  L-1334SRT  [LED3MM]
Q157  2N7000  [TO92-DGS]
Q158  2N7000  [TO92-DGS]
Q159  2N7000  [TO92-DGS]
Q160  2N7000  [TO92-DGS]
Q161  2N7000  [TO92-DGS]
Q162  2N7000  [TO92-DGS]
Q163  2N7000  [TO92-DGS]
Q164  2N7000  [TO92-DGS]
Q165  2N7000  [TO92-DGS]
R181  10k  R_P2INCH  [R_P2INCH]
R182  470  R_P2INCH  [R_P2INCH]
R183  10k  R_P2INCH  [R_P2INCH]
R184  470  R_P2INCH  [R_P2INCH]
R185  470  R_P2INCH  [R_P2INCH]
R186  10k  R_P2INCH  [R_P2INCH]
R187  470  R_P2INCH  [R_P2INCH]
R188  10k  R_P2INCH  [R_P2INCH]
R189  470  R_P2INCH  [R_P2INCH]
R190  470  R_P2INCH  [R_P2INCH]
R191  10k  R_P2INCH  [R_P2INCH]
R192  470  R_P2INCH  [R_P2INCH]
R193  10k  R_P2INCH  [R_P2INCH]
R194  470  R_P2INCH  [R_P2INCH]
R195  470  R_P2INCH  [R_P2INCH]

### Nets
+5V: D109.A D110.A D111.A D112.A D113.A D114.A D115.A D116.A D117.A R181.2 R183.2 R186.2 R188.2 R191.2 R193.2 ; also sheet 1,3,4,5,6,7,8,9,10,11,12,13,14,15,16,18,19,20,21,22,23,24
ADD_R4: Q158.G ; also sheet 16
ADD_R4_N: R185.1 ; also sheet 16
CRY3: Q157.G ; also sheet 15,16
CRY3_N: R184.1 ; also sheet 15,16
CRY4: Q162.D R188.1 ; also sheet 18,19
CRY4_N: Q160.D Q161.D Q162.G R186.1 R187.1 ; also sheet 18,19
GND: Q158.S Q159.S Q160.S Q161.S Q162.S Q164.S Q165.S ; also sheet 1,2,3,4,5,6,7,8,9,10,11,12,13,14,15,16,18,19,20,21,22,23,24,25
IN_A4: Q164.G ; also sheet 2,3,16,25
IN_A4_N: R195.1 ; also sheet 3,16
INV_B4: Q163.G ; also sheet 6,16
INV_B4_N: R194.1 ; also sheet 6,16
N$180: Q157.S Q158.D
N$181: D109.K(C) R182.2
N$182: Q159.D Q160.G R183.1
N$183: Q157.D Q159.G R181.1 R182.1 R189.1
N$184: D111.K(C) R185.2
N$185: D110.K(C) R184.2
N$186: D112.K(C) R187.2
N$187: D114.K(C) R190.2
N$188: D113.K(C) R189.2
N$189: Q163.S Q164.D
N$190: D115.K(C) R192.2
N$191: Q161.G Q165.D R193.1
N$192: Q163.D Q165.G R190.1 R191.1 R192.1
N$193: D117.K(C) R195.2
N$194: D116.K(C) R194.2

### Notes on the sheet
- LED
  B
- LED
  A
- LED
  Y
- LED
  B
- LED
  A
- LED
  Y
- LED
  B
- LED
  A
- LED
  Y
- Y | Y | Y
- !Y | !Y | !Y
- B | B | B
- !B | !B | !B
- A | A | A
- !A | !A | !A
- AND | AND | OR
- ADD/SUB Bit 4 carry generation

## Sheet 18 of 25
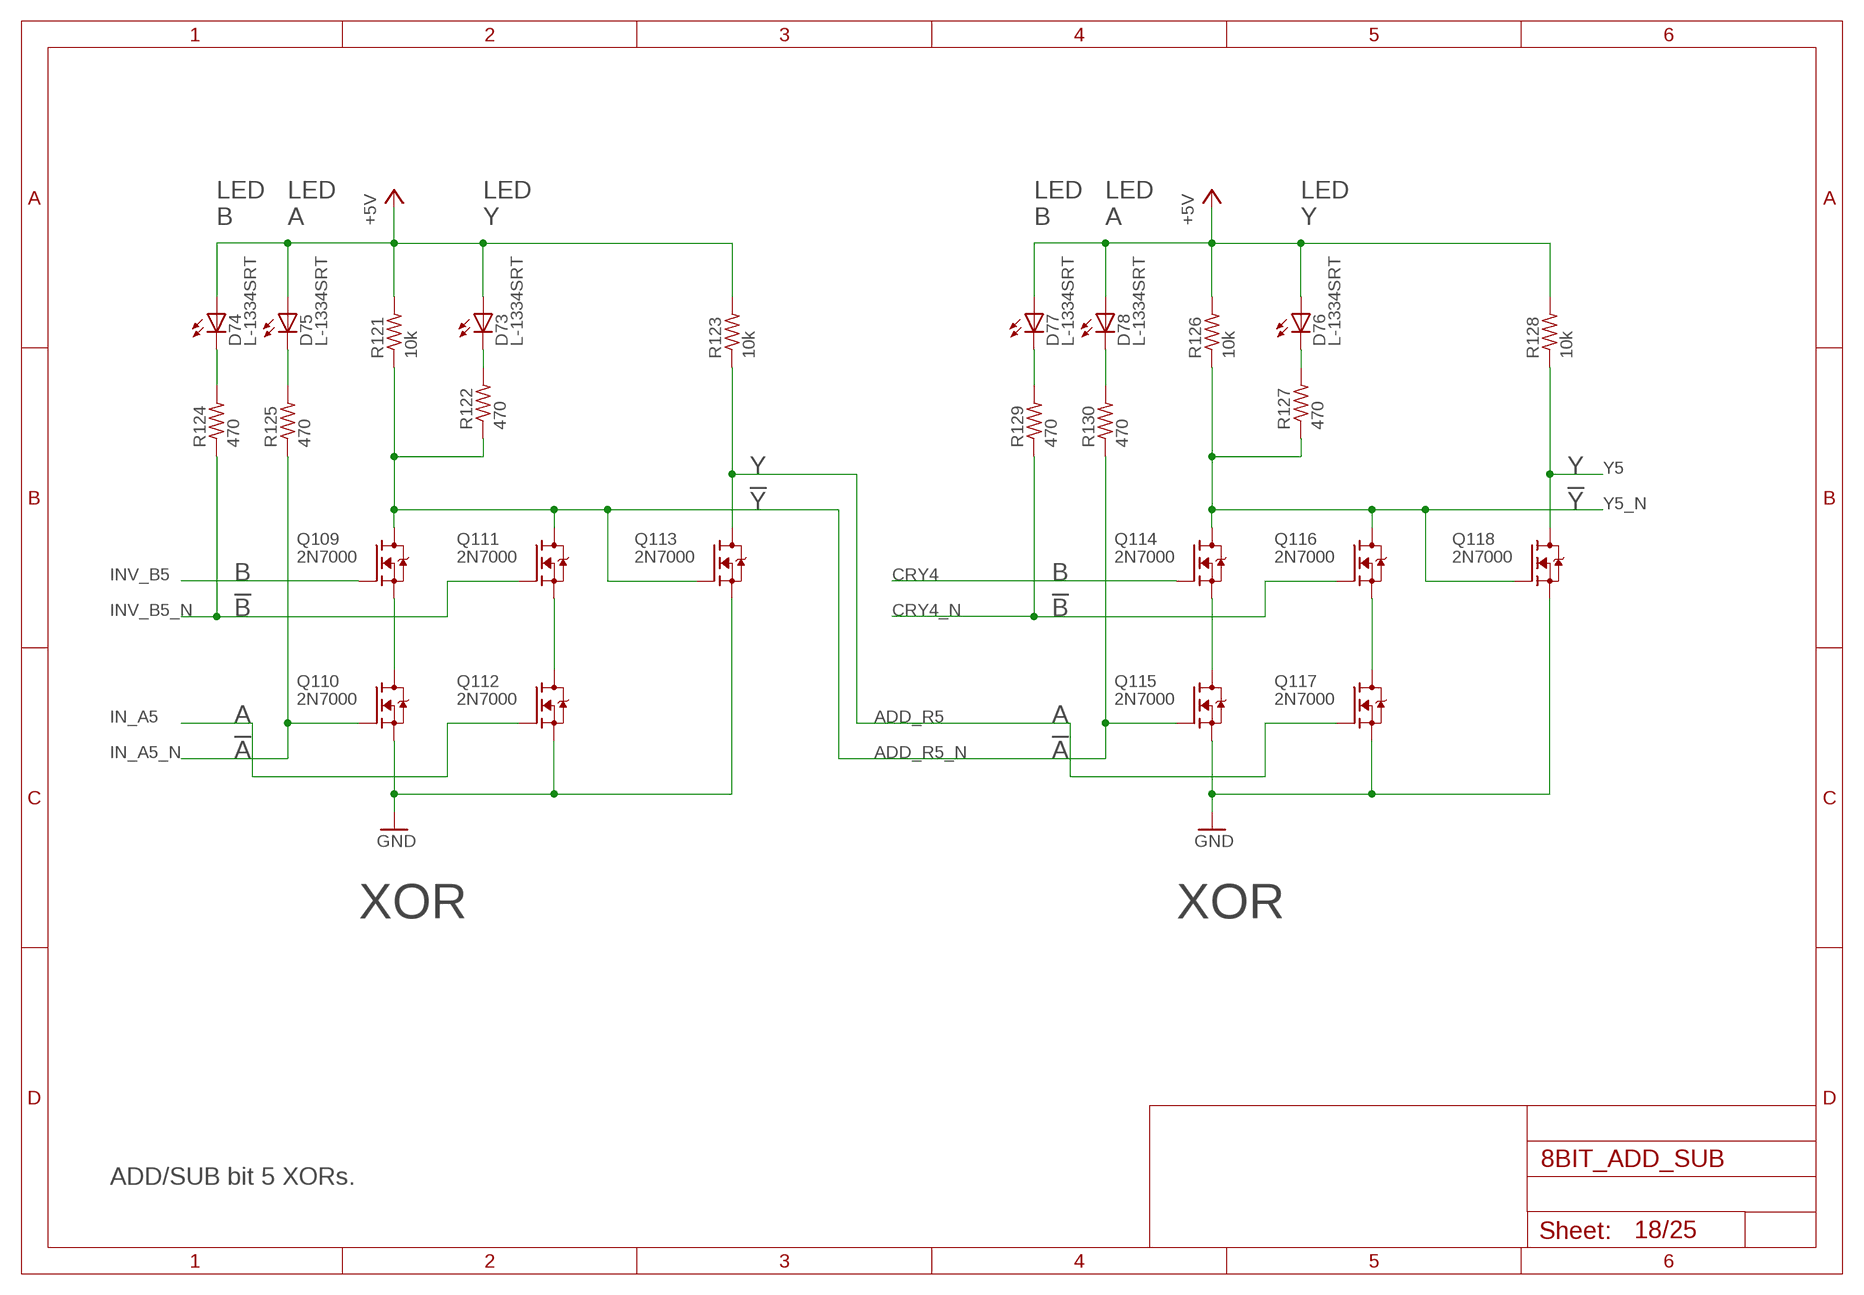
[diagram p17: schematic, sheet 18]

### Parts
D73  L-1334SRT  [LED3MM]
D74  L-1334SRT  [LED3MM]
D75  L-1334SRT  [LED3MM]
D76  L-1334SRT  [LED3MM]
D77  L-1334SRT  [LED3MM]
D78  L-1334SRT  [LED3MM]
Q109  2N7000  [TO92-DGS]
Q110  2N7000  [TO92-DGS]
Q111  2N7000  [TO92-DGS]
Q112  2N7000  [TO92-DGS]
Q113  2N7000  [TO92-DGS]
Q114  2N7000  [TO92-DGS]
Q115  2N7000  [TO92-DGS]
Q116  2N7000  [TO92-DGS]
Q117  2N7000  [TO92-DGS]
Q118  2N7000  [TO92-DGS]
R121  10k  R_P2INCH  [R_P2INCH]
R122  470  R_P2INCH  [R_P2INCH]
R123  10k  R_P2INCH  [R_P2INCH]
R124  470  R_P2INCH  [R_P2INCH]
R125  470  R_P2INCH  [R_P2INCH]
R126  10k  R_P2INCH  [R_P2INCH]
R127  470  R_P2INCH  [R_P2INCH]
R128  10k  R_P2INCH  [R_P2INCH]
R129  470  R_P2INCH  [R_P2INCH]
R130  470  R_P2INCH  [R_P2INCH]

### Nets
+5V: D73.A D74.A D75.A D76.A D77.A D78.A R121.2 R123.2 R126.2 R128.2 ; also sheet 1,3,4,5,6,7,8,9,10,11,12,13,14,15,16,17,19,20,21,22,23,24
ADD_R5: Q113.D Q117.G R123.1 ; also sheet 19
ADD_R5_N: Q109.D Q111.D Q113.G Q115.G R121.1 R122.1 R130.1 ; also sheet 19
CRY4: Q114.G ; also sheet 17,19
CRY4_N: Q116.G R129.1 ; also sheet 17,19
GND: Q110.S Q112.S Q113.S Q115.S Q117.S Q118.S ; also sheet 1,2,3,4,5,6,7,8,9,10,11,12,13,14,15,16,17,19,20,21,22,23,24,25
IN_A5: Q112.G ; also sheet 2,3,19,25
IN_A5_N: Q110.G R125.1 ; also sheet 3,19
INV_B5: Q109.G ; also sheet 6,19
INV_B5_N: Q111.G R124.1 ; also sheet 6,19
N$88: Q109.S Q110.D
N$89: Q111.S Q112.D
N$90: D73.K(C) R122.2
N$92: D75.K(C) R125.2
N$93: D74.K(C) R124.2
N$96: Q114.S Q115.D
N$98: Q116.S Q117.D
N$99: D76.K(C) R127.2
N$101: D78.K(C) R130.2
N$103: D77.K(C) R129.2
Y5: Q118.D R128.1 ; also sheet 2,25
Y5_N: Q114.D Q116.D Q118.G R126.1 R127.1 ; also sheet 24

### Notes on the sheet
- LED
  B
- LED
  A
- LED
  Y
- LED
  B
- LED
  A
- LED
  Y
- Y | Y
- !Y | !Y
- B | B
- !B | !B
- A | A
- !A | !A
- XOR | XOR
- ADD/SUB bit 5 XORs.

## Sheet 19 of 25
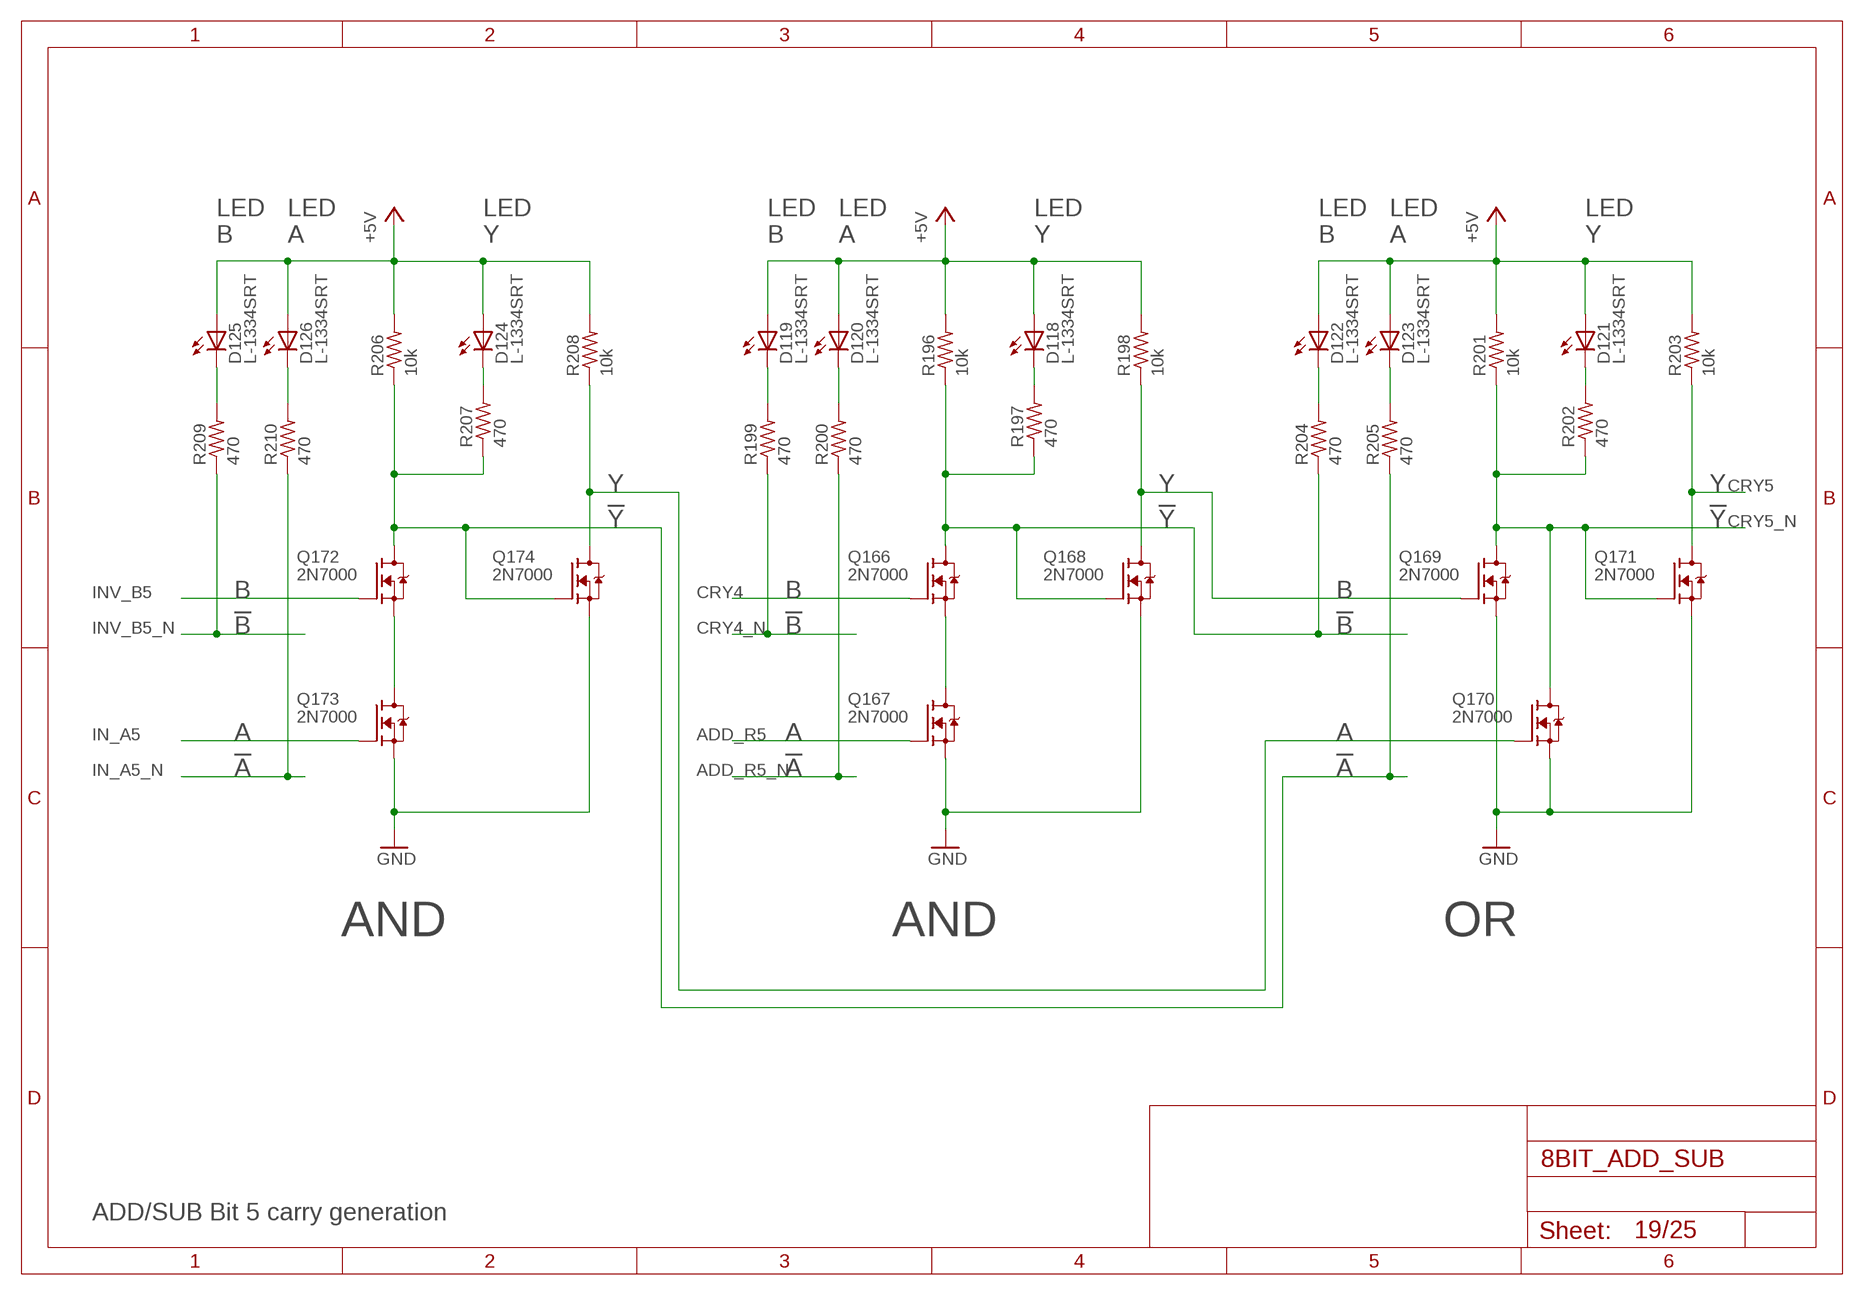
[diagram p18: schematic, sheet 19]

### Parts
D118  L-1334SRT  [LED3MM]
D119  L-1334SRT  [LED3MM]
D120  L-1334SRT  [LED3MM]
D121  L-1334SRT  [LED3MM]
D122  L-1334SRT  [LED3MM]
D123  L-1334SRT  [LED3MM]
D124  L-1334SRT  [LED3MM]
D125  L-1334SRT  [LED3MM]
D126  L-1334SRT  [LED3MM]
Q166  2N7000  [TO92-DGS]
Q167  2N7000  [TO92-DGS]
Q168  2N7000  [TO92-DGS]
Q169  2N7000  [TO92-DGS]
Q170  2N7000  [TO92-DGS]
Q171  2N7000  [TO92-DGS]
Q172  2N7000  [TO92-DGS]
Q173  2N7000  [TO92-DGS]
Q174  2N7000  [TO92-DGS]
R196  10k  R_P2INCH  [R_P2INCH]
R197  470  R_P2INCH  [R_P2INCH]
R198  10k  R_P2INCH  [R_P2INCH]
R199  470  R_P2INCH  [R_P2INCH]
R200  470  R_P2INCH  [R_P2INCH]
R201  10k  R_P2INCH  [R_P2INCH]
R202  470  R_P2INCH  [R_P2INCH]
R203  10k  R_P2INCH  [R_P2INCH]
R204  470  R_P2INCH  [R_P2INCH]
R205  470  R_P2INCH  [R_P2INCH]
R206  10k  R_P2INCH  [R_P2INCH]
R207  470  R_P2INCH  [R_P2INCH]
R208  10k  R_P2INCH  [R_P2INCH]
R209  470  R_P2INCH  [R_P2INCH]
R210  470  R_P2INCH  [R_P2INCH]

### Nets
+5V: D118.A D119.A D120.A D121.A D122.A D123.A D124.A D125.A D126.A R196.2 R198.2 R201.2 R203.2 R206.2 R208.2 ; also sheet 1,3,4,5,6,7,8,9,10,11,12,13,14,15,16,17,18,20,21,22,23,24
ADD_R5: Q167.G ; also sheet 18
ADD_R5_N: R200.1 ; also sheet 18
CRY4: Q166.G ; also sheet 17,18
CRY4_N: R199.1 ; also sheet 17,18
CRY5: Q171.D R203.1 ; also sheet 20,21
CRY5_N: Q169.D Q170.D Q171.G R201.1 R202.1 ; also sheet 20,21
GND: Q167.S Q168.S Q169.S Q170.S Q171.S Q173.S Q174.S ; also sheet 1,2,3,4,5,6,7,8,9,10,11,12,13,14,15,16,17,18,20,21,22,23,24,25
IN_A5: Q173.G ; also sheet 2,3,18,25
IN_A5_N: R210.1 ; also sheet 3,18
INV_B5: Q172.G ; also sheet 6,18
INV_B5_N: R209.1 ; also sheet 6,18
N$195: Q166.S Q167.D
N$196: D118.K(C) R197.2
N$197: Q168.D Q169.G R198.1
N$198: Q166.D Q168.G R196.1 R197.1 R204.1
N$199: D120.K(C) R200.2
N$200: D119.K(C) R199.2
N$201: D121.K(C) R202.2
N$202: D123.K(C) R205.2
N$203: D122.K(C) R204.2
N$204: Q172.S Q173.D
N$205: D124.K(C) R207.2
N$206: Q170.G Q174.D R208.1
N$207: Q172.D Q174.G R205.1 R206.1 R207.1
N$208: D126.K(C) R210.2
N$209: D125.K(C) R209.2

### Notes on the sheet
- LED
  B
- LED
  A
- LED
  Y
- LED
  B
- LED
  A
- LED
  Y
- LED
  B
- LED
  A
- LED
  Y
- Y | Y | Y
- !Y | !Y | !Y
- B | B | B
- !B | !B | !B
- A | A | A
- !A | !A | !A
- AND | AND | OR
- ADD/SUB Bit 5 carry generation

## Sheet 20 of 25
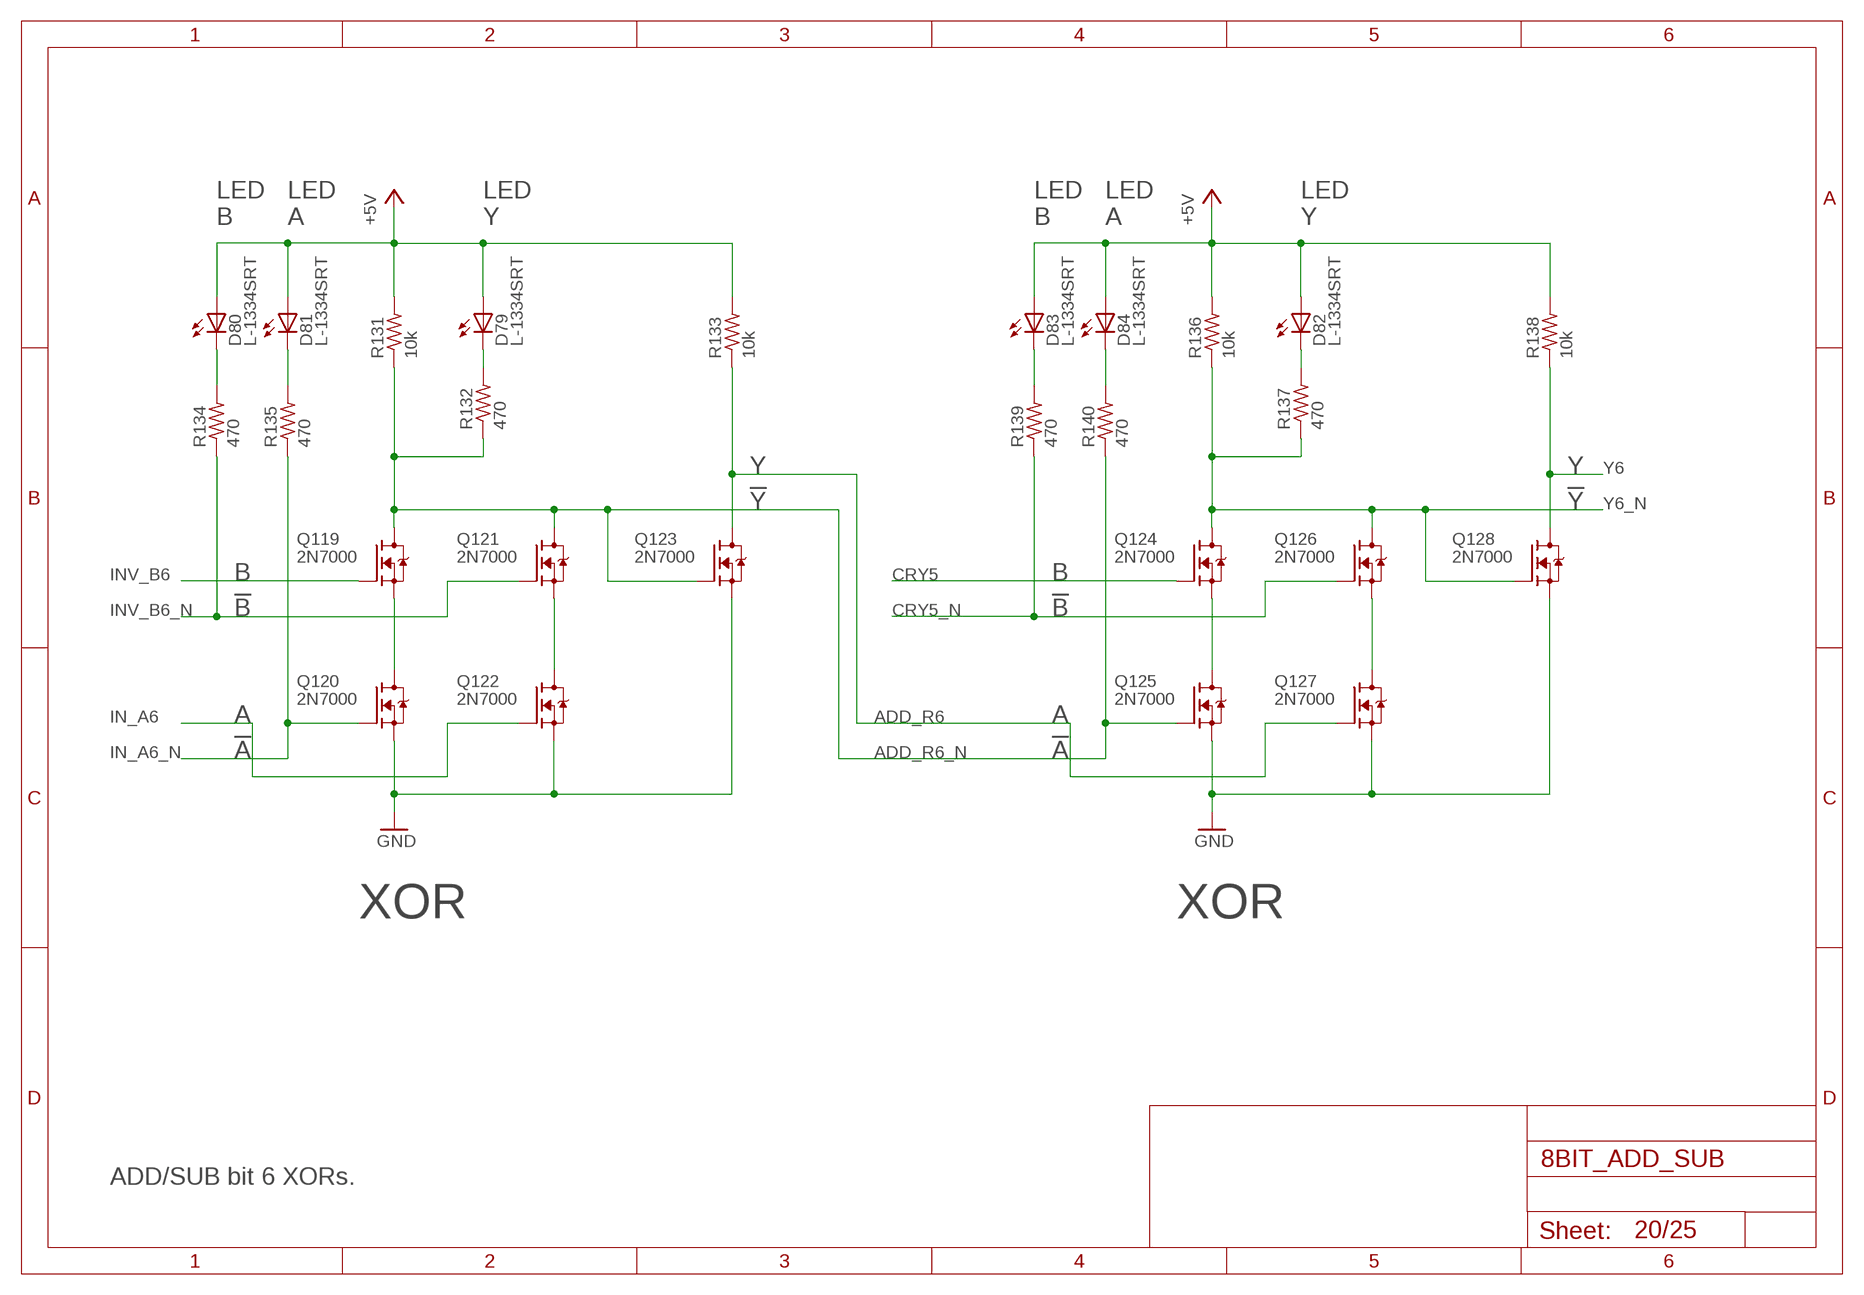
[diagram p19: schematic, sheet 20]

### Parts
D79  L-1334SRT  [LED3MM]
D80  L-1334SRT  [LED3MM]
D81  L-1334SRT  [LED3MM]
D82  L-1334SRT  [LED3MM]
D83  L-1334SRT  [LED3MM]
D84  L-1334SRT  [LED3MM]
Q119  2N7000  [TO92-DGS]
Q120  2N7000  [TO92-DGS]
Q121  2N7000  [TO92-DGS]
Q122  2N7000  [TO92-DGS]
Q123  2N7000  [TO92-DGS]
Q124  2N7000  [TO92-DGS]
Q125  2N7000  [TO92-DGS]
Q126  2N7000  [TO92-DGS]
Q127  2N7000  [TO92-DGS]
Q128  2N7000  [TO92-DGS]
R131  10k  R_P2INCH  [R_P2INCH]
R132  470  R_P2INCH  [R_P2INCH]
R133  10k  R_P2INCH  [R_P2INCH]
R134  470  R_P2INCH  [R_P2INCH]
R135  470  R_P2INCH  [R_P2INCH]
R136  10k  R_P2INCH  [R_P2INCH]
R137  470  R_P2INCH  [R_P2INCH]
R138  10k  R_P2INCH  [R_P2INCH]
R139  470  R_P2INCH  [R_P2INCH]
R140  470  R_P2INCH  [R_P2INCH]

### Nets
+5V: D79.A D80.A D81.A D82.A D83.A D84.A R131.2 R133.2 R136.2 R138.2 ; also sheet 1,3,4,5,6,7,8,9,10,11,12,13,14,15,16,17,18,19,21,22,23,24
ADD_R6: Q123.D Q127.G R133.1 ; also sheet 21
ADD_R6_N: Q119.D Q121.D Q123.G Q125.G R131.1 R132.1 R140.1 ; also sheet 21
CRY5: Q124.G ; also sheet 19,21
CRY5_N: Q126.G R139.1 ; also sheet 19,21
GND: Q120.S Q122.S Q123.S Q125.S Q127.S Q128.S ; also sheet 1,2,3,4,5,6,7,8,9,10,11,12,13,14,15,16,17,18,19,21,22,23,24,25
IN_A6: Q122.G ; also sheet 2,3,21,25
IN_A6_N: Q120.G R135.1 ; also sheet 3,21
INV_B6: Q119.G ; also sheet 7,21
INV_B6_N: Q121.G R134.1 ; also sheet 7,21
N$104: Q119.S Q120.D
N$107: Q121.S Q122.D
N$108: D79.K(C) R132.2
N$110: D81.K(C) R135.2
N$111: D80.K(C) R134.2
N$112: Q124.S Q125.D
N$113: Q126.S Q127.D
N$117: D82.K(C) R137.2
N$118: D84.K(C) R140.2
N$122: D83.K(C) R139.2
Y6: Q128.D R138.1 ; also sheet 2,25
Y6_N: Q124.D Q126.D Q128.G R136.1 R137.1 ; also sheet 24

### Notes on the sheet
- LED
  B
- LED
  A
- LED
  Y
- LED
  B
- LED
  A
- LED
  Y
- Y | Y
- !Y | !Y
- B | B
- !B | !B
- A | A
- !A | !A
- XOR | XOR
- ADD/SUB bit 6 XORs.

## Sheet 21 of 25
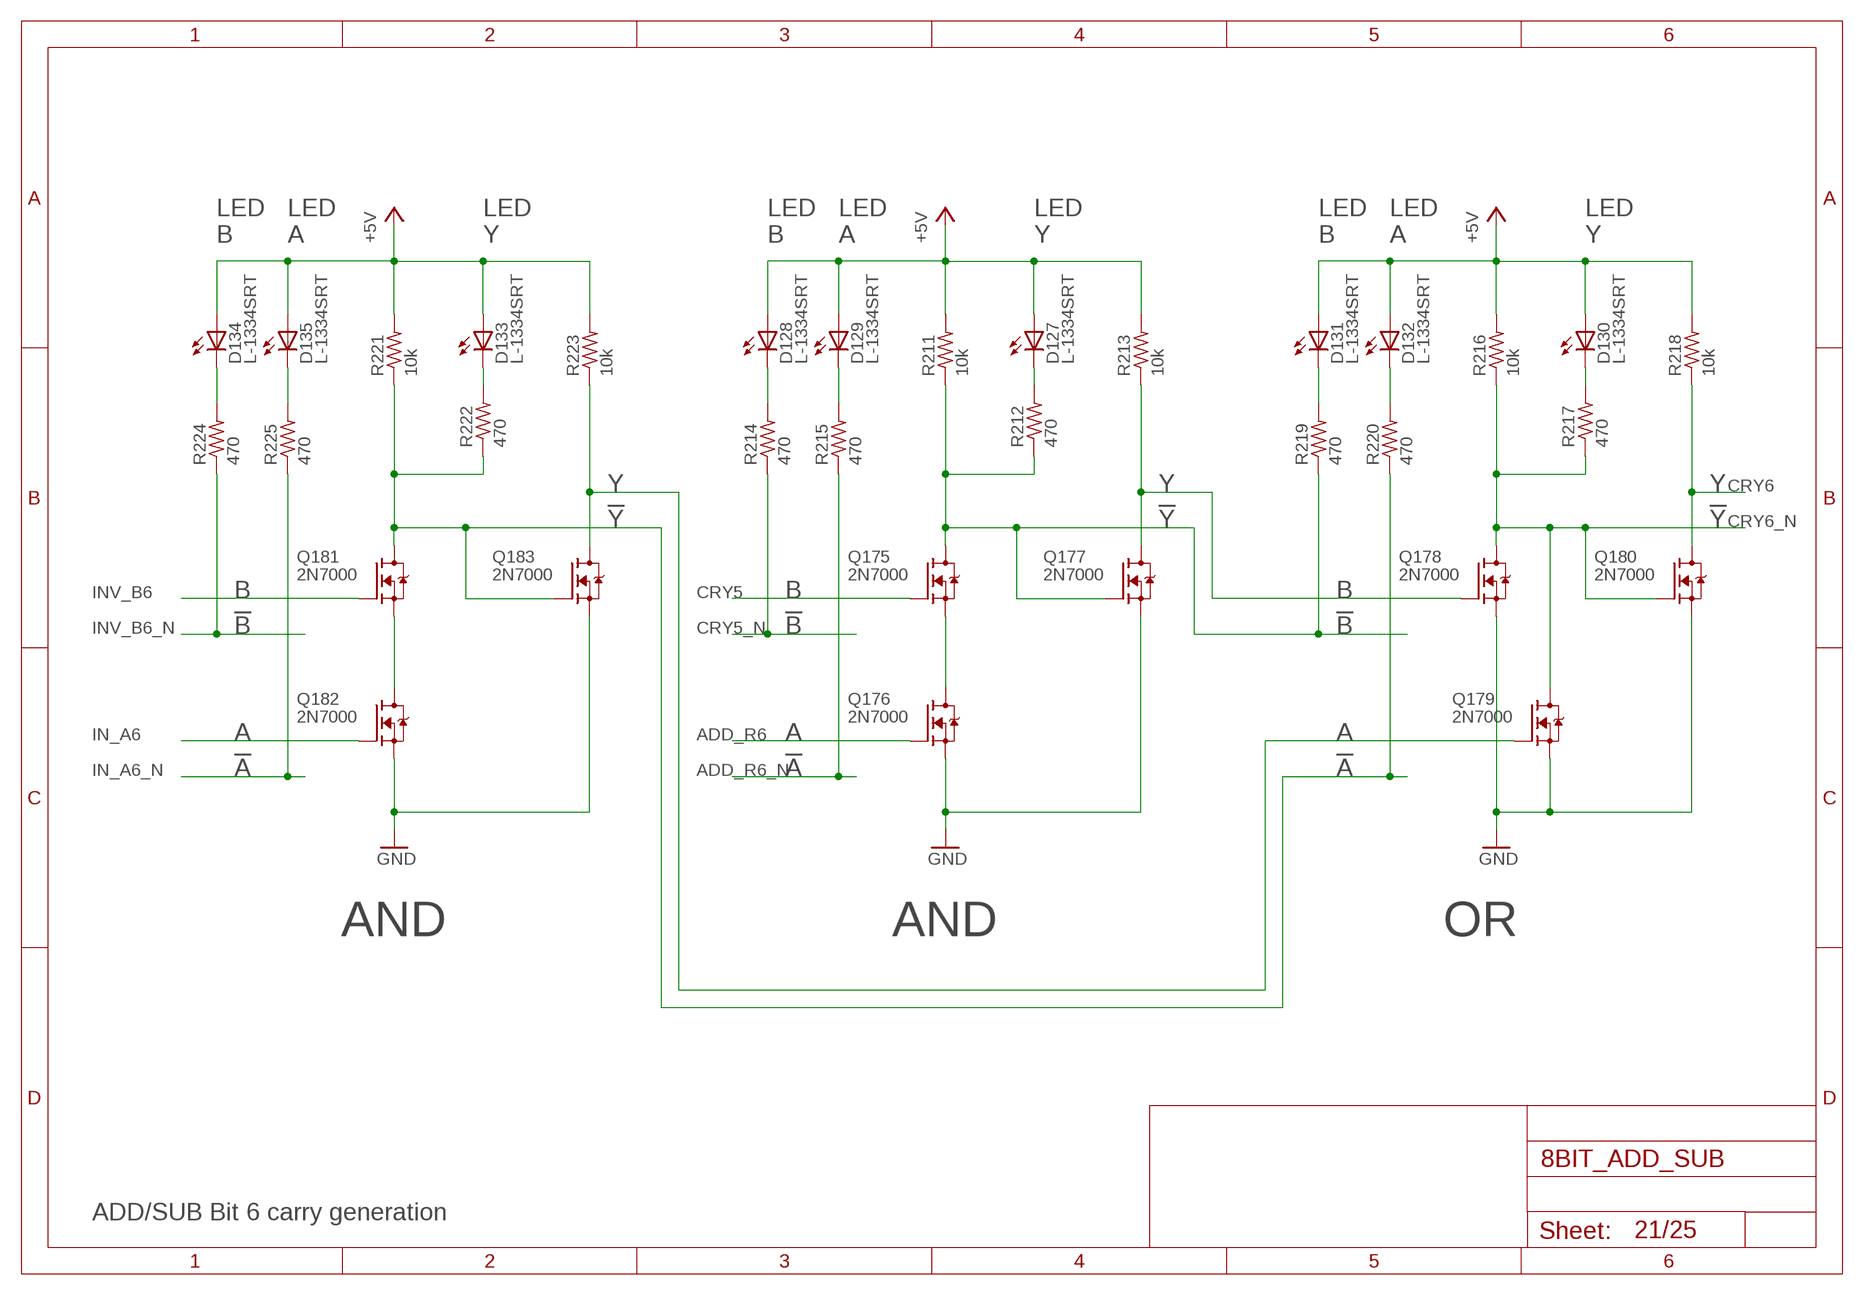
[diagram p20: schematic, sheet 21]

### Parts
D127  L-1334SRT  [LED3MM]
D128  L-1334SRT  [LED3MM]
D129  L-1334SRT  [LED3MM]
D130  L-1334SRT  [LED3MM]
D131  L-1334SRT  [LED3MM]
D132  L-1334SRT  [LED3MM]
D133  L-1334SRT  [LED3MM]
D134  L-1334SRT  [LED3MM]
D135  L-1334SRT  [LED3MM]
Q175  2N7000  [TO92-DGS]
Q176  2N7000  [TO92-DGS]
Q177  2N7000  [TO92-DGS]
Q178  2N7000  [TO92-DGS]
Q179  2N7000  [TO92-DGS]
Q180  2N7000  [TO92-DGS]
Q181  2N7000  [TO92-DGS]
Q182  2N7000  [TO92-DGS]
Q183  2N7000  [TO92-DGS]
R211  10k  R_P2INCH  [R_P2INCH]
R212  470  R_P2INCH  [R_P2INCH]
R213  10k  R_P2INCH  [R_P2INCH]
R214  470  R_P2INCH  [R_P2INCH]
R215  470  R_P2INCH  [R_P2INCH]
R216  10k  R_P2INCH  [R_P2INCH]
R217  470  R_P2INCH  [R_P2INCH]
R218  10k  R_P2INCH  [R_P2INCH]
R219  470  R_P2INCH  [R_P2INCH]
R220  470  R_P2INCH  [R_P2INCH]
R221  10k  R_P2INCH  [R_P2INCH]
R222  470  R_P2INCH  [R_P2INCH]
R223  10k  R_P2INCH  [R_P2INCH]
R224  470  R_P2INCH  [R_P2INCH]
R225  470  R_P2INCH  [R_P2INCH]

### Nets
+5V: D127.A D128.A D129.A D130.A D131.A D132.A D133.A D134.A D135.A R211.2 R213.2 R216.2 R218.2 R221.2 R223.2 ; also sheet 1,3,4,5,6,7,8,9,10,11,12,13,14,15,16,17,18,19,20,22,23,24
ADD_R6: Q176.G ; also sheet 20
ADD_R6_N: R215.1 ; also sheet 20
CRY5: Q175.G ; also sheet 19,20
CRY5_N: R214.1 ; also sheet 19,20
CRY6: Q180.D R218.1 ; also sheet 22,23
CRY6_N: Q178.D Q179.D Q180.G R216.1 R217.1 ; also sheet 22,23
GND: Q176.S Q177.S Q178.S Q179.S Q180.S Q182.S Q183.S ; also sheet 1,2,3,4,5,6,7,8,9,10,11,12,13,14,15,16,17,18,19,20,22,23,24,25
IN_A6: Q182.G ; also sheet 2,3,20,25
IN_A6_N: R225.1 ; also sheet 3,20
INV_B6: Q181.G ; also sheet 7,20
INV_B6_N: R224.1 ; also sheet 7,20
N$210: Q175.S Q176.D
N$211: D127.K(C) R212.2
N$212: Q177.D Q178.G R213.1
N$213: Q175.D Q177.G R211.1 R212.1 R219.1
N$214: D129.K(C) R215.2
N$215: D128.K(C) R214.2
N$216: D130.K(C) R217.2
N$217: D132.K(C) R220.2
N$218: D131.K(C) R219.2
N$219: Q181.S Q182.D
N$220: D133.K(C) R222.2
N$221: Q179.G Q183.D R223.1
N$222: Q181.D Q183.G R220.1 R221.1 R222.1
N$223: D135.K(C) R225.2
N$224: D134.K(C) R224.2

### Notes on the sheet
- LED
  B
- LED
  A
- LED
  Y
- LED
  B
- LED
  A
- LED
  Y
- LED
  B
- LED
  A
- LED
  Y
- Y | Y | Y
- !Y | !Y | !Y
- B | B | B
- !B | !B | !B
- A | A | A
- !A | !A | !A
- AND | AND | OR
- ADD/SUB Bit 6 carry generation

## Sheet 22 of 25
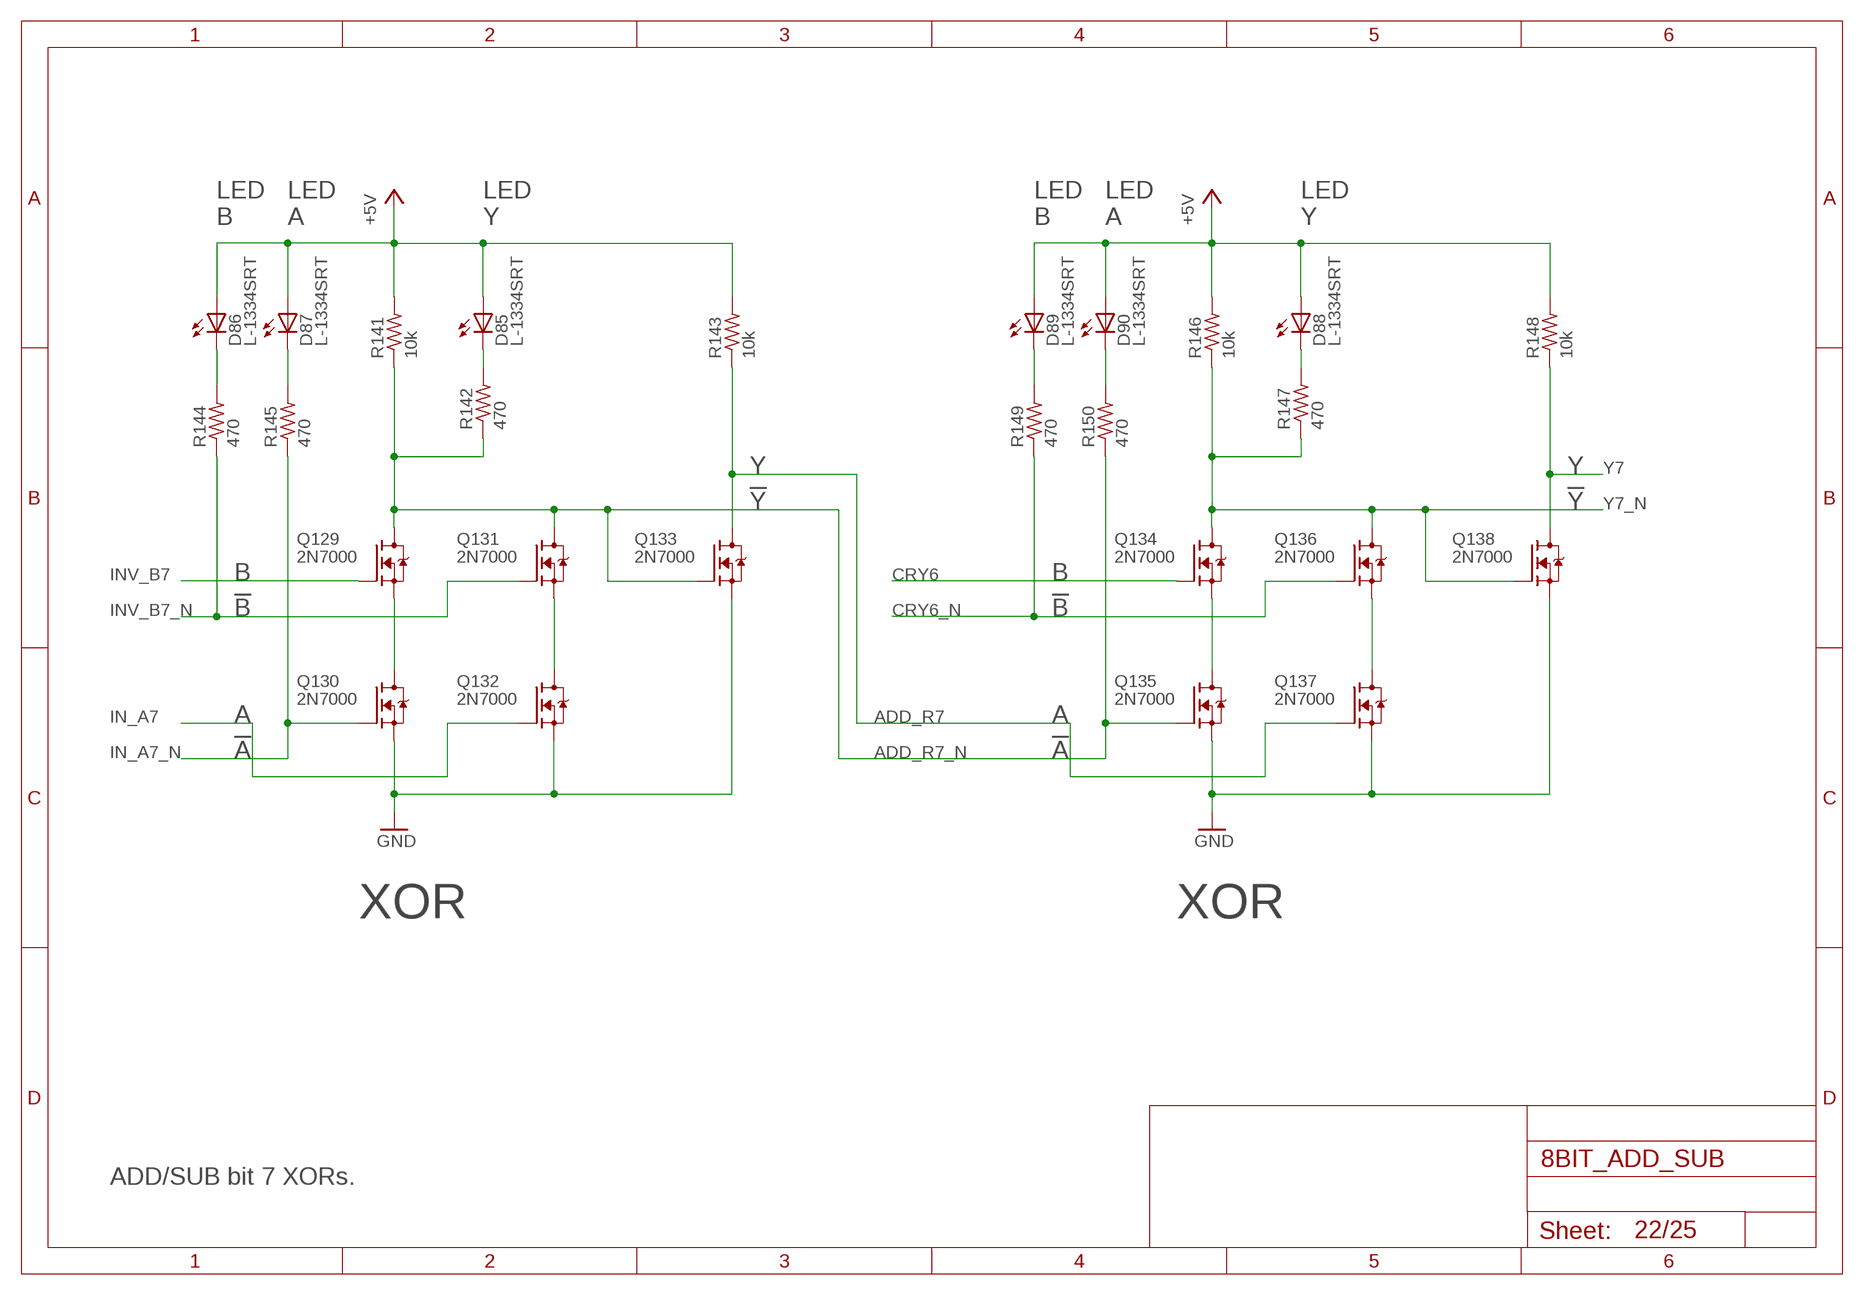
[diagram p21: schematic, sheet 22]

### Parts
D85  L-1334SRT  [LED3MM]
D86  L-1334SRT  [LED3MM]
D87  L-1334SRT  [LED3MM]
D88  L-1334SRT  [LED3MM]
D89  L-1334SRT  [LED3MM]
D90  L-1334SRT  [LED3MM]
Q129  2N7000  [TO92-DGS]
Q130  2N7000  [TO92-DGS]
Q131  2N7000  [TO92-DGS]
Q132  2N7000  [TO92-DGS]
Q133  2N7000  [TO92-DGS]
Q134  2N7000  [TO92-DGS]
Q135  2N7000  [TO92-DGS]
Q136  2N7000  [TO92-DGS]
Q137  2N7000  [TO92-DGS]
Q138  2N7000  [TO92-DGS]
R141  10k  R_P2INCH  [R_P2INCH]
R142  470  R_P2INCH  [R_P2INCH]
R143  10k  R_P2INCH  [R_P2INCH]
R144  470  R_P2INCH  [R_P2INCH]
R145  470  R_P2INCH  [R_P2INCH]
R146  10k  R_P2INCH  [R_P2INCH]
R147  470  R_P2INCH  [R_P2INCH]
R148  10k  R_P2INCH  [R_P2INCH]
R149  470  R_P2INCH  [R_P2INCH]
R150  470  R_P2INCH  [R_P2INCH]

### Nets
+5V: D85.A D86.A D87.A D88.A D89.A D90.A R141.2 R143.2 R146.2 R148.2 ; also sheet 1,3,4,5,6,7,8,9,10,11,12,13,14,15,16,17,18,19,20,21,23,24
ADD_R7: Q133.D Q137.G R143.1 ; also sheet 23
ADD_R7_N: Q129.D Q131.D Q133.G Q135.G R141.1 R142.1 R150.1 ; also sheet 23
CRY6: Q134.G ; also sheet 21,23
CRY6_N: Q136.G R149.1 ; also sheet 21,23
GND: Q130.S Q132.S Q133.S Q135.S Q137.S Q138.S ; also sheet 1,2,3,4,5,6,7,8,9,10,11,12,13,14,15,16,17,18,19,20,21,23,24,25
IN_A7: Q132.G ; also sheet 2,3,23,25
IN_A7_N: Q130.G R145.1 ; also sheet 3,23
INV_B7: Q129.G ; also sheet 7,23
INV_B7_N: Q131.G R144.1 ; also sheet 7,23
N$123: Q129.S Q130.D
N$126: Q131.S Q132.D
N$127: D85.K(C) R142.2
N$129: D87.K(C) R145.2
N$130: D86.K(C) R144.2
N$131: Q134.S Q135.D
N$132: Q136.S Q137.D
N$136: D88.K(C) R147.2
N$137: D90.K(C) R150.2
N$141: D89.K(C) R149.2
Y7: Q138.D R148.1 ; also sheet 2,25
Y7_N: Q134.D Q136.D Q138.G R146.1 R147.1 ; also sheet 24

### Notes on the sheet
- LED
  B
- LED
  A
- LED
  Y
- LED
  B
- LED
  A
- LED
  Y
- Y | Y
- !Y | !Y
- B | B
- !B | !B
- A | A
- !A | !A
- XOR | XOR
- ADD/SUB bit 7 XORs.

## Sheet 23 of 25
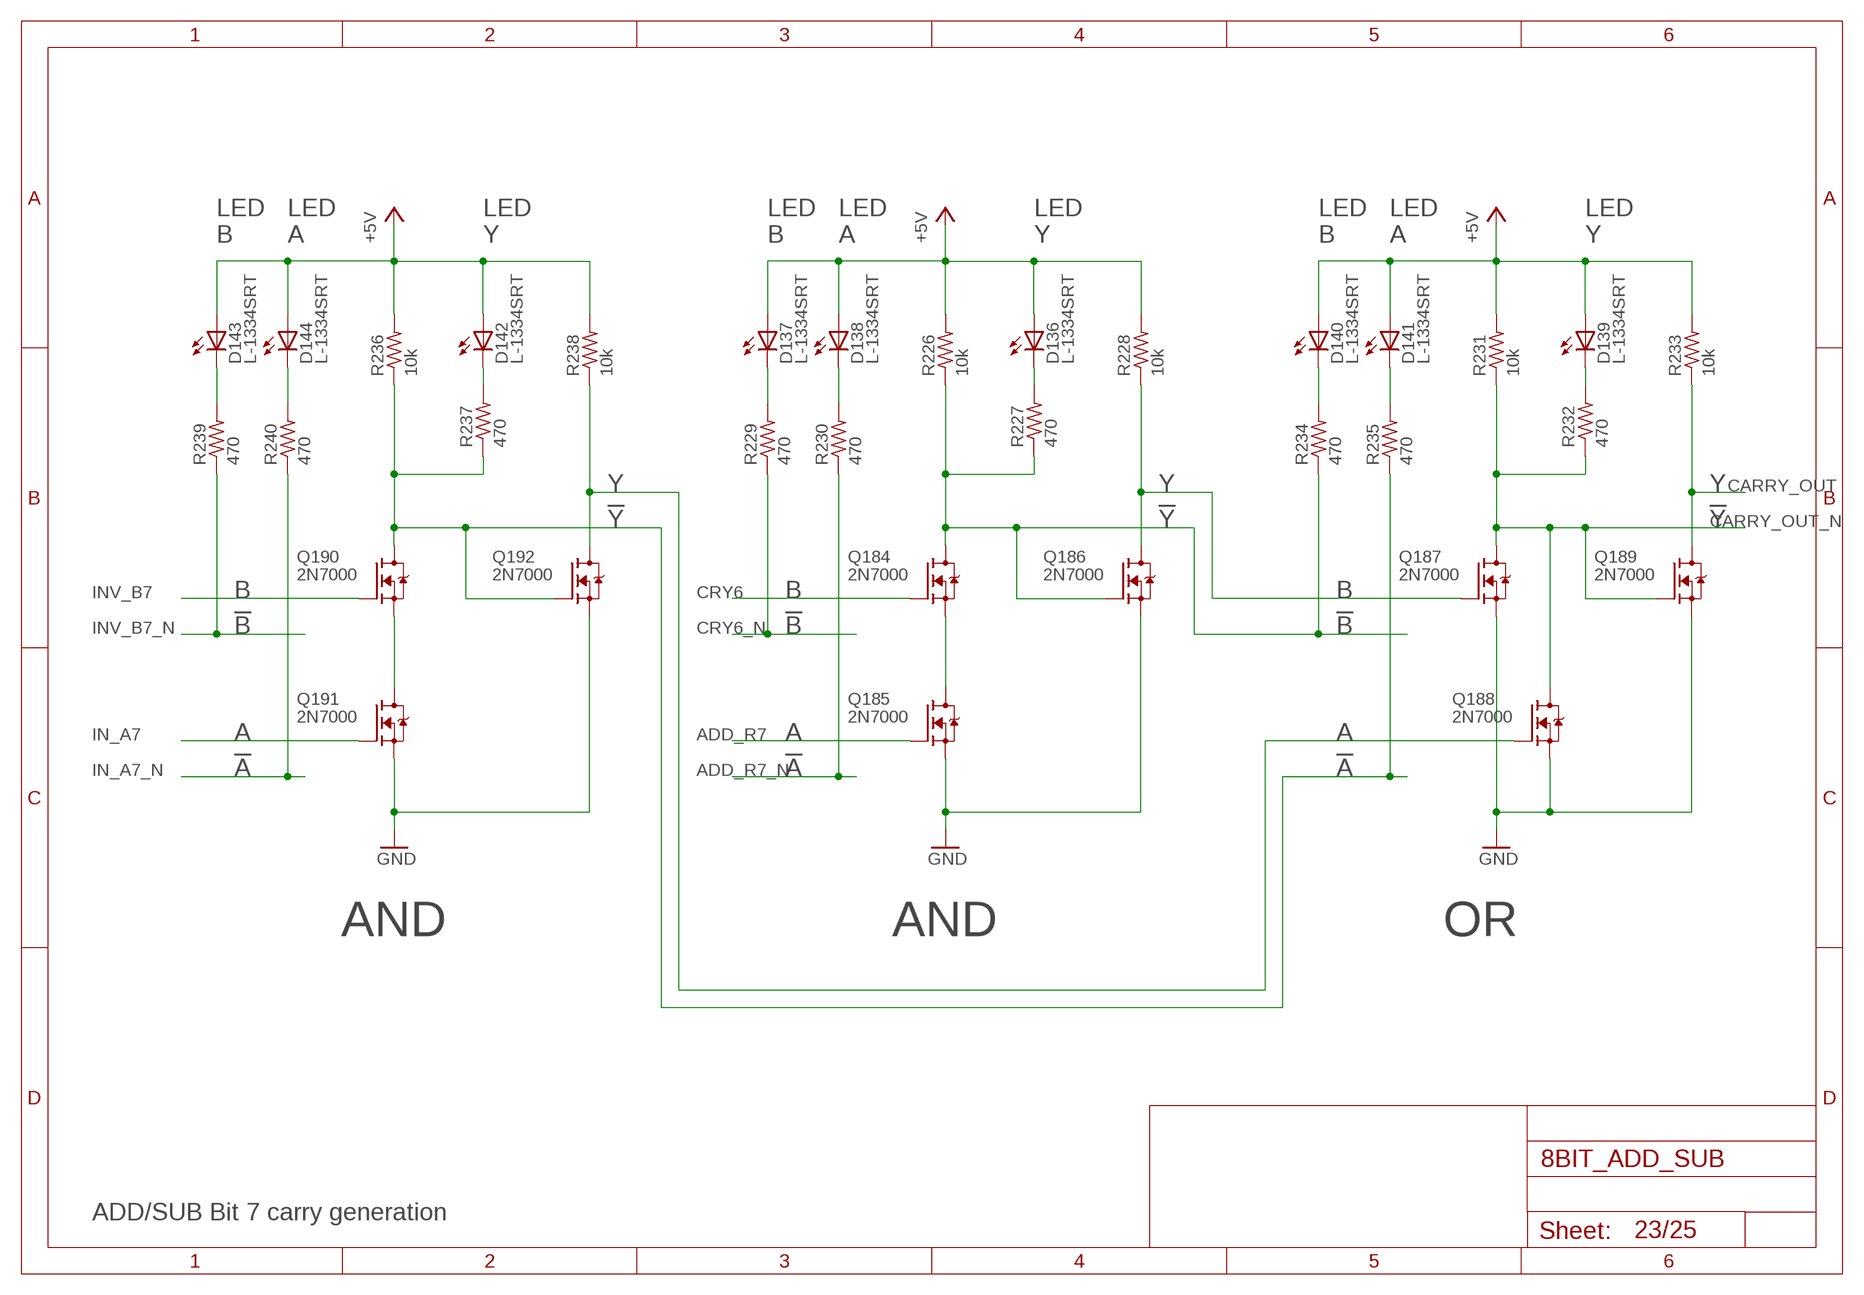
[diagram p22: schematic, sheet 23]

### Parts
D136  L-1334SRT  [LED3MM]
D137  L-1334SRT  [LED3MM]
D138  L-1334SRT  [LED3MM]
D139  L-1334SRT  [LED3MM]
D140  L-1334SRT  [LED3MM]
D141  L-1334SRT  [LED3MM]
D142  L-1334SRT  [LED3MM]
D143  L-1334SRT  [LED3MM]
D144  L-1334SRT  [LED3MM]
Q184  2N7000  [TO92-DGS]
Q185  2N7000  [TO92-DGS]
Q186  2N7000  [TO92-DGS]
Q187  2N7000  [TO92-DGS]
Q188  2N7000  [TO92-DGS]
Q189  2N7000  [TO92-DGS]
Q190  2N7000  [TO92-DGS]
Q191  2N7000  [TO92-DGS]
Q192  2N7000  [TO92-DGS]
R226  10k  R_P2INCH  [R_P2INCH]
R227  470  R_P2INCH  [R_P2INCH]
R228  10k  R_P2INCH  [R_P2INCH]
R229  470  R_P2INCH  [R_P2INCH]
R230  470  R_P2INCH  [R_P2INCH]
R231  10k  R_P2INCH  [R_P2INCH]
R232  470  R_P2INCH  [R_P2INCH]
R233  10k  R_P2INCH  [R_P2INCH]
R234  470  R_P2INCH  [R_P2INCH]
R235  470  R_P2INCH  [R_P2INCH]
R236  10k  R_P2INCH  [R_P2INCH]
R237  470  R_P2INCH  [R_P2INCH]
R238  10k  R_P2INCH  [R_P2INCH]
R239  470  R_P2INCH  [R_P2INCH]
R240  470  R_P2INCH  [R_P2INCH]

### Nets
+5V: D136.A D137.A D138.A D139.A D140.A D141.A D142.A D143.A D144.A R226.2 R228.2 R231.2 R233.2 R236.2 R238.2 ; also sheet 1,3,4,5,6,7,8,9,10,11,12,13,14,15,16,17,18,19,20,21,22,24
ADD_R7: Q185.G ; also sheet 22
ADD_R7_N: R230.1 ; also sheet 22
CARRY_OUT: Q189.D R233.1 ; also sheet 2,24
CARRY_OUT_N: Q187.D Q188.D Q189.G R231.1 R232.1
CRY6: Q184.G ; also sheet 21,22
CRY6_N: R229.1 ; also sheet 21,22
GND: Q185.S Q186.S Q187.S Q188.S Q189.S Q191.S Q192.S ; also sheet 1,2,3,4,5,6,7,8,9,10,11,12,13,14,15,16,17,18,19,20,21,22,24,25
IN_A7: Q191.G ; also sheet 2,3,22,25
IN_A7_N: R240.1 ; also sheet 3,22
INV_B7: Q190.G ; also sheet 7,22
INV_B7_N: R239.1 ; also sheet 7,22
N$225: Q184.S Q185.D
N$226: D136.K(C) R227.2
N$227: Q186.D Q187.G R228.1
N$228: Q184.D Q186.G R226.1 R227.1 R234.1
N$229: D138.K(C) R230.2
N$230: D137.K(C) R229.2
N$231: D139.K(C) R232.2
N$232: D141.K(C) R235.2
N$233: D140.K(C) R234.2
N$234: Q190.S Q191.D
N$235: D142.K(C) R237.2
N$236: Q188.G Q192.D R238.1
N$237: Q190.D Q192.G R235.1 R236.1 R237.1
N$238: D144.K(C) R240.2
N$239: D143.K(C) R239.2

### Notes on the sheet
- LED
  B
- LED
  A
- LED
  Y
- LED
  B
- LED
  A
- LED
  Y
- LED
  B
- LED
  A
- LED
  Y
- Y | Y | Y
- !Y | !Y | !Y
- B | B | B
- !B | !B | !B
- A | A | A
- !A | !A | !A
- AND | AND | OR
- ADD/SUB Bit 7 carry generation

## Sheet 24 of 25
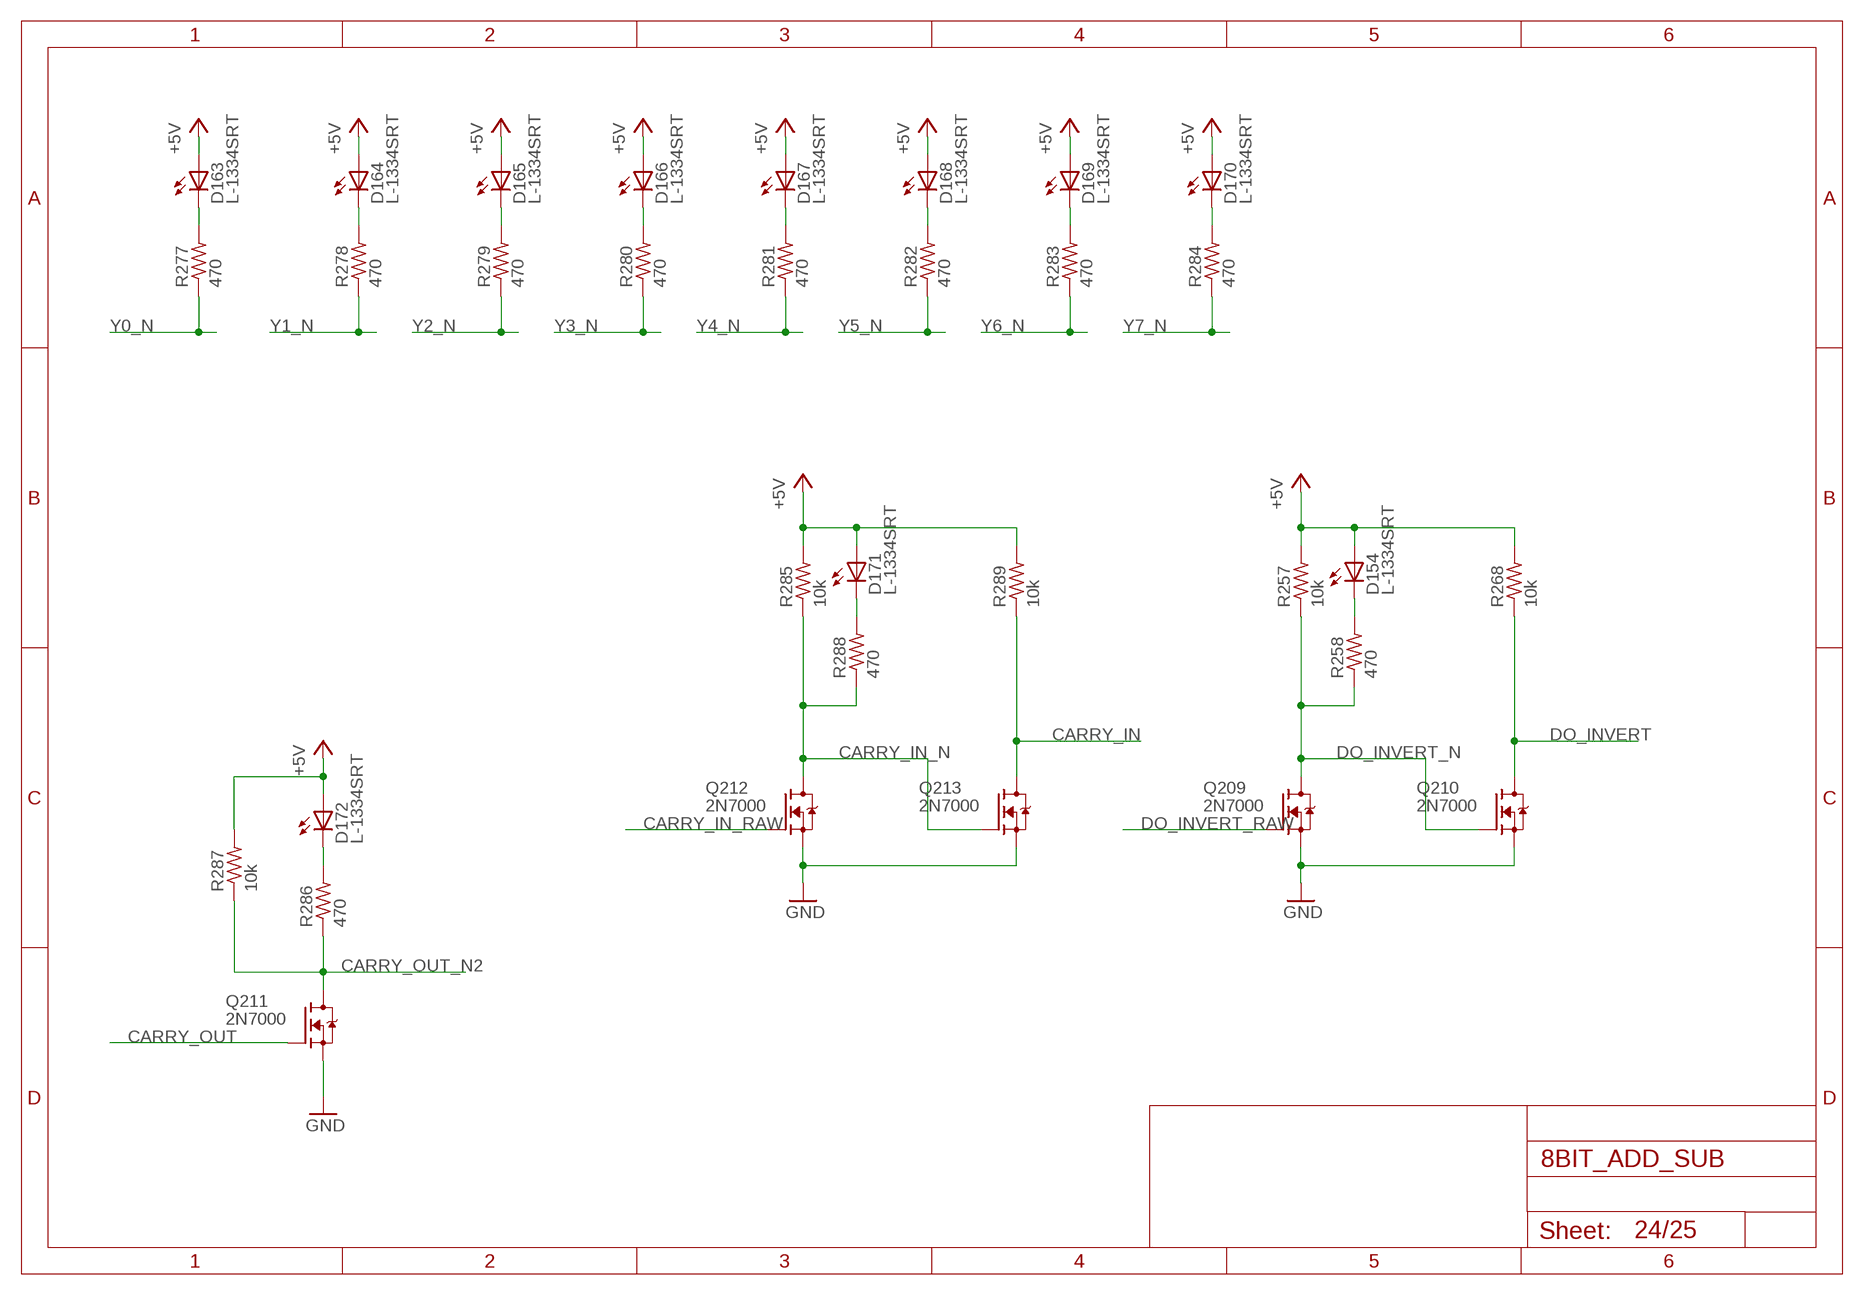
[diagram p23: schematic, sheet 24]

### Parts
D154  L-1334SRT  [LED3MM]
D163  L-1334SRT  [LED3MM]
D164  L-1334SRT  [LED3MM]
D165  L-1334SRT  [LED3MM]
D166  L-1334SRT  [LED3MM]
D167  L-1334SRT  [LED3MM]
D168  L-1334SRT  [LED3MM]
D169  L-1334SRT  [LED3MM]
D170  L-1334SRT  [LED3MM]
D171  L-1334SRT  [LED3MM]
D172  L-1334SRT  [LED3MM]
Q209  2N7000  [TO92-DGS]
Q210  2N7000  [TO92-DGS]
Q211  2N7000  [TO92-DGS]
Q212  2N7000  [TO92-DGS]
Q213  2N7000  [TO92-DGS]
R257  10k  R_P2INCH  [R_P2INCH]
R258  470  R_P2INCH  [R_P2INCH]
R268  10k  R_P2INCH  [R_P2INCH]
R277  470  R_P2INCH  [R_P2INCH]
R278  470  R_P2INCH  [R_P2INCH]
R279  470  R_P2INCH  [R_P2INCH]
R280  470  R_P2INCH  [R_P2INCH]
R281  470  R_P2INCH  [R_P2INCH]
R282  470  R_P2INCH  [R_P2INCH]
R283  470  R_P2INCH  [R_P2INCH]
R284  470  R_P2INCH  [R_P2INCH]
R285  10k  R_P2INCH  [R_P2INCH]
R286  470  R_P2INCH  [R_P2INCH]
R287  10k  R_P2INCH  [R_P2INCH]
R288  470  R_P2INCH  [R_P2INCH]
R289  10k  R_P2INCH  [R_P2INCH]

### Nets
+5V: D154.A D163.A D164.A D165.A D166.A D167.A D168.A D169.A D170.A D171.A D172.A R257.2 R268.2 R285.2 R287.2 R289.2 ; also sheet 1,3,4,5,6,7,8,9,10,11,12,13,14,15,16,17,18,19,20,21,22,23
CARRY_IN: Q213.D R289.1 ; also sheet 8,9
CARRY_IN_N: Q212.D Q213.G R285.1 R288.1 ; also sheet 8,9
CARRY_IN_RAW: Q212.G ; also sheet 2
CARRY_OUT: Q211.G ; also sheet 2,23
CARRY_OUT_N2: Q211.D R286.1 R287.1
DO_INVERT: Q210.D R268.1 ; also sheet 4,5,6,7
DO_INVERT_N: Q209.D Q210.G R257.1 R258.1 ; also sheet 4,5,6,7
DO_INVERT_RAW: Q209.G ; also sheet 2
GND: Q209.S Q210.S Q211.S Q212.S Q213.S ; also sheet 1,2,3,4,5,6,7,8,9,10,11,12,13,14,15,16,17,18,19,20,21,22,23,25
N$249: D154.K(C) R258.2
N$258: D163.K(C) R277.2
N$259: D171.K(C) R288.2
N$260: D164.K(C) R278.2
N$261: D165.K(C) R279.2
N$262: D166.K(C) R280.2
N$263: D167.K(C) R281.2
N$264: D168.K(C) R282.2
N$265: D169.K(C) R283.2
N$266: D170.K(C) R284.2
N$314: D172.K(C) R286.2
Y0_N: R277.1 ; also sheet 8
Y1_N: R278.1 ; also sheet 10
Y2_N: R279.1 ; also sheet 12
Y3_N: R280.1 ; also sheet 14
Y4_N: R281.1 ; also sheet 16
Y5_N: R282.1 ; also sheet 18
Y6_N: R283.1 ; also sheet 20
Y7_N: R284.1 ; also sheet 22